# EAGLE schematic foxbms_bms-master_basic_v1.00 (EAGLE 6.5.0), part 1 of 2
AUTHOR: Fraunhofer IISB foxBMS Team; REL-DATE: 2016-05-20; TITLE: foxBMS BMS-Master Basic; VERSION: 1.00

## Sheet 1 of 22: Overview
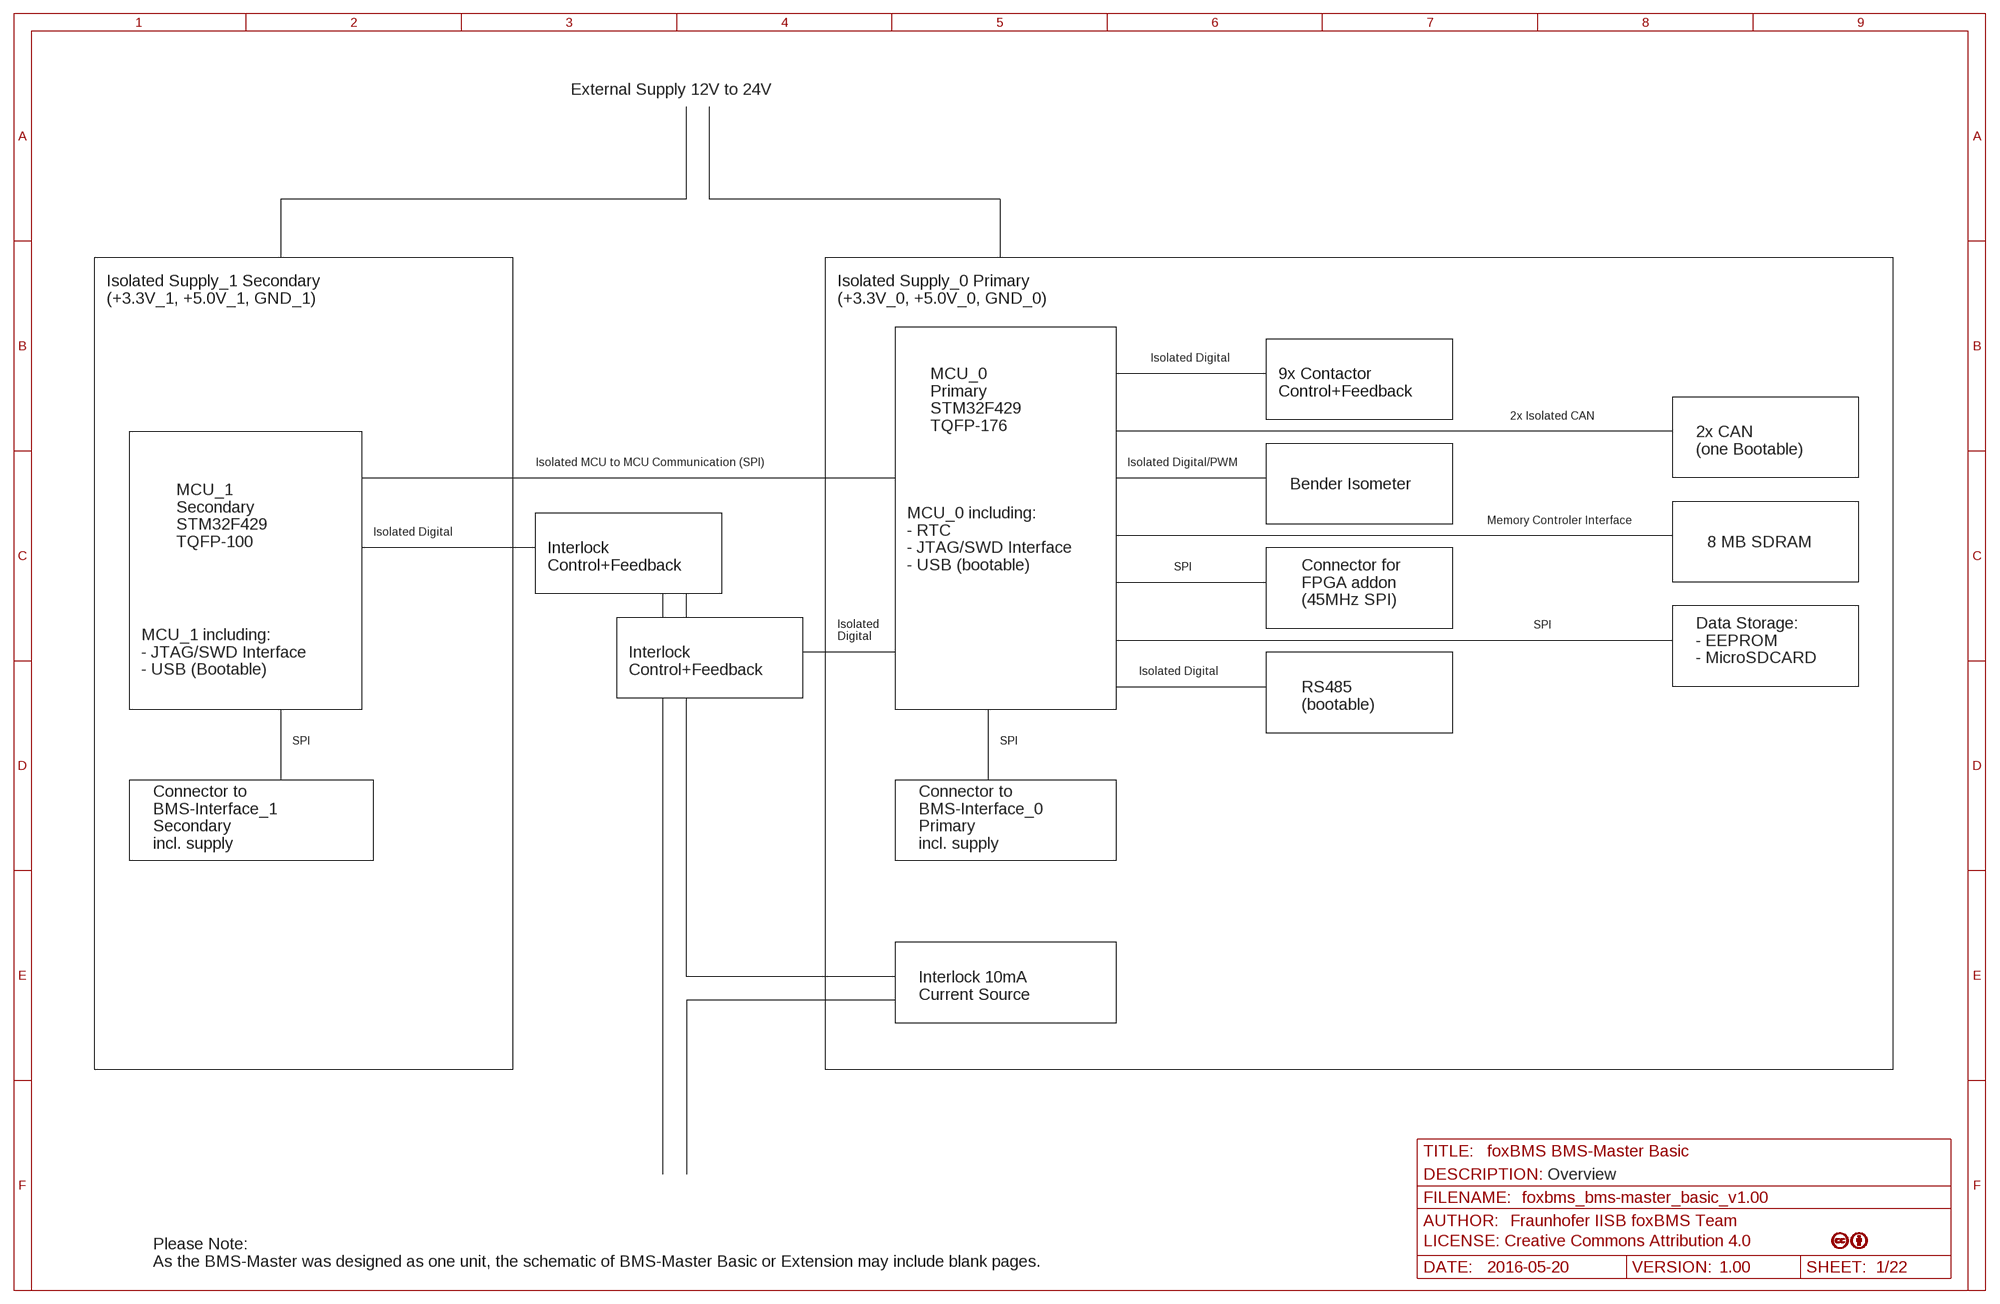
[diagram p0: schematic, sheet 1]

### Notes on the sheet
- External Supply 12V to 24V
- Isolated Supply_1 Secondary
  (+3.3V_1, +5.0V_1, GND_1)
- Isolated Supply_0 Primary
  (+3.3V_0, +5.0V_0, GND_0)
- Isolated Digital
- 9x Contactor
  Control+Feedback
- 2x Isolated CAN
- MCU_0
  Primary
  STM32F429 
  TQFP-176
- 2x CAN
  (one Bootable)
- Isolated MCU to MCU Communication (SPI) | Isolated Digital/PWM
- Bender Isometer
- Memory Controler Interface
- Isolated Digital
- MCU_1
  Secondary
  STM32F429 
  TQFP-100
- 8 MB SDRAM
- Interlock
  Control+Feedback
- MCU_0 including:
  - RTC
  - JTAG/SWD Interface
  - USB (bootable)
- SPI
- Connector for 
  FPGA addon
  (45MHz SPI)
- SPI
- Isolated 
  Digital
- Data Storage:
  - EEPROM
  - MicroSDCARD
- MCU_1 including:
  - JTAG/SWD Interface
  - USB (Bootable)
- Interlock
  Control+Feedback
- Isolated Digital
- RS485
  (bootable)
- SPI | SPI
- Connector to 
  BMS-Interface_1 
  Secondary
  incl. supply
- Connector to 
  BMS-Interface_0
  Primary
  incl. supply
- Interlock 10mA
  Current Source
- Overview
- Please Note:
  As the BMS-Master was designed as one unit, the schematic of BMS-Master Basic or Extension may include blank pages.

## Sheet 2 of 22: Supply_0 (Primary)
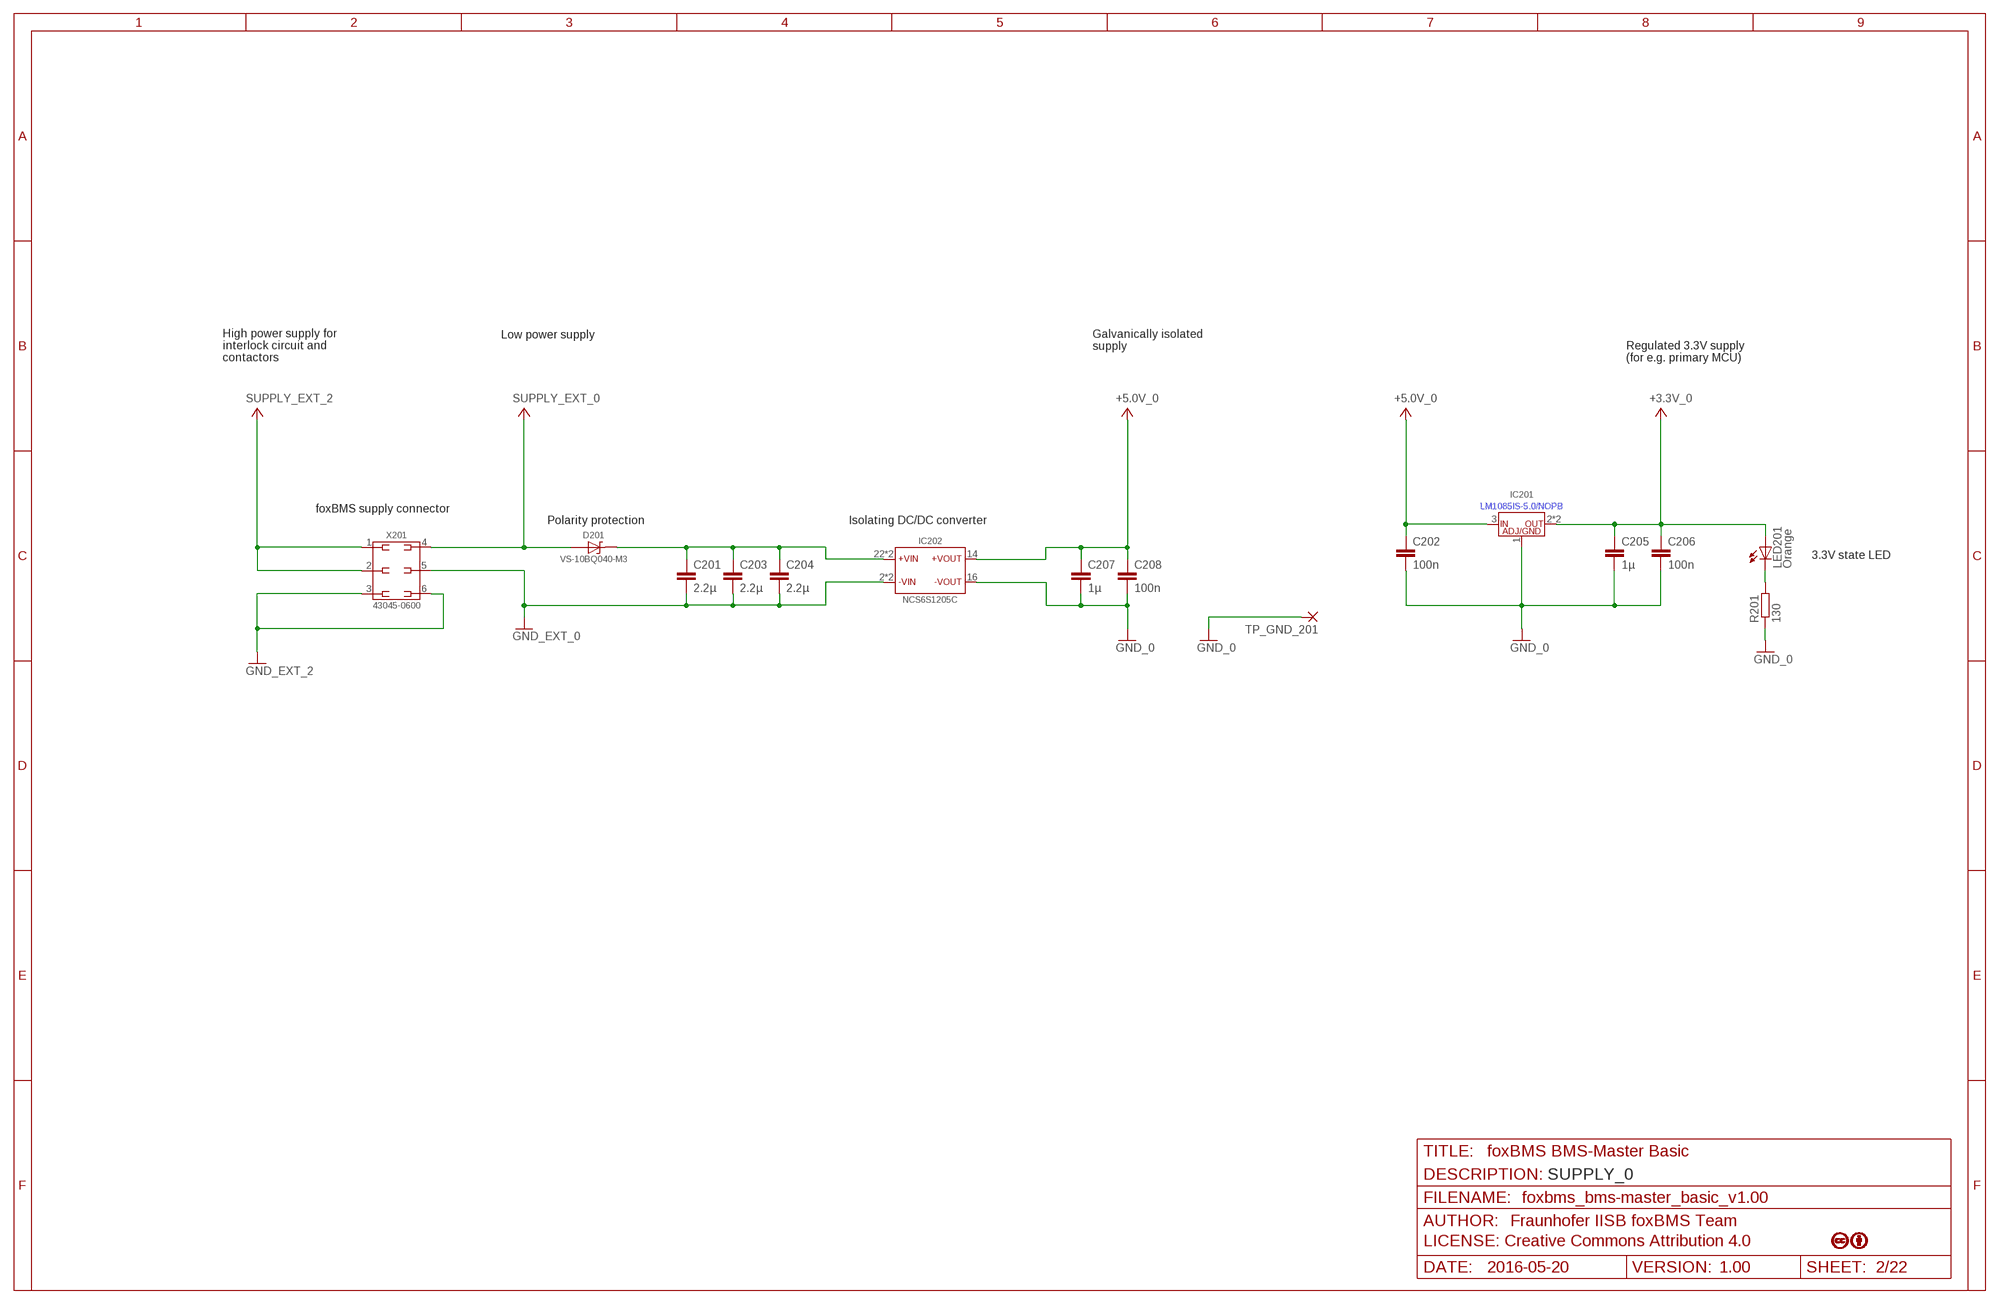
[diagram p1: schematic, sheet 2]

### Parts
C201  2.2µ  C-EUC0805  [C0805]
C202  100n  C-EUC0603  [C0603]
C203  2.2µ  C-EUC0805  [C0805]
C204  2.2µ  C-EUC0805  [C0805]
C205  1µ  C-EUC0603  [C0603]
C206  100n  C-EUC0603  [C0603]
C207  1µ  C-EUC0603  [C0603]
C208  100n  C-EUC0603  [C0603]
D201  VS-10BQ040-M3  [D_SMD_SMB_(DO-214AA)_R_VISHAY_REV01]
IC201  LM1085IS-5.0/NOPB  [IC_SMD_TO-263-3_(KTT0003B)_R_TI_REV01]
IC202  MURATA_NCS6S1205C  NCS6S1205  [IC_TH_32,00MMX20,00MMX10,00MM_(7-PIN)_R_MURATA_REV01]
LED201  Orange  LEDCHIP-LED0603  [CHIP-LED0603]
R201  130  R-EU_R0603  [R0603]
TP_GND_201  1,6/0,8  [1,6/0,8]
X201  43045-0600_MOLEX_6PIN  [X_TH_MOLEX_43045-0600_R_REV01]

### Nets
+3.3V_0: C205.1 C206.1 IC201.2(OUT) IC201.4(OUT) LED201.A ; also sheet 4,6,7,8,9,10,11,14,15,16,18,21,22
+5.0V_0: C202.1 C207.1 C208.1 IC201.3(IN) IC202.14(+VOUT) ; also sheet 16,21
GND_0: C202.2 C205.2 C206.2 C207.2 C208.2 IC201.1(ADJ/GND) IC202.16(-VOUT) R201.1 TP_GND_201.1(P) ; also sheet 4,6,7,8,9,10,11,14,15,16,18,21,22
GND_EXT_0 [Power]: C201.2 C203.2 C204.2 IC202.2(-VIN) IC202.3(-VIN) X201.5 ; also sheet 3,7,8,9,11,12
GND_EXT_2: X201.3 X201.6 ; also sheet 9
N$10: LED201.C R201.2
N$270: C201.1 C203.1 C204.1 D201.C IC202.22(+VIN) IC202.23(+VIN)
SUPPLY_EXT_0: D201.A X201.4 ; also sheet 3,7,8,9,11
SUPPLY_EXT_2: X201.1 X201.2 ; also sheet 9,10
Unconnected: IC202.11(NC)

### Notes on the sheet
- Low power supply
- Galvanically isolated
  supply
- High power supply for
  interlock circuit and
  contactors
- Regulated 3.3V supply
  (for e.g. primary MCU)
- foxBMS supply connector
- Polarity protection | Isolating DC/DC converter
- 3.3V state LED
- SUPPLY_0

## Sheet 3 of 22: Supply_1 (Secondary)
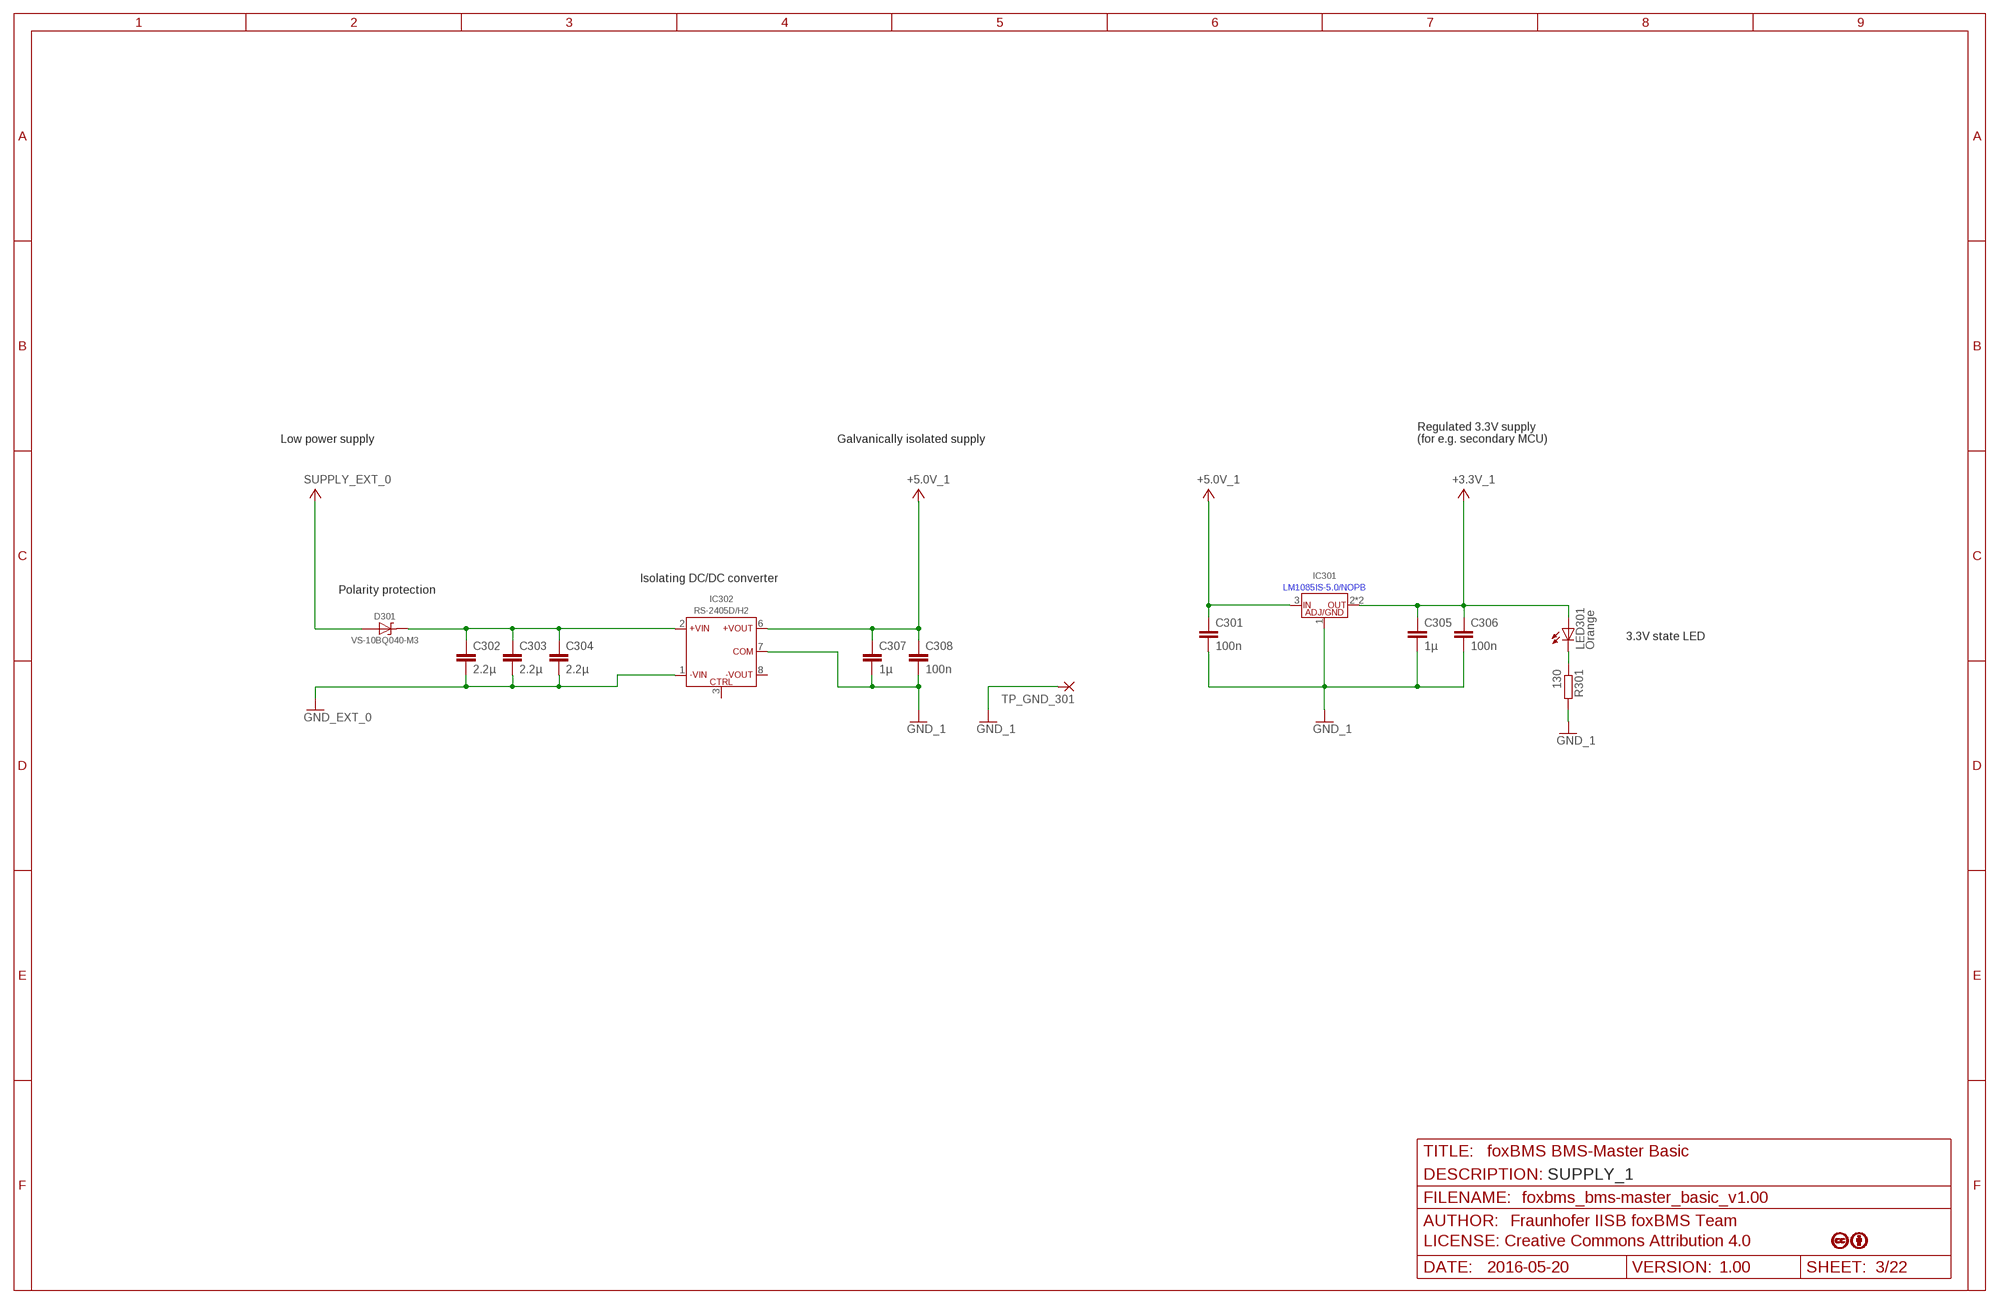
[diagram p2: schematic, sheet 3]

### Parts
C301  100n  C-EUC0603  [C0603]
C302  2.2µ  C-EUC0805  [C0805]
C303  2.2µ  C-EUC0805  [C0805]
C304  2.2µ  C-EUC0805  [C0805]
C305  1µ  C-EUC0603  [C0603]
C306  100n  C-EUC0603  [C0603]
C307  1µ  C-EUC0603  [C0603]
C308  100n  C-EUC0603  [C0603]
D301  VS-10BQ040-M3  [D_SMD_SMB_(DO-214AA)_R_VISHAY_REV01]
IC301  LM1085IS-5.0/NOPB  [IC_SMD_TO-263-3_(KTT0003B)_R_TI_REV01]
IC302  RS-2405D/H2  [IC_TH_SIP8_R_RECOM_REV01]
LED301  Orange  LEDCHIP-LED0603  [CHIP-LED0603]
R301  130  R-EU_R0603  [R0603]
TP_GND_301  1,6/0,8  [1,6/0,8]

### Nets
+3.3V_1: C305.1 C306.1 IC301.2(OUT) IC301.4(OUT) LED301.A ; also sheet 5,6,9,14,16
+5.0V_1: C301.1 C307.1 C308.1 IC301.3(IN) IC302.6(+VOUT) ; also sheet 16
GND_1: C301.2 C305.2 C306.2 C307.2 C308.2 IC301.1(ADJ/GND) IC302.7(COM) R301.2 TP_GND_301.1(P) ; also sheet 5,6,9,14,16
GND_EXT_0 [Power]: C302.2 C303.2 C304.2 IC302.1(-VIN) ; also sheet 2,7,8,9,11,12
N$9: LED301.C R301.1
N$34: C302.1 C303.1 C304.1 D301.C IC302.2(+VIN)
SUPPLY_EXT_0: D301.A ; also sheet 2,7,8,9,11
Unconnected: IC302.3(CTRL) IC302.5(NC) IC302.8(-VOUT)

### Notes on the sheet
- Low power supply | Galvanically isolated supply
- Regulated 3.3V supply
  (for e.g. secondary MCU)
- Isolating DC/DC converter
- Polarity protection
- 3.3V state LED
- SUPPLY_1

## Sheet 4 of 22: MCU_0 (Primary)
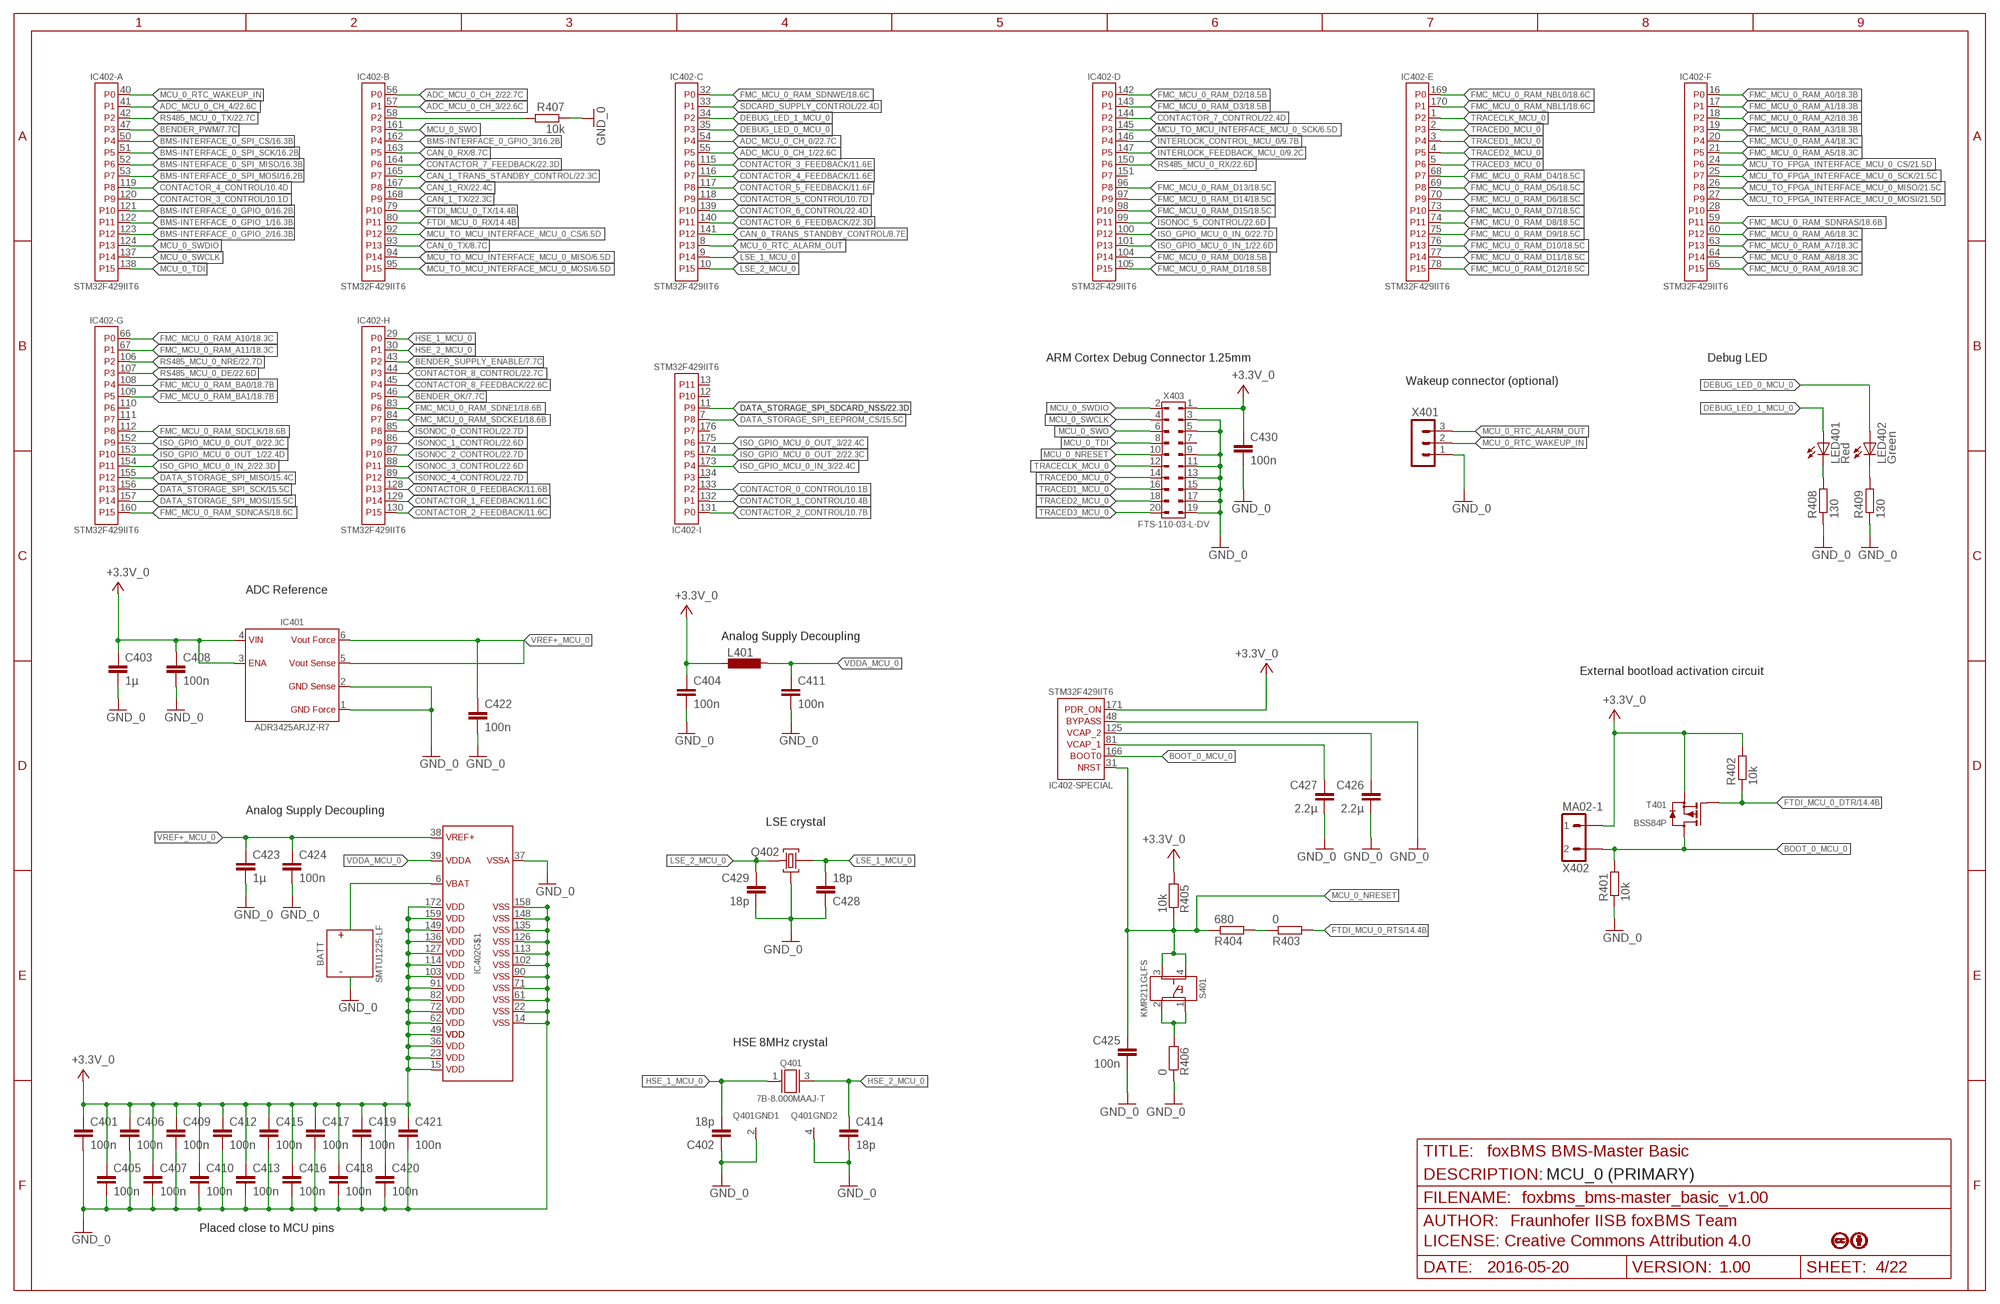
[diagram p3: schematic, sheet 4]

### Parts
BATT  SMTU1225-LF  [X_SMD_(23,70MM_X_12,70MM_X_5,00MM)_R_RENATA_REV01]
C401  100n  C-EUC0603  [C0603]
C402  18p  C-EUC0603  [C0603]
C403  1µ  C-EUC0603  [C0603]
C404  100n  C-EUC0603  [C0603]
C405  100n  C-EUC0603  [C0603]
C406  100n  C-EUC0603  [C0603]
C407  100n  C-EUC0603  [C0603]
C408  100n  C-EUC0603  [C0603]
C409  100n  C-EUC0603  [C0603]
C410  100n  C-EUC0603  [C0603]
C411  100n  C-EUC0603  [C0603]
C412  100n  C-EUC0603  [C0603]
C413  100n  C-EUC0603  [C0603]
C414  18p  C-EUC0603  [C0603]
C415  100n  C-EUC0603  [C0603]
C416  100n  C-EUC0603  [C0603]
C417  100n  C-EUC0603  [C0603]
C418  100n  C-EUC0603  [C0603]
C419  100n  C-EUC0603  [C0603]
C420  100n  C-EUC0603  [C0603]
C421  100n  C-EUC0603  [C0603]
C422  100n  C-EUC0603  [C0603]
C423  1µ  C-EUC0603  [C0603]
C424  100n  C-EUC0603  [C0603]
C425  100n  C-EUC0603  [C0603]
C426  2.2µ  C-EUC0603  [C0603]
C427  2.2µ  C-EUC0603  [C0603]
C428  18p  C-EUC0603  [C0603]
C429  18p  C-EUC0603  [C0603]
C430  100n  C-EUC0603  [C0603]
IC401  ADR3425ARJZ  [IC_SMD_SOT23-6_(MO-178-AB)_R_AD_REV01]
IC402  STM32F429IIT6  [IC_SMD_LQFP176_R_ST_REV01]
L401  L0805  [0805]
LED401  Red  LEDCHIP-LED0603  [CHIP-LED0603]
LED402  Green  LEDCHIP-LED0603  [CHIP-LED0603]
Q401  7B-8.000MAAJ-T  [G_SMD_5,00MM_X_3,20MM_0,90MM_(7B)_TXC_REV01]
Q402  MS3V  [MS3V-T1R]
R401  10k  R-EU_R0603  [R0603]
R402  10k  R-EU_R0603  [R0603]
R403  0  R-EU_R0603  [R0603]
R404  680  R-EU_R0603  [R0603]
R405  10k  R-EU_R0603  [R0603]
R406  0  R-EU_R0603  [R0603]
R407  10k  R-EU_R0603  [R0603]
R408  130  R-EU_R0603  [R0603]
R409  130  R-EU_R0603  [R0603]
S401  KMR211GLFS  [S_SMD_4,60MMX2,80MMX1,90MM_R_CK-COMPONENTS_REV01]
T401  BSS84P  [V_SMD_SOT23_(TO-236AB)_R_INFINEON_REV01]
X401  MA03-1  [MA03-1]
X402  MA02-1  [MA02-1]
X403  SAMTEC_FTS_20POL_HEADER_VERTIKAL_REV01  [X_SMD_FTS_110-03_(20POL)_R_SAMTEC_REV01]

### Nets
+3.3V_0: C401.1 C403.1 C404.1 C405.1 C406.1 C407.1 C408.1 C409.1 C410.1 C412.1 C413.1 C415.1 C416.1 C417.1 C418.1 C419.1 C420.1 C421.1 C430.1 IC401.3(ENABLE) IC401.4(VIN) IC402.15(VDD1) IC402.23(VDD2) IC402.36(VDD3) IC402.49(VDD4) IC402.62(VDD5) IC402.72(VDD6) IC402.82(VDD7) IC402.91(VDD8) IC402.103(VDD9) IC402.114(VDD10) IC402.127(VDD11) IC402.136(VDD12) IC402.149(VDD13) IC402.159(VDD14) IC402.171(-SPECIAL:PDR_ON) IC402.172(VDD15) L401.1 R402.2 R405.2 T401.2(S) X402.1 X403.1 ; also sheet 2,6,7,8,9,10,11,14,15,16,18,21,22
ADC_MCU_0_CH_0: IC402.54(-C:P4) ; also sheet 22
ADC_MCU_0_CH_1: IC402.55(-C:P5) ; also sheet 22
ADC_MCU_0_CH_2: IC402.56(-B:P0) ; also sheet 22
ADC_MCU_0_CH_3: IC402.57(-B:P1) ; also sheet 22
ADC_MCU_0_CH_4: IC402.41(-A:P1) ; also sheet 22
BENDER_OK: IC402.46(-H:P5) ; also sheet 7
BENDER_PWM: IC402.47(-A:P3) ; also sheet 7
BENDER_SUPPLY_ENABLE: IC402.43(-H:P2) ; also sheet 7
BMS-INTERFACE_0_GPIO_0: IC402.121(-A:P10) ; also sheet 16
BMS-INTERFACE_0_GPIO_1: IC402.122(-A:P11) ; also sheet 16
BMS-INTERFACE_0_GPIO_2: IC402.123(-A:P12) ; also sheet 16
BMS-INTERFACE_0_GPIO_3: IC402.162(-B:P4) ; also sheet 16
BMS-INTERFACE_0_SPI_CS: IC402.50(-A:P4) ; also sheet 16
BMS-INTERFACE_0_SPI_MISO: IC402.52(-A:P6) ; also sheet 16
BMS-INTERFACE_0_SPI_MOSI: IC402.53(-A:P7) ; also sheet 16
BMS-INTERFACE_0_SPI_SCK: IC402.51(-A:P5) ; also sheet 16
BOOT_0_MCU_0: IC402.166(-SPECIAL:BOOT0) R401.2 T401.3(D) X402.2
CAN_0_RX: IC402.163(-B:P5) ; also sheet 8
CAN_0_TRANS_STANDBY_CONTROL: IC402.141(-C:P12) ; also sheet 8
CAN_0_TX: IC402.93(-B:P13) ; also sheet 8
CAN_1_RX: IC402.167(-B:P8) ; also sheet 22
CAN_1_TRANS_STANDBY_CONTROL: IC402.165(-B:P7) ; also sheet 22
CAN_1_TX: IC402.168(-B:P9) ; also sheet 22
CONTACTOR_0_CONTROL: IC402.133(-I:P2) ; also sheet 10
CONTACTOR_0_FEEDBACK: IC402.128(-H:P13) ; also sheet 11
CONTACTOR_1_CONTROL: IC402.132(-I:P1) ; also sheet 10
CONTACTOR_1_FEEDBACK: IC402.129(-H:P14) ; also sheet 11
CONTACTOR_2_CONTROL: IC402.131(-I:P0) ; also sheet 10
CONTACTOR_2_FEEDBACK: IC402.130(-H:P15) ; also sheet 11
CONTACTOR_3_CONTROL: IC402.120(-A:P9) ; also sheet 10
CONTACTOR_3_FEEDBACK: IC402.115(-C:P6) ; also sheet 11
CONTACTOR_4_CONTROL: IC402.119(-A:P8) ; also sheet 10
CONTACTOR_4_FEEDBACK: IC402.116(-C:P7) ; also sheet 11
CONTACTOR_5_CONTROL: IC402.118(-C:P9) ; also sheet 10
CONTACTOR_5_FEEDBACK: IC402.117(-C:P8) ; also sheet 11
CONTACTOR_6_CONTROL: IC402.139(-C:P10) ; also sheet 22
CONTACTOR_6_FEEDBACK: IC402.140(-C:P11) ; also sheet 22
CONTACTOR_7_CONTROL: IC402.144(-D:P2) ; also sheet 22
CONTACTOR_7_FEEDBACK: IC402.164(-B:P6) ; also sheet 22
CONTACTOR_8_CONTROL: IC402.44(-H:P3) ; also sheet 22
CONTACTOR_8_FEEDBACK: IC402.45(-H:P4) ; also sheet 22
DATA_STORAGE_SPI_EEPROM_CS: IC402.7(-I:P8) ; also sheet 15
DATA_STORAGE_SPI_MISO [controller]: IC402.155(-G:P12) ; also sheet 15,22
DATA_STORAGE_SPI_MOSI [controller]: IC402.157(-G:P14) ; also sheet 15,22
DATA_STORAGE_SPI_SCK [controller]: IC402.156(-G:P13) ; also sheet 15,22
DATA_STORAGE_SPI_SDCARD_NSS: IC402.11(-I:P9) ; also sheet 22
DEBUG_LED_0_MCU_0: IC402.35(-C:P3) LED402.A
DEBUG_LED_1_MCU_0: IC402.34(-C:P2) LED401.A
FMC_MCU_0_RAM_A0: IC402.16(-F:P0) ; also sheet 18
FMC_MCU_0_RAM_A1: IC402.17(-F:P1) ; also sheet 18
FMC_MCU_0_RAM_A2: IC402.18(-F:P2) ; also sheet 18
FMC_MCU_0_RAM_A3: IC402.19(-F:P3) ; also sheet 18
FMC_MCU_0_RAM_A4: IC402.20(-F:P4) ; also sheet 18
FMC_MCU_0_RAM_A5: IC402.21(-F:P5) ; also sheet 18
FMC_MCU_0_RAM_A6: IC402.60(-F:P12) ; also sheet 18
FMC_MCU_0_RAM_A7: IC402.63(-F:P13) ; also sheet 18
FMC_MCU_0_RAM_A8: IC402.64(-F:P14) ; also sheet 18
FMC_MCU_0_RAM_A9: IC402.65(-F:P15) ; also sheet 18
FMC_MCU_0_RAM_A10: IC402.66(-G:P0) ; also sheet 18
FMC_MCU_0_RAM_A11: IC402.67(-G:P1) ; also sheet 18
FMC_MCU_0_RAM_BA0: IC402.108(-G:P4) ; also sheet 18
FMC_MCU_0_RAM_BA1: IC402.109(-G:P5) ; also sheet 18
FMC_MCU_0_RAM_D0: IC402.104(-D:P14) ; also sheet 18
FMC_MCU_0_RAM_D1: IC402.105(-D:P15) ; also sheet 18
FMC_MCU_0_RAM_D2: IC402.142(-D:P0) ; also sheet 18
FMC_MCU_0_RAM_D3: IC402.143(-D:P1) ; also sheet 18
FMC_MCU_0_RAM_D4: IC402.68(-E:P7) ; also sheet 18
FMC_MCU_0_RAM_D5: IC402.69(-E:P8) ; also sheet 18
FMC_MCU_0_RAM_D6: IC402.70(-E:P9) ; also sheet 18
FMC_MCU_0_RAM_D7: IC402.73(-E:P10) ; also sheet 18
FMC_MCU_0_RAM_D8: IC402.74(-E:P11) ; also sheet 18
FMC_MCU_0_RAM_D9: IC402.75(-E:P12) ; also sheet 18
FMC_MCU_0_RAM_D10: IC402.76(-E:P13) ; also sheet 18
FMC_MCU_0_RAM_D11: IC402.77(-E:P14) ; also sheet 18
FMC_MCU_0_RAM_D12: IC402.78(-E:P15) ; also sheet 18
FMC_MCU_0_RAM_D13: IC402.96(-D:P8) ; also sheet 18
FMC_MCU_0_RAM_D14: IC402.97(-D:P9) ; also sheet 18
FMC_MCU_0_RAM_D15: IC402.98(-D:P10) ; also sheet 18
FMC_MCU_0_RAM_NBL0: IC402.169(-E:P0) ; also sheet 18
FMC_MCU_0_RAM_NBL1: IC402.170(-E:P1) ; also sheet 18
FMC_MCU_0_RAM_SDCKE1: IC402.84(-H:P7) ; also sheet 18
FMC_MCU_0_RAM_SDCLK: IC402.112(-G:P8) ; also sheet 18
FMC_MCU_0_RAM_SDNCAS: IC402.160(-G:P15) ; also sheet 18
FMC_MCU_0_RAM_SDNE1: IC402.83(-H:P6) ; also sheet 18
FMC_MCU_0_RAM_SDNRAS: IC402.59(-F:P11) ; also sheet 18
FMC_MCU_0_RAM_SDNWE: IC402.32(-C:P0) ; also sheet 18
FTDI_MCU_0_DTR: R402.1 T401.1(G) ; also sheet 14
FTDI_MCU_0_RTS: R403.2 ; also sheet 14
FTDI_MCU_0_RX: IC402.80(-B:P11) ; also sheet 14
FTDI_MCU_0_TX: IC402.79(-B:P10) ; also sheet 14
GND_0: BATT.- C401.2 C402.1 C403.2 C404.2 C405.2 C406.2 C407.2 C408.2 C409.2 C410.2 C411.2 C412.2 C413.2 C414.2 C415.2 C416.2 C417.2 C418.2 C419.2 C420.2 C421.2 C422.2 C423.2 C424.2 C425.2 C426.2 C427.2 C428.1 C429.2 C430.2 IC401.1(GND_FORCE) IC401.2(GND_SENSE) IC402.14(VSS1) IC402.22(VSS2) IC402.37(VSSA) IC402.48(-SPECIAL:BYPASS_REG) IC402.61(VSS3) IC402.71(VSS4) IC402.90(VSS5) IC402.102(VSS6) IC402.113(VSS7) IC402.126(VSS8) IC402.135(VSS9) IC402.148(VSS10) IC402.158(VSS11) Q401.2(GND) Q401.4(GND) Q402.P$3 R401.1 R406.1 R407.1 R408.1 R409.1 X401.1 X403.3 X403.5 X403.9 X403.11 X403.13 X403.15 X403.17 X403.19 ; also sheet 2,6,7,8,9,10,11,14,15,16,18,21,22
HSE_1_MCU_0: C402.2 IC402.29(-H:P0) Q401.1(A)
HSE_2_MCU_0: C414.1 IC402.30(-H:P1) Q401.3(B)
INTERLOCK_CONTROL_MCU_0: IC402.146(-D:P4) ; also sheet 9
INTERLOCK_FEEDBACK_MCU_0: IC402.147(-D:P5) ; also sheet 9
ISO_GPIO_MCU_0_IN_0: IC402.100(-D:P12) ; also sheet 22
ISO_GPIO_MCU_0_IN_1: IC402.101(-D:P13) ; also sheet 22
ISO_GPIO_MCU_0_IN_2: IC402.154(-G:P11) ; also sheet 22
ISO_GPIO_MCU_0_IN_3: IC402.173(-I:P4) ; also sheet 22
ISO_GPIO_MCU_0_OUT_0: IC402.152(-G:P9) ; also sheet 22
ISO_GPIO_MCU_0_OUT_1: IC402.153(-G:P10) ; also sheet 22
ISO_GPIO_MCU_0_OUT_2: IC402.174(-I:P5) ; also sheet 22
ISO_GPIO_MCU_0_OUT_3: IC402.175(-I:P6) ; also sheet 22
ISONOC_0_CONTROL: IC402.85(-H:P8) ; also sheet 22
ISONOC_1_CONTROL: IC402.86(-H:P9) ; also sheet 22
ISONOC_2_CONTROL: IC402.87(-H:P10) ; also sheet 22
ISONOC_3_CONTROL: IC402.88(-H:P11) ; also sheet 22
ISONOC_4_CONTROL: IC402.89(-H:P12) ; also sheet 22
ISONOC_5_CONTROL: IC402.99(-D:P11) ; also sheet 22
LSE_1_MCU_0: C428.2 IC402.9(-C:P14) Q402.1
LSE_2_MCU_0: C429.1 IC402.10(-C:P15) Q402.2
MCU_0_NRESET: C425.1 IC402.31(-SPECIAL:NRST) R404.1 R405.1 S401.3 S401.4 X403.10
MCU_0_RTC_ALARM_OUT: IC402.8(-C:P13) X401.3
MCU_0_RTC_WAKEUP_IN: IC402.40(-A:P0) X401.2
MCU_0_SWCLK: IC402.137(-A:P14) X403.4
MCU_0_SWDIO: IC402.124(-A:P13) X403.2
MCU_0_SWO: IC402.161(-B:P3) X403.6
MCU_0_TDI: IC402.138(-A:P15) X403.8
MCU_TO_FPGA_INTERFACE_MCU_0_CS: IC402.24(-F:P6) ; also sheet 21
MCU_TO_FPGA_INTERFACE_MCU_0_MISO: IC402.26(-F:P8) ; also sheet 21
MCU_TO_FPGA_INTERFACE_MCU_0_MOSI: IC402.27(-F:P9) ; also sheet 21
MCU_TO_FPGA_INTERFACE_MCU_0_SCK: IC402.25(-F:P7) ; also sheet 21
MCU_TO_MCU_INTERFACE_MCU_0_CS: IC402.92(-B:P12) ; also sheet 6
MCU_TO_MCU_INTERFACE_MCU_0_MISO: IC402.94(-B:P14) ; also sheet 6
MCU_TO_MCU_INTERFACE_MCU_0_MOSI: IC402.95(-B:P15) ; also sheet 6
MCU_TO_MCU_INTERFACE_MCU_0_SCK: IC402.145(-D:P3) ; also sheet 6
N$14: C426.1 IC402.125(-SPECIAL:VCAP_2)
N$21: R406.2 S401.1 S401.2
N$23: LED401.C R408.2
N$24: LED402.C R409.2
N$30: C427.1 IC402.81(-SPECIAL:VCAP_1)
N$58: IC402.58(-B:P2) R407.2
N$83: R403.1 R404.2
N$84: BATT.+ IC402.6(VBAT)
RS485_MCU_0_DE: IC402.107(-G:P3) ; also sheet 22
RS485_MCU_0_NRE: IC402.106(-G:P2) ; also sheet 22
RS485_MCU_0_RX: IC402.150(-D:P6) ; also sheet 22
RS485_MCU_0_TX: IC402.42(-A:P2) ; also sheet 22
SDCARD_SUPPLY_CONTROL: IC402.33(-C:P1) ; also sheet 22
TRACECLK_MCU_0: IC402.1(-E:P2) X403.12
TRACED0_MCU_0: IC402.2(-E:P3) X403.14
TRACED1_MCU_0: IC402.3(-E:P4) X403.16
TRACED2_MCU_0: IC402.4(-E:P5) X403.18
TRACED3_MCU_0: IC402.5(-E:P6) X403.20
VDDA_MCU_0: C411.1 IC402.39(VDDA) L401.2
VREF+_MCU_0: C422.1 C423.1 C424.1 IC401.5(VOUT_SENSE) IC401.6(VOUT_FORCE) IC402.38(VREF+)
Unconnected: IC402.12(-I:P10) IC402.13(-I:P11) IC402.28(-F:P10) IC402.110(-G:P6) IC402.111(-G:P7) IC402.134(-I:P3) IC402.151(-D:P7) IC402.176(-I:P7) S401.5 X403.7

### Notes on the sheet
- ARM Cortex Debug Connector 1.25mm | Debug LED
- Wakeup connector (optional)
- ADC Reference
- Analog Supply Decoupling
- External bootload activation circuit
- Analog Supply Decoupling
- LSE crystal
- HSE 8MHz crystal
- MCU_0 (PRIMARY)
- Placed close to MCU pins

## Sheet 5 of 22: MCU_1 (Secondary)
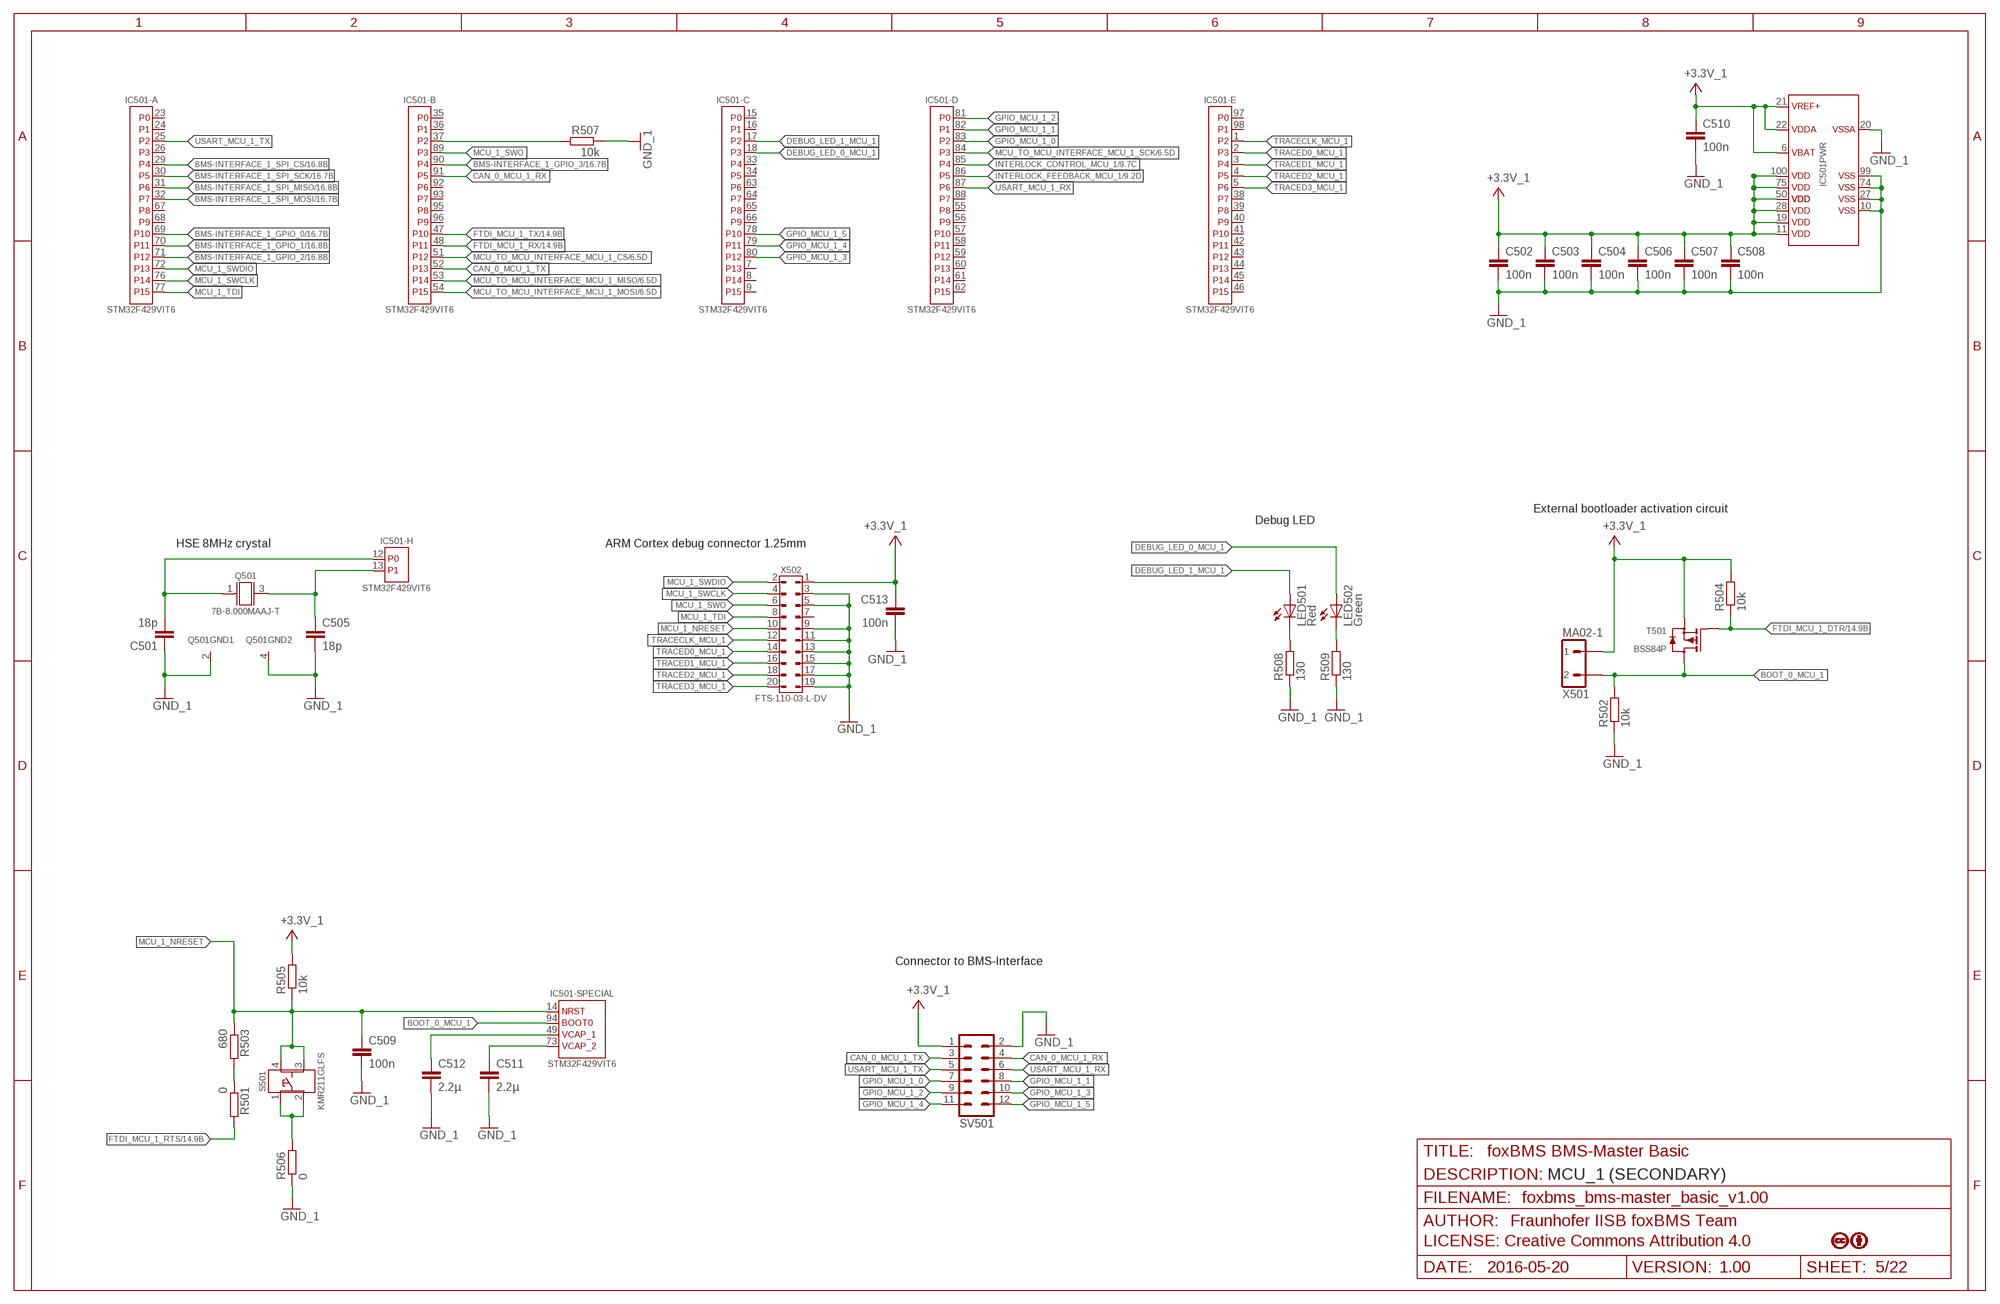
[diagram p4: schematic, sheet 5]

### Parts
C501  18p  C-EUC0603  [C0603]
C502  100n  C-EUC0603  [C0603]
C503  100n  C-EUC0603  [C0603]
C504  100n  C-EUC0603  [C0603]
C505  18p  C-EUC0603  [C0603]
C506  100n  C-EUC0603  [C0603]
C507  100n  C-EUC0603  [C0603]
C508  100n  C-EUC0603  [C0603]
C509  100n  C-EUC0603  [C0603]
C510  100n  C-EUC0603  [C0603]
C511  2.2µ  C-EUC0603  [C0603]
C512  2.2µ  C-EUC0603  [C0603]
C513  100n  C-EUC0603  [C0603]
IC501  STM32F429VIT6  [IC_SMD_LQFP100_R_ST_REV01]
LED501  Red  LEDCHIP-LED0603  [CHIP-LED0603]
LED502  Green  LEDCHIP-LED0603  [CHIP-LED0603]
Q501  7B-8.000MAAJ-T  [G_SMD_5,00MM_X_3,20MM_0,90MM_(7B)_TXC_REV01]
R501  0  R-EU_R0603  [R0603]
R502  10k  R-EU_R0603  [R0603]
R503  680  R-EU_R0603  [R0603]
R504  10k  R-EU_R0603  [R0603]
R505  10k  R-EU_R0603  [R0603]
R506  0  R-EU_R0603  [R0603]
R507  10k  R-EU_R0603  [R0603]
R508  130  R-EU_R0603  [R0603]
R509  130  R-EU_R0603  [R0603]
S501  KMR211GLFS  [S_SMD_4,60MMX2,80MMX1,90MM_R_CK-COMPONENTS_REV01]
SV501  MA06-2  [MA06-2]
T501  BSS84P  [V_SMD_SOT23_(TO-236AB)_R_INFINEON_REV01]
X501  MA02-1  [MA02-1]
X502  SAMTEC_FTS_20POL_HEADER_VERTIKAL_REV01  [X_SMD_FTS_110-03_(20POL)_R_SAMTEC_REV01]

### Nets
+3.3V_1: C502.1 C503.1 C504.1 C506.1 C507.1 C508.1 C510.1 C513.1 IC501.6(PWR:VBAT) IC501.11(PWR:VDD1) IC501.19(PWR:VDD2) IC501.21(PWR:VREF+) IC501.22(PWR:VDDA) IC501.28(PWR:VDD3) IC501.50(PWR:VDD4) IC501.75(PWR:VDD5) IC501.100(PWR:VDD6) R504.2 R505.2 SV501.1 T501.2(S) X501.1 X502.1 ; also sheet 3,6,9,14,16
BMS-INTERFACE_1_GPIO_0: IC501.69(-A:P10) ; also sheet 16
BMS-INTERFACE_1_GPIO_1: IC501.70(-A:P11) ; also sheet 16
BMS-INTERFACE_1_GPIO_2: IC501.71(-A:P12) ; also sheet 16
BMS-INTERFACE_1_GPIO_3: IC501.90(-B:P4) ; also sheet 16
BMS-INTERFACE_1_SPI_CS: IC501.29(-A:P4) ; also sheet 16
BMS-INTERFACE_1_SPI_MISO: IC501.31(-A:P6) ; also sheet 16
BMS-INTERFACE_1_SPI_MOSI: IC501.32(-A:P7) ; also sheet 16
BMS-INTERFACE_1_SPI_SCK: IC501.30(-A:P5) ; also sheet 16
BOOT_0_MCU_1: IC501.94(-SPECIAL:BOOT0) R502.2 T501.3(D) X501.2
CAN_0_MCU_1_RX: IC501.91(-B:P5) SV501.4
CAN_0_MCU_1_TX: IC501.52(-B:P13) SV501.3
DEBUG_LED_0_MCU_1: IC501.18(-C:P3) LED502.A
DEBUG_LED_1_MCU_1: IC501.17(-C:P2) LED501.A
FTDI_MCU_1_DTR: R504.1 T501.1(G) ; also sheet 14
FTDI_MCU_1_RTS: R501.2 ; also sheet 14
FTDI_MCU_1_RX: IC501.48(-B:P11) ; also sheet 14
FTDI_MCU_1_TX: IC501.47(-B:P10) ; also sheet 14
GND_1: C501.1 C502.2 C503.2 C504.2 C505.2 C506.2 C507.2 C508.2 C509.2 C510.2 C511.2 C512.2 C513.2 IC501.10(PWR:VSS1) IC501.20(PWR:VSSA) IC501.27(PWR:VSS2) IC501.74(PWR:VSS3) IC501.99(PWR:VSS4) Q501.2(GND) Q501.4(GND) R502.1 R506.1 R507.1 R508.1 R509.1 SV501.2 X502.3 X502.5 X502.9 X502.11 X502.13 X502.15 X502.17 X502.19 ; also sheet 3,6,9,14,16
GPIO_MCU_1_0: IC501.83(-D:P2) SV501.7
GPIO_MCU_1_1: IC501.82(-D:P1) SV501.8
GPIO_MCU_1_2: IC501.81(-D:P0) SV501.9
GPIO_MCU_1_3: IC501.80(-C:P12) SV501.10
GPIO_MCU_1_4: IC501.79(-C:P11) SV501.11
GPIO_MCU_1_5: IC501.78(-C:P10) SV501.12
INTERLOCK_CONTROL_MCU_1: IC501.85(-D:P4) ; also sheet 9
INTERLOCK_FEEDBACK_MCU_1: IC501.86(-D:P5) ; also sheet 9
MCU_1_NRESET: C509.1 IC501.14(-SPECIAL:NRST) R503.1 R505.1 S501.3 S501.4 X502.10
MCU_1_SWCLK: IC501.76(-A:P14) X502.4
MCU_1_SWDIO: IC501.72(-A:P13) X502.2
MCU_1_SWO: IC501.89(-B:P3) X502.6
MCU_1_TDI: IC501.77(-A:P15) X502.8
MCU_TO_MCU_INTERFACE_MCU_1_CS: IC501.51(-B:P12) ; also sheet 6
MCU_TO_MCU_INTERFACE_MCU_1_MISO: IC501.53(-B:P14) ; also sheet 6
MCU_TO_MCU_INTERFACE_MCU_1_MOSI: IC501.54(-B:P15) ; also sheet 6
MCU_TO_MCU_INTERFACE_MCU_1_SCK: IC501.84(-D:P3) ; also sheet 6
N$18: C501.2 IC501.12(-H:P0) Q501.1(A)
N$19: C505.1 IC501.13(-H:P1) Q501.3(B)
N$20: R506.2 S501.1 S501.2
N$25: LED502.C R509.2
N$26: LED501.C R508.2
N$31: C511.1 IC501.73(-SPECIAL:VCAP_2)
N$38: C512.1 IC501.49(-SPECIAL:VCAP_1)
N$59: IC501.37(-B:P2) R507.2
N$74: R501.1 R503.2
TRACECLK_MCU_1: IC501.1(-E:P2) X502.12
TRACED0_MCU_1: IC501.2(-E:P3) X502.14
TRACED1_MCU_1: IC501.3(-E:P4) X502.16
TRACED2_MCU_1: IC501.4(-E:P5) X502.18
TRACED3_MCU_1: IC501.5(-E:P6) X502.20
USART_MCU_1_RX: IC501.87(-D:P6) SV501.6
USART_MCU_1_TX: IC501.25(-A:P2) SV501.5
Unconnected: IC501.7(-C:P13) IC501.8(-C:P14) IC501.9(-C:P15) IC501.15(-C:P0) IC501.16(-C:P1) IC501.23(-A:P0) IC501.24(-A:P1) IC501.26(-A:P3) IC501.33(-C:P4) IC501.34(-C:P5) IC501.35(-B:P0) IC501.36(-B:P1) IC501.38(-E:P7) IC501.39(-E:P8) IC501.40(-E:P9) IC501.41(-E:P10) IC501.42(-E:P11) IC501.43(-E:P12) IC501.44(-E:P13) IC501.45(-E:P14) IC501.46(-E:P15) IC501.55(-D:P8) IC501.56(-D:P9) IC501.57(-D:P10) IC501.58(-D:P11) IC501.59(-D:P12) IC501.60(-D:P13) IC501.61(-D:P14) IC501.62(-D:P15) IC501.63(-C:P6) IC501.64(-C:P7) IC501.65(-C:P8) IC501.66(-C:P9) IC501.67(-A:P8) IC501.68(-A:P9) IC501.88(-D:P7) IC501.92(-B:P6) IC501.93(-B:P7) IC501.95(-B:P8) IC501.96(-B:P9) IC501.97(-E:P0) IC501.98(-E:P1) S501.5 X502.7

### Notes on the sheet
- External bootloader activation circuit
- Debug LED
- HSE 8MHz crystal | ARM Cortex debug connector 1.25mm
- Connector to BMS-Interface
- MCU_1 (SECONDARY)

## Sheet 6 of 22: MCU to MCU Interface
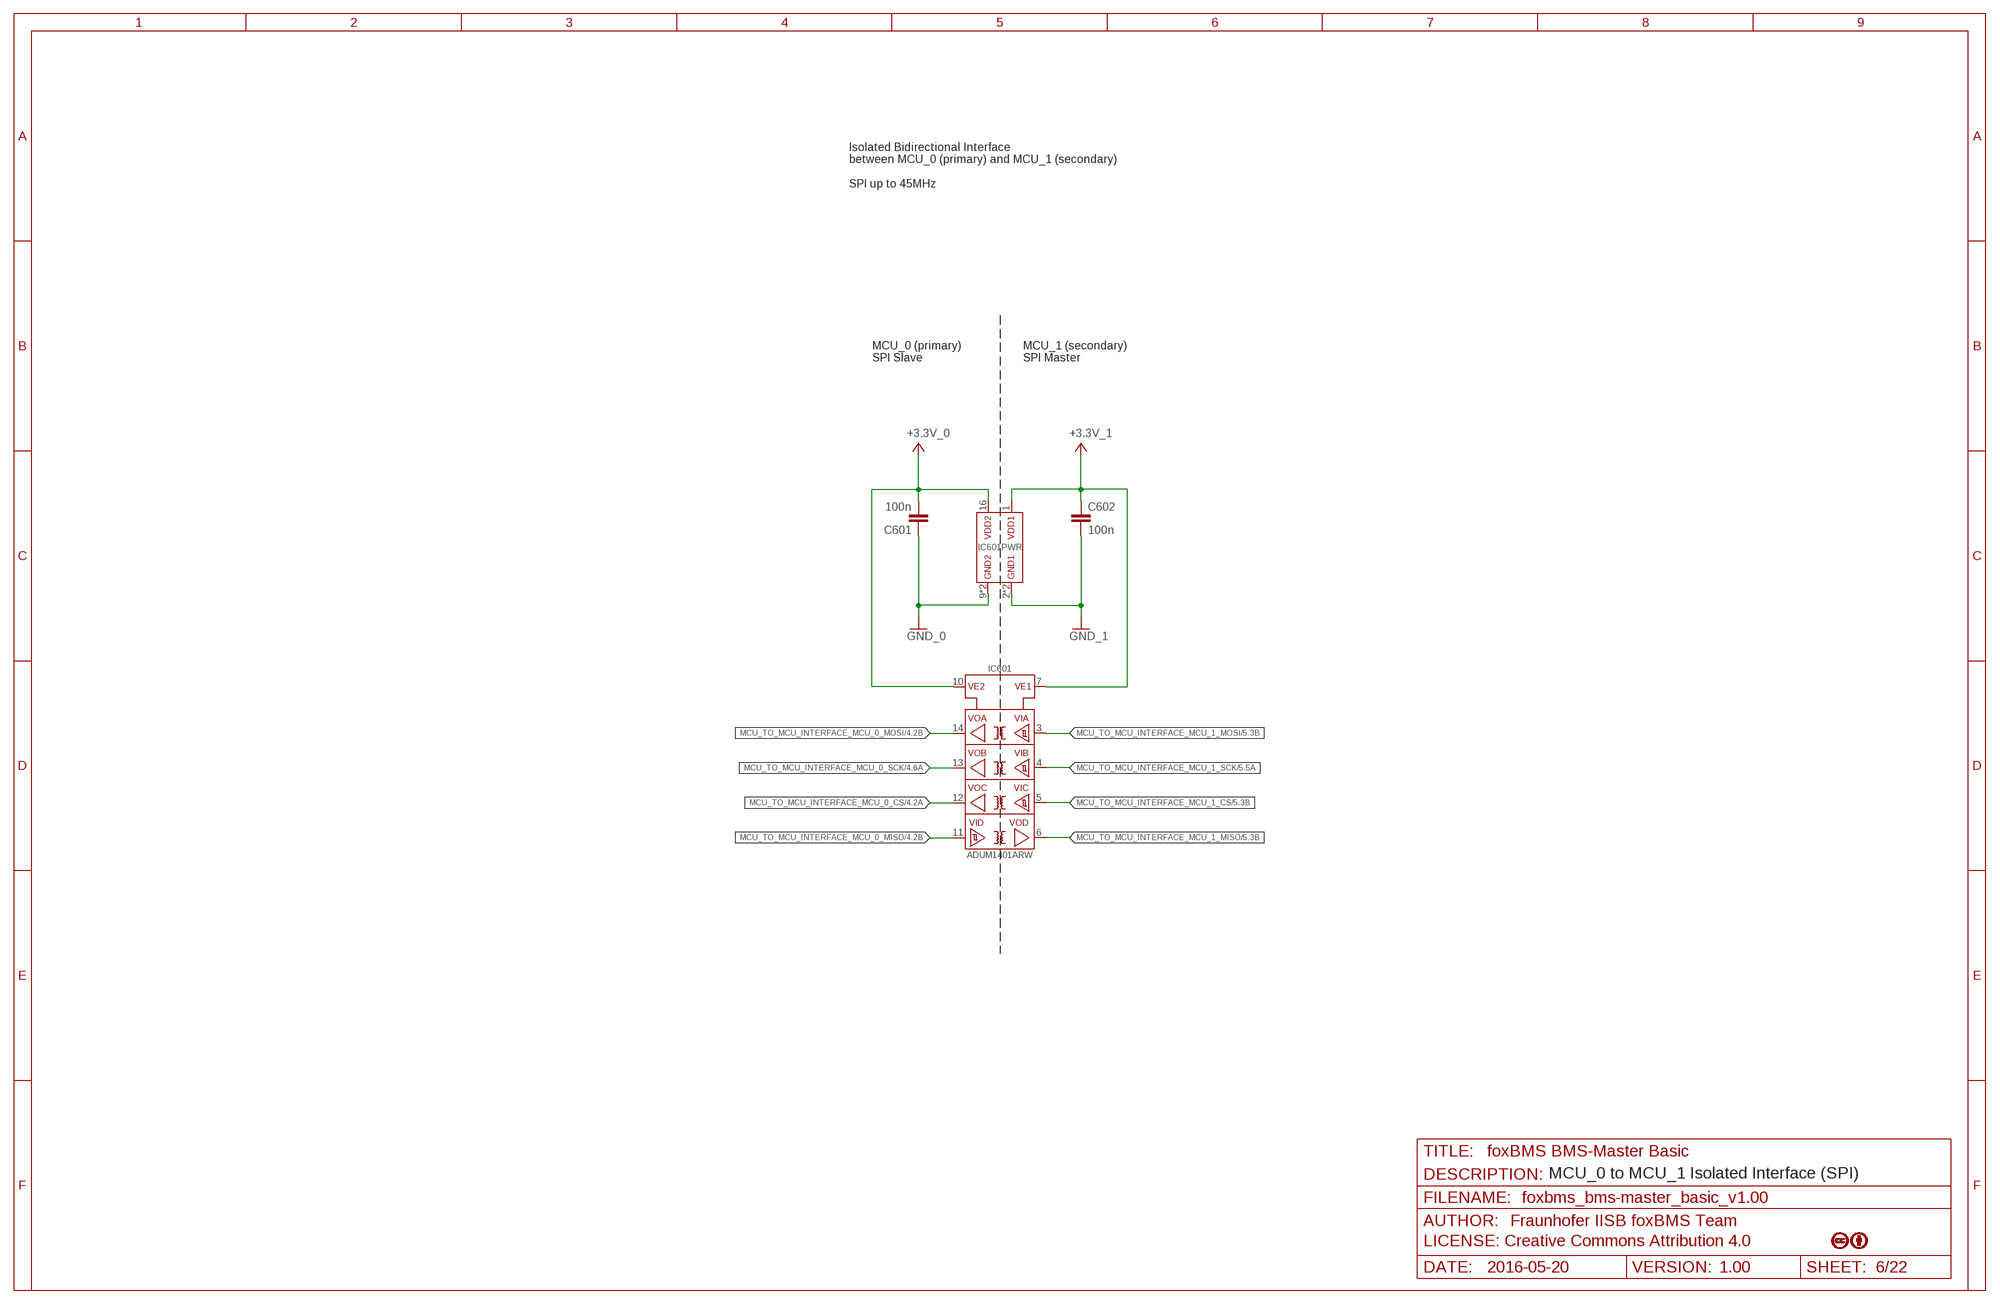
[diagram p5: schematic, sheet 6]

### Parts
C601  100n  C-EUC0603  [C0603]
C602  100n  C-EUC0603  [C0603]
IC601  ADUM1401ARW  [IC_SMD_SOIC-16_(JEDEC_MS-013-AA)_R_ANALOG_REV01]

### Nets
+3.3V_0: C601.2 IC601.10(VE2) IC601.16(VDD2) ; also sheet 2,4,7,8,9,10,11,14,15,16,18,21,22
+3.3V_1: C602.1 IC601.1(VDD1) IC601.7(VE1) ; also sheet 3,5,9,14,16
GND_0: C601.1 IC601.9(GND2) IC601.15(GND2) ; also sheet 2,4,7,8,9,10,11,14,15,16,18,21,22
GND_1: C602.2 IC601.2(GND1) IC601.8(GND1) ; also sheet 3,5,9,14,16
MCU_TO_MCU_INTERFACE_MCU_0_CS: IC601.12(VOC) ; also sheet 4
MCU_TO_MCU_INTERFACE_MCU_0_MISO: IC601.11(VID) ; also sheet 4
MCU_TO_MCU_INTERFACE_MCU_0_MOSI: IC601.14(VOA) ; also sheet 4
MCU_TO_MCU_INTERFACE_MCU_0_SCK: IC601.13(VOB) ; also sheet 4
MCU_TO_MCU_INTERFACE_MCU_1_CS: IC601.5(VIC) ; also sheet 5
MCU_TO_MCU_INTERFACE_MCU_1_MISO: IC601.6(VOD) ; also sheet 5
MCU_TO_MCU_INTERFACE_MCU_1_MOSI: IC601.3(VIA) ; also sheet 5
MCU_TO_MCU_INTERFACE_MCU_1_SCK: IC601.4(VIB) ; also sheet 5

### Notes on the sheet
- Isolated Bidirectional Interface 
  between MCU_0 (primary) and MCU_1 (secondary)
  
  SPI up to 45MHz
- MCU_0 (primary)
  SPI Slave
- MCU_1 (secondary)
  SPI Master
- MCU_0 to MCU_1 Isolated Interface (SPI)

## Sheet 7 of 22: Bender Interface
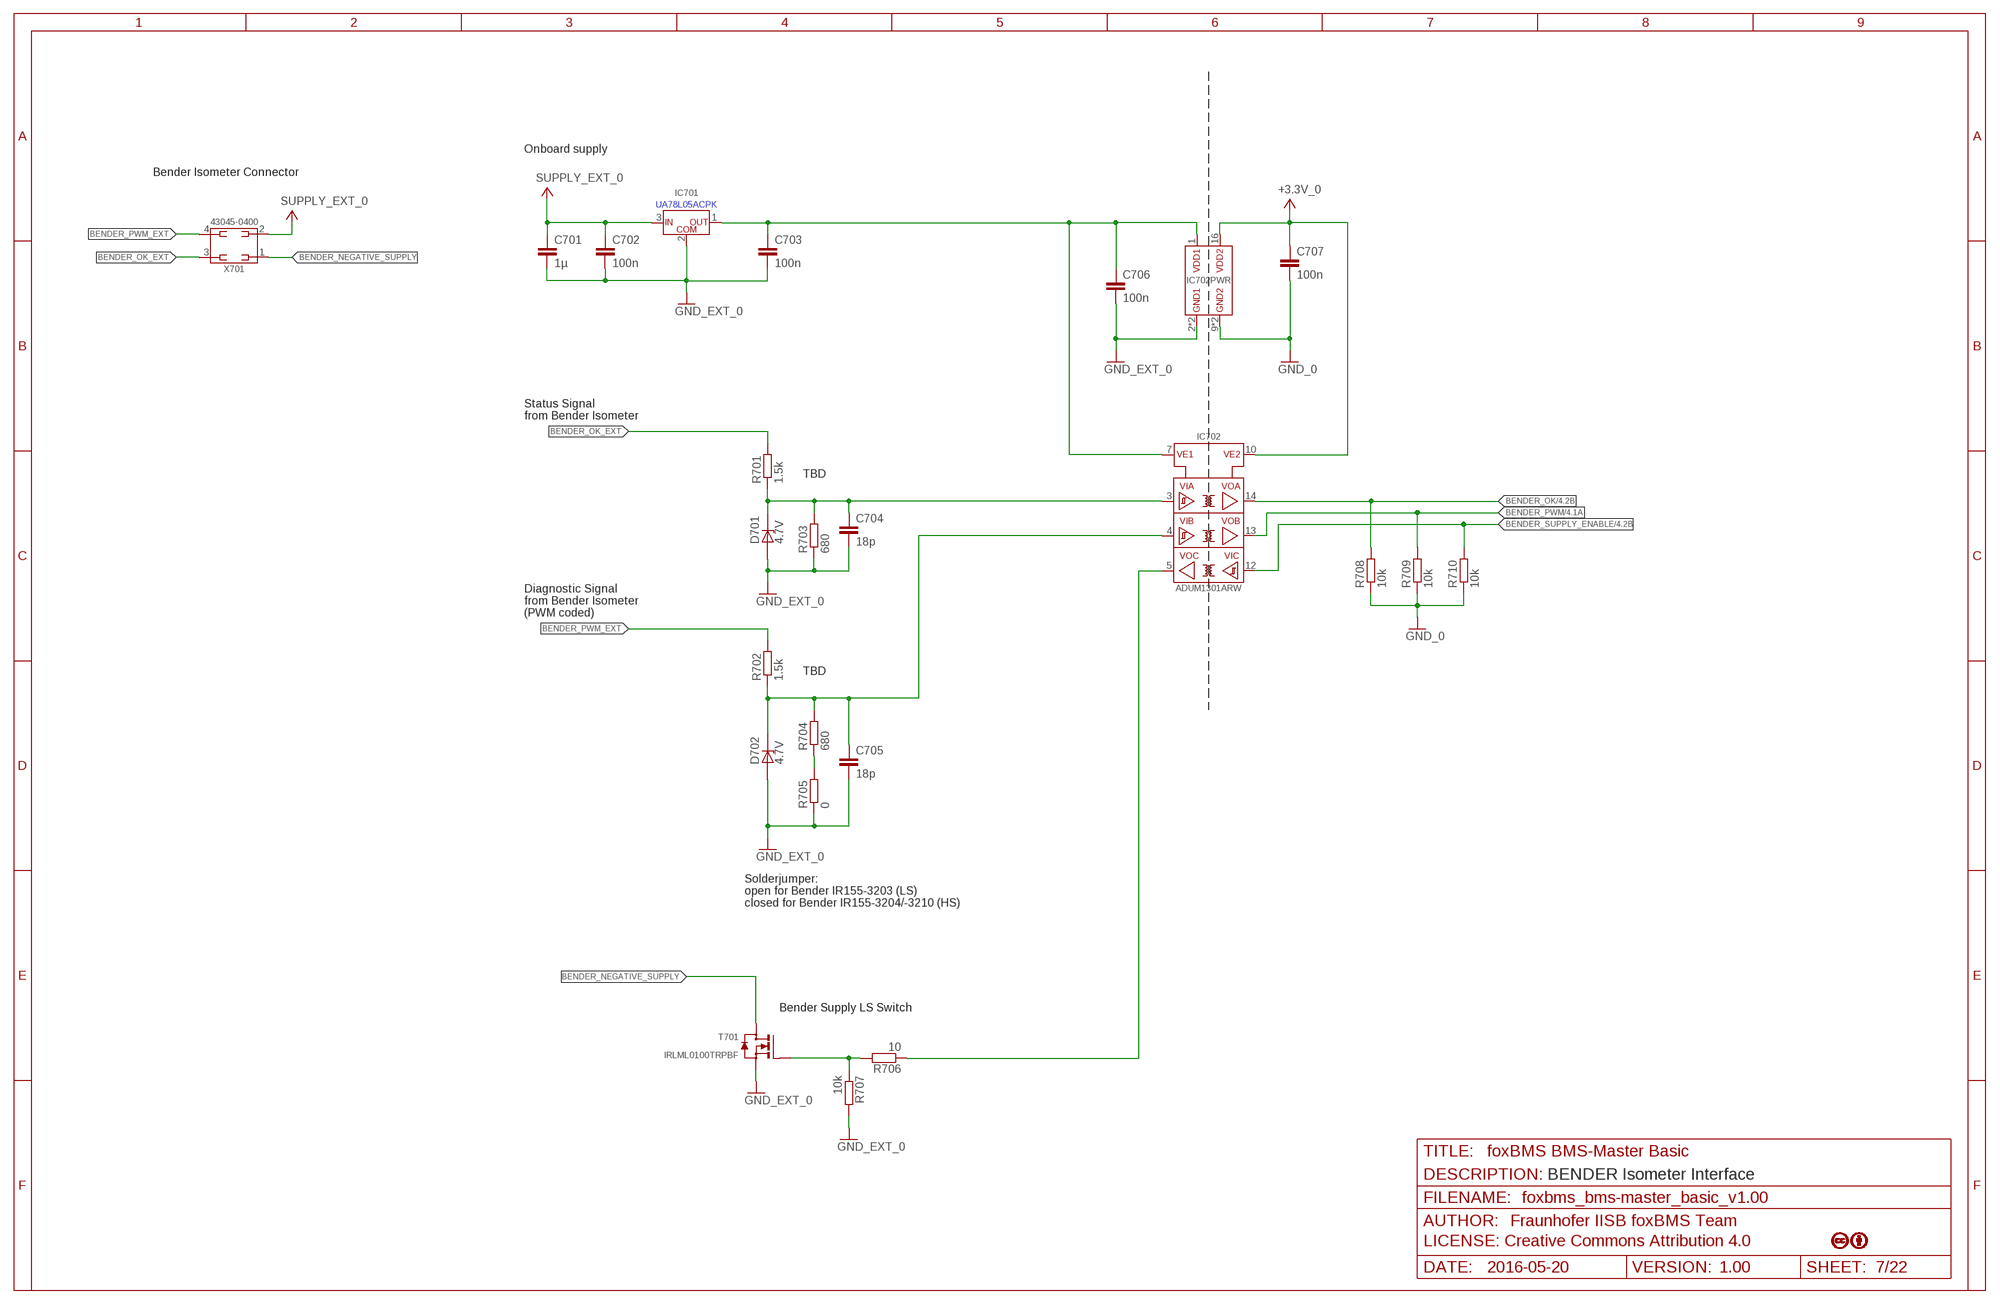
[diagram p6: schematic, sheet 7]

### Parts
C701  1µ  C-EUC0603  [C0603]
C702  100n  C-EUC0603  [C0603]
C703  100n  C-EUC0603  [C0603]
C704  18p  C-EUC0603  [C0603]
C705  18p  C-EUC0603  [C0603]
C706  100n  C-EUC0603  [C0603]
C707  100n  C-EUC0603  [C0603]
D701  4.7V  MM3Z_XVX_T1  [SOD323]
D702  4.7V  MM3Z_XVX_T1  [SOD323]
IC701  UA78L05ACPK  [IC_SMD_SOT-89_(SC-62/TO-243)_(R-PSSO-F3)_R_TI_REV01]
IC702  ADUM1301ARW  [IC_SMD_SOIC-16_(JEDEC_MS-013-AA)_R_ANALOG_REV01]
R701  1.5k  R-EU_R0603  [R0603]
R702  1.5k  R-EU_R0603  [R0603]
R703  680  R-EU_R0603  [R0603]
R704  680  R-EU_R0603  [R0603]
R705  0  R-EU_R0603  [R0603]
R706  10  R-EU_R0603  [R0603]
R707  10k  R-EU_R0603  [R0603]
R708  10k  R-EU_R0603  [R0603]
R709  10k  R-EU_R0603  [R0603]
R710  10k  R-EU_R0603  [R0603]
T701  IRLML0100TRPBF  [V_SMD_SOT-23_(TO-236AB)_R_IR_REV01]
X701  43045-0400_MOLEX_4PIN  [X_TH_MOLEX_43045-0400_R_REV01]

### Nets
+3.3V_0: C707.1 IC702.10(VE2) IC702.16(VDD2) ; also sheet 2,4,6,8,9,10,11,14,15,16,18,21,22
BENDER_ADUM_SUPPLY: C703.1 C706.1 IC701.1(OUT) IC702.1(VDD1) IC702.7(VE1)
BENDER_NEGATIVE_SUPPLY: T701.3(D) X701.1
BENDER_OK: IC702.14(VOA) R708.2 ; also sheet 4
BENDER_OK_EXT: R701.2 X701.3
BENDER_PWM: IC702.13(VOB) R709.2 ; also sheet 4
BENDER_PWM_EXT: R702.2 X701.4
BENDER_SUPPLY_ENABLE: IC702.12(VIC) R710.2 ; also sheet 4
GND_0: C707.2 IC702.9(GND2) IC702.15(GND2) R708.1 R709.1 R710.1 ; also sheet 2,4,6,8,9,10,11,14,15,16,18,21,22
GND_EXT_0 [Power]: C701.2 C702.2 C703.2 C704.2 C705.2 C706.2 D701.A D702.A IC701.2(COM) IC702.2(GND1) IC702.8(GND1) R703.1 R705.1 R707.2 T701.2(S) ; also sheet 2,3,8,9,11,12
N$267: IC702.5(VOC) R706.1
N$269: R706.2 R707.1 T701.1(G)
N$271: C705.1 D702.C(K) IC702.4(VIB) R702.1 R704.2
N$272: C704.1 D701.C(K) IC702.3(VIA) R701.1 R703.2
N$273: R704.1 R705.2
SUPPLY_EXT_0: C701.1 C702.1 IC701.3(IN) X701.2 ; also sheet 2,3,8,9,11
Unconnected: IC702.6(NC$1) IC702.11(NC$1)

### Notes on the sheet
- Onboard supply
- Bender Isometer Connector
- Status Signal 
  from Bender Isometer
- TBD
- Diagnostic Signal
  from Bender Isometer
  (PWM coded)
- TBD
- Solderjumper:
  open for Bender IR155-3203 (LS)
  closed for Bender IR155-3204/-3210 (HS)
- Bender Supply LS Switch
- BENDER Isometer Interface

## Sheet 8 of 22: CAN Interfaces
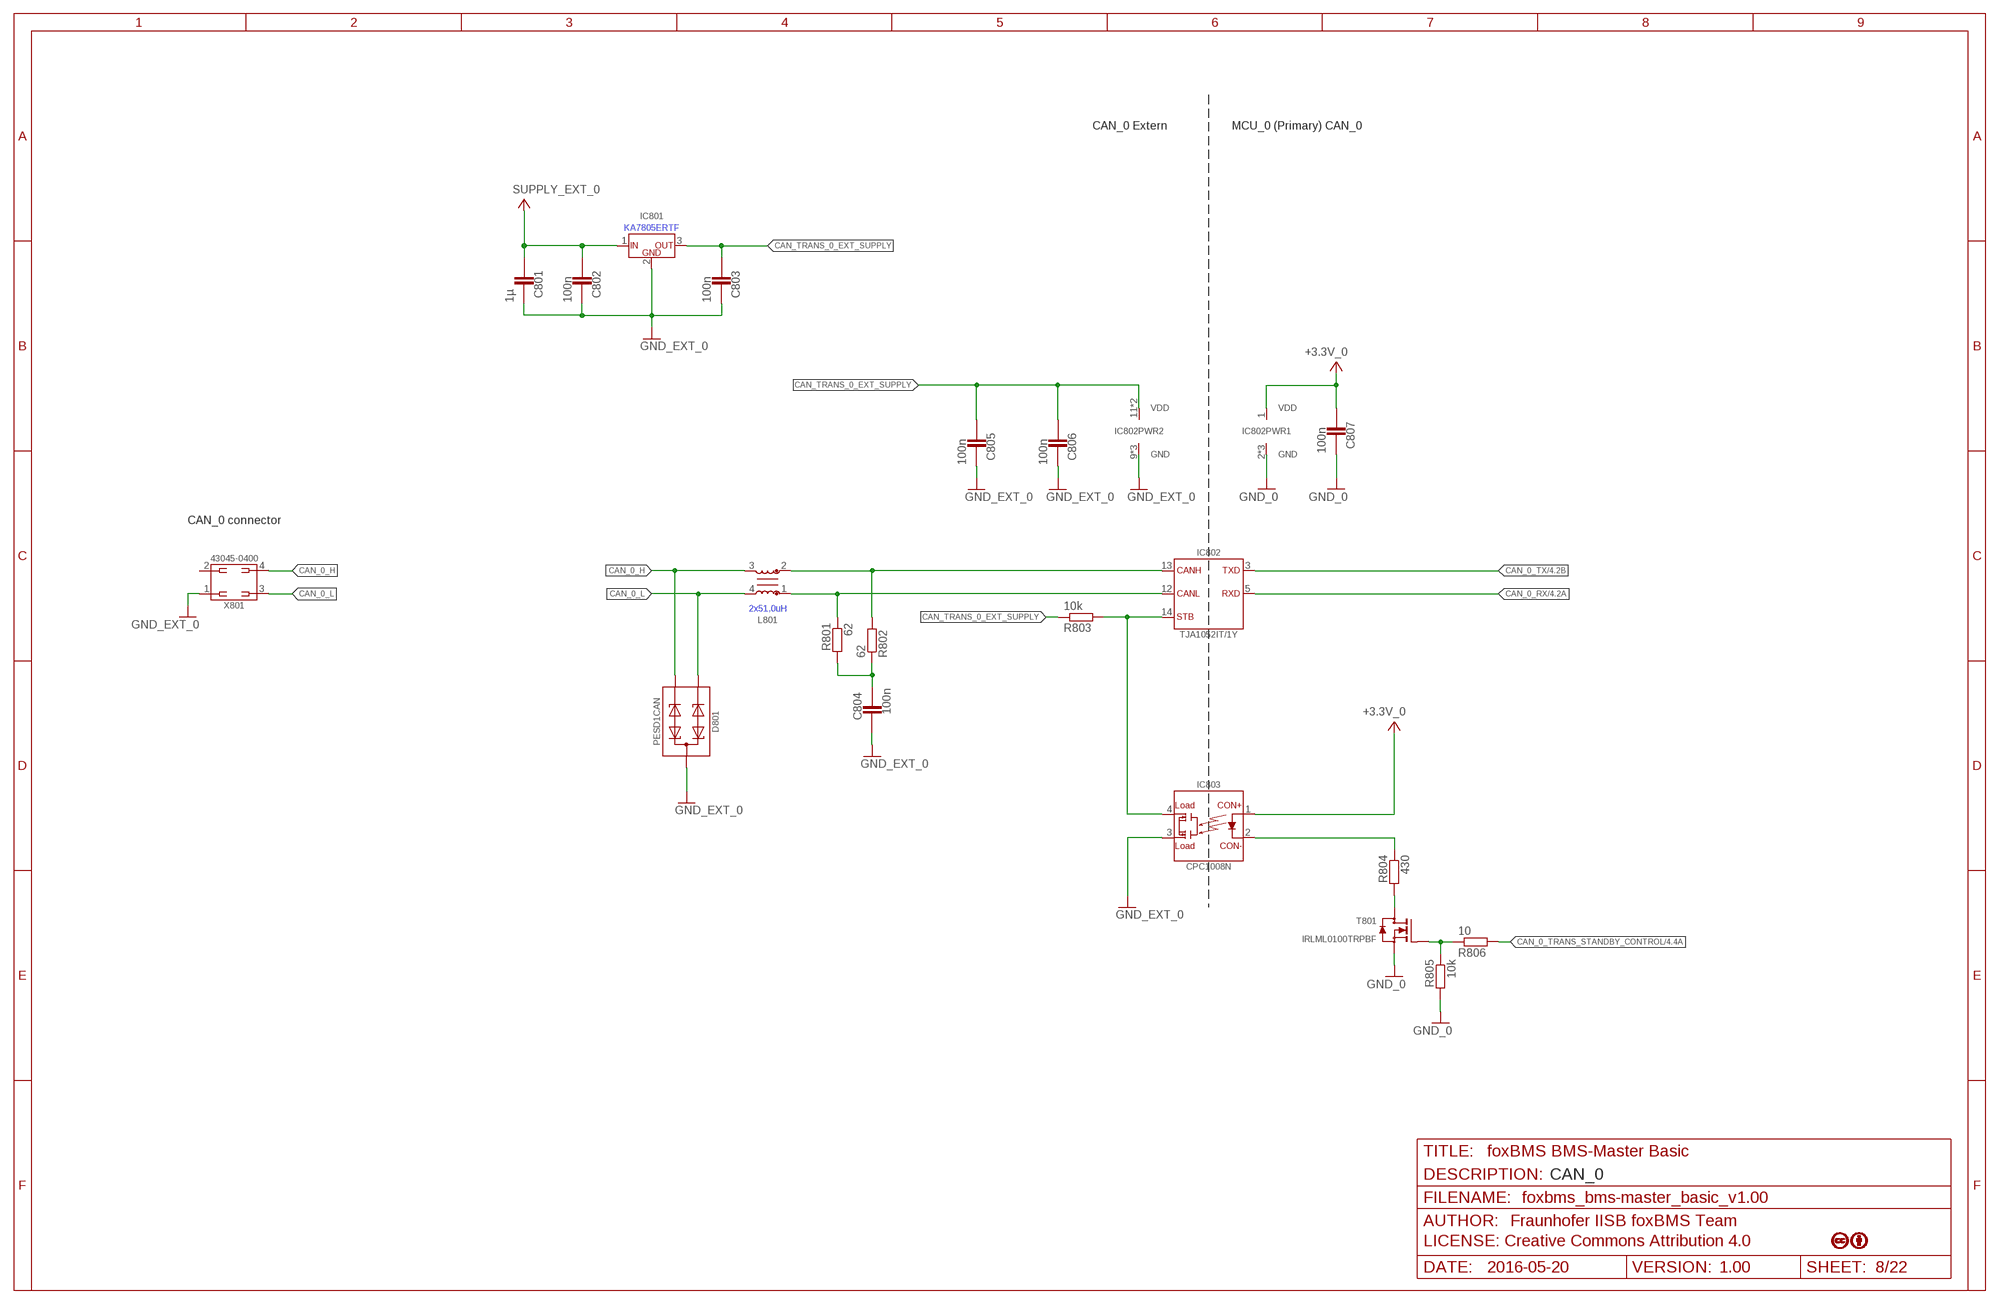
[diagram p7: schematic, sheet 8]

### Parts
C801  1µ  C_X7R_0603  [0603]
C802  100n  C_X7R_0603  [0603]
C803  100n  C_X7R_0603  [0603]
C804  100n  C_X7R_0603  [0603]
C805  100n  C_X7R_0603  [0603]
C806  100n  C_X7R_0603  [0603]
C807  100n  C_X7R_0603  [0603]
D801  PESD1CAN  [D_SMD_SOT23_(TO-236AB)_R_NXP_REV01]
IC801  KA7805ERTF  [IC_SMD_TO-252_(D-PAK)_R_FAIRCHILD_REV01]
IC802  TJA1052IT/1Y  [IC_SMD_SO16_(SOT162-1)_R_NXP_REV01]
IC803  CPC1008N  [K_SMD_SOP-4_R_IXYS_REV01]
L801  B82789C0513H001  [L_SMD_FILTER_HF_R_EPCOS_SIMDAD_1812_REV01]
R801  62  R_CARB_0603  [0603]
R802  62  R_CARB_0603  [0603]
R803  10k  R_CARB_0603  [0603]
R804  430  R_CARB_0603  [0603]
R805  10k  R_CARB_0603  [0603]
R806  10  R_CARB_0603  [0603]
T801  IRLML0100TRPBF  [V_SMD_SOT-23_(TO-236AB)_R_IR_REV01]
X801  43045-0400_MOLEX_4PIN  [X_TH_MOLEX_43045-0400_R_REV01]

### Nets
+3.3V_0: C807.2 IC802.1(VDD) IC803.1(CON+) ; also sheet 2,4,6,7,9,10,11,14,15,16,18,21,22
CAN_0_H: D801.2 L801.3 X801.4
CAN_0_L: D801.1 L801.4 X801.3
CAN_0_RX: IC802.5(RXD) ; also sheet 4
CAN_0_TRANS_STANDBY_CONTROL: R806.2 ; also sheet 4
CAN_0_TX: IC802.3(TXD) ; also sheet 4
CAN_L_INT: IC802.12(CANL) L801.1 R801.1
CAN_SPLIT: C804.1 R801.2 R802.1
CAN_TRANS_0_EXT_SUPPLY [Power]: C803.2 C805.2 C806.2 IC801.3(OUT) IC802.11(VDD) IC802.16(VDD) R803.1
CAN_TRANS_0_STANDBY: IC802.14(STB) IC803.4 R803.2
GND_0: C807.1 IC802.2(GND) IC802.7(GND) IC802.8(GND) R805.2 T801.2(S) ; also sheet 2,4,6,7,9,10,11,14,15,16,18,21,22
GND_EXT_0 [Power]: C801.1 C802.1 C803.1 C804.2 C805.1 C806.1 D801.3 IC801.2(GND) IC802.9(GND) IC802.10(GND) IC802.15(GND) IC803.3 X801.1 ; also sheet 2,3,7,9,11,12
N$45: R804.2 T801.3(D)
N$251: IC802.13(CANH) L801.2 R802.2
N$252: IC803.2(CON-) R804.1
N$285: R805.1 R806.1 T801.1(G)
SUPPLY_EXT_0: C801.2 C802.2 IC801.1(IN) ; also sheet 2,3,7,9,11
Unconnected: IC802.4(NC) IC802.6(NC) X801.2

### Notes on the sheet
- CAN_0 Extern | MCU_0 (Primary) CAN_0
- CAN_0 connector
- CAN_0

## Sheet 9 of 22: Interlock Line
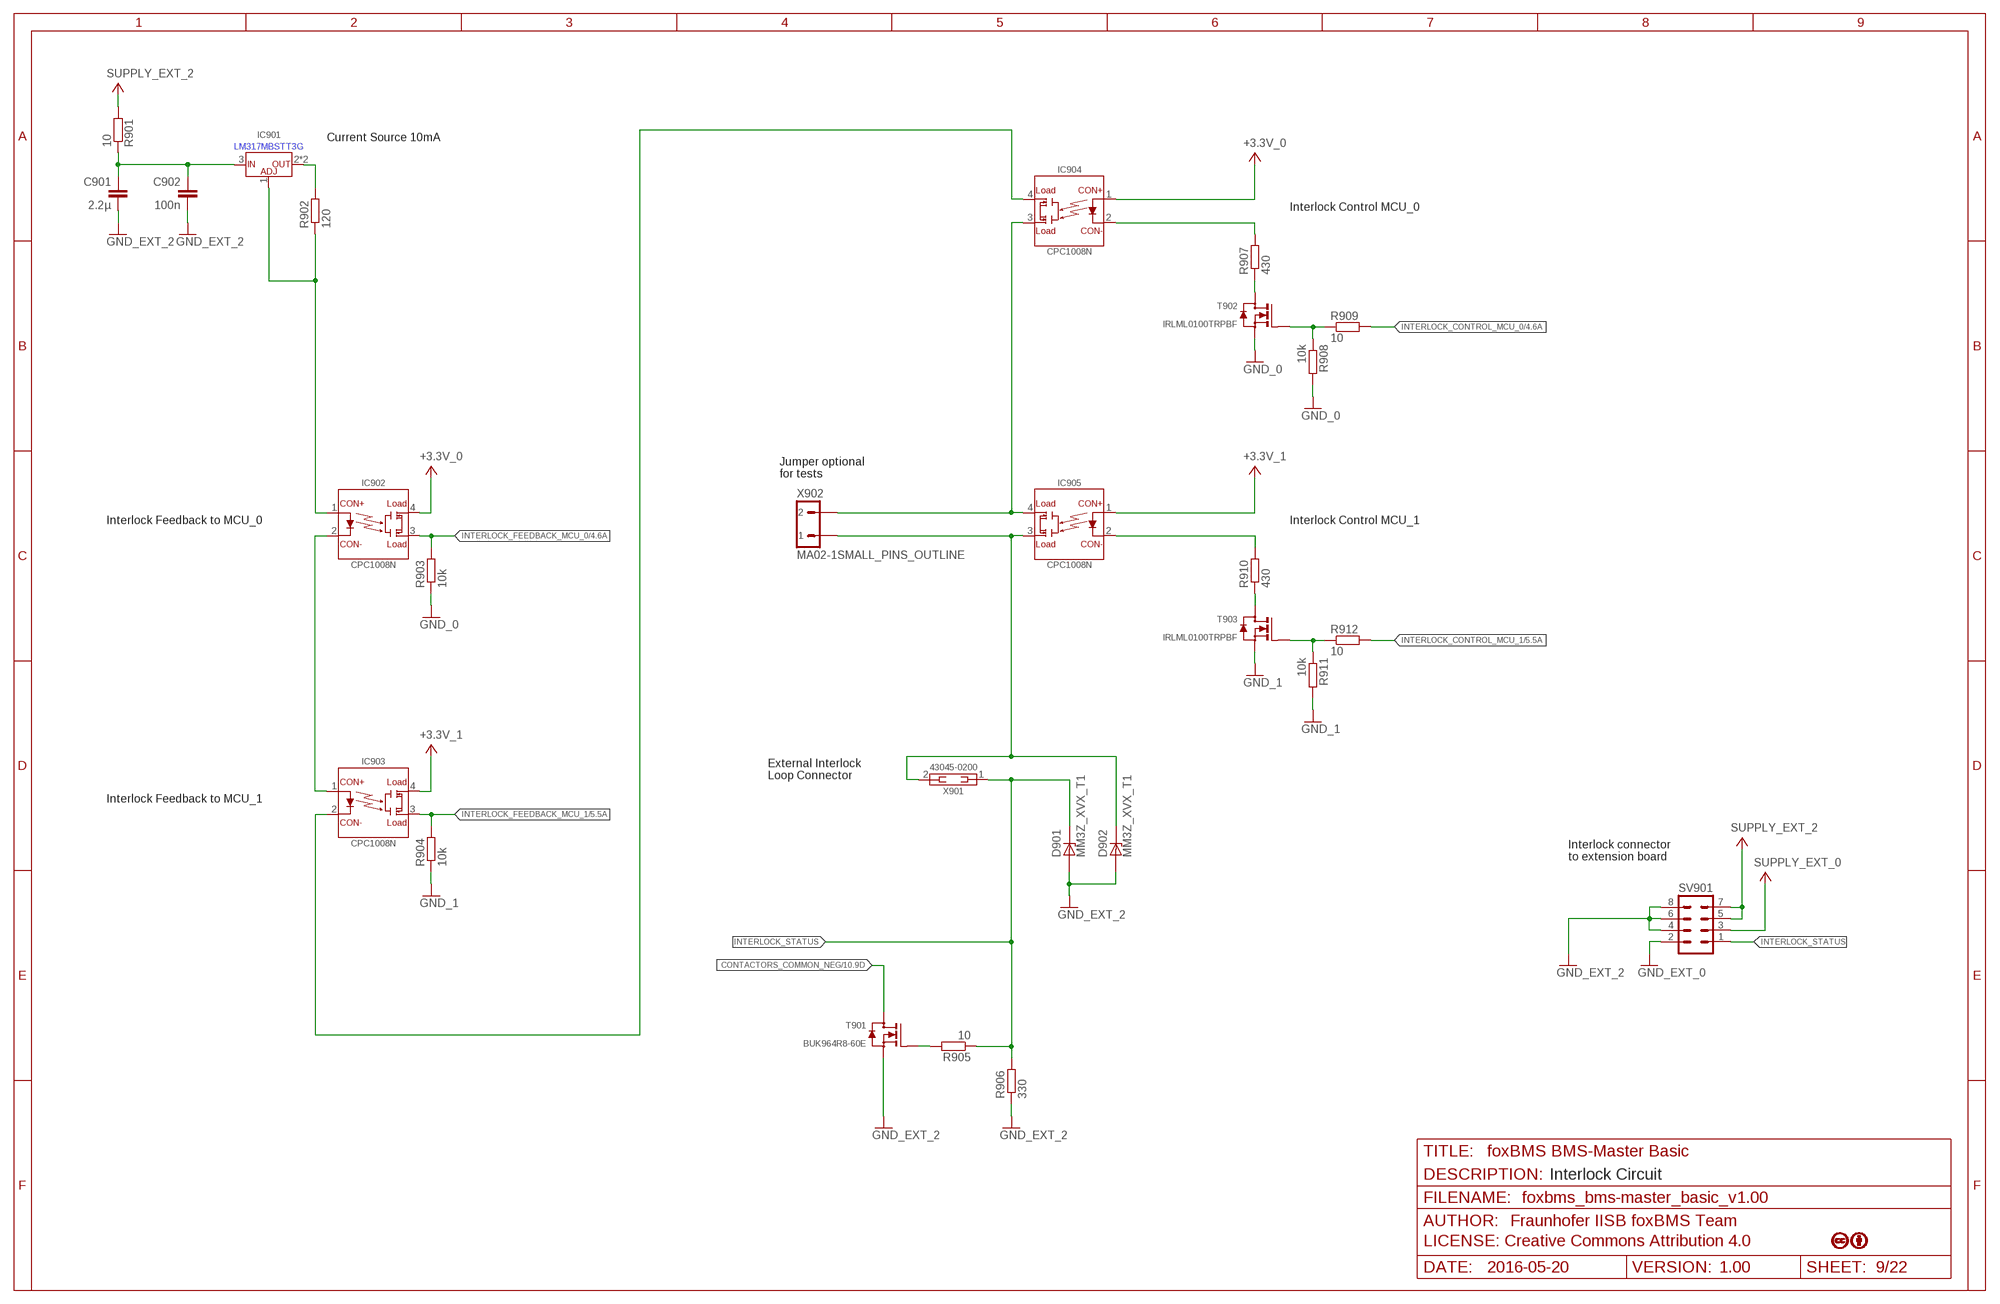
[diagram p8: schematic, sheet 9]

### Parts
C901  2.2µ  C-EUC0805  [C0805]
C902  100n  C-EUC0603  [C0603]
D901  MM3Z_XVX_T1  [SOD323]
D902  MM3Z_XVX_T1  [SOD323]
IC901  LM317MBSTT3G  [IC_SMD_SOT-223_(TO-261)_(CASE318E-04)_R_REV01]
IC902  CPC1008N  [K_SMD_SOP-4_R_IXYS_REV01]
IC903  CPC1008N  [K_SMD_SOP-4_R_IXYS_REV01]
IC904  CPC1008N  [K_SMD_SOP-4_R_IXYS_REV01]
IC905  CPC1008N  [K_SMD_SOP-4_R_IXYS_REV01]
R901  10  R-EU_R0603  [R0603]
R902  120  R-EU_R0603  [R0603]
R903  10k  R-EU_R0603  [R0603]
R904  10k  R-EU_R0603  [R0603]
R905  10  R-EU_R0603  [R0603]
R906  330  R-EU_R0603  [R0603]
R907  430  R-EU_R0603  [R0603]
R908  10k  R-EU_R0603  [R0603]
R909  10  R-EU_R0603  [R0603]
R910  430  R-EU_R0603  [R0603]
R911  10k  R-EU_R0603  [R0603]
R912  10  R-EU_R0603  [R0603]
SV901  MA04-2  [MA04-2]
T901  BUK964R8-60E  [V_SMD_TO-263_(D²PAK)_R_NXP_REV01]
T902  IRLML0100TRPBF  [V_SMD_SOT-23_(TO-236AB)_R_IR_REV01]
T903  IRLML0100TRPBF  [V_SMD_SOT-23_(TO-236AB)_R_IR_REV01]
X901  43045-0200_MOLEX_2PIN  [X_TH_MOLEX_43045-0200_R_REV01]
X902  MA02-1SMALL_PINS_OUTLINE  [MA02-1A]

### Nets
+3.3V_0: IC902.4 IC904.1(CON+) ; also sheet 2,4,6,7,8,10,11,14,15,16,18,21,22
+3.3V_1: IC903.4 IC905.1(CON+) ; also sheet 3,5,6,14,16
CONTACTORS_COMMON_NEG: T901.2(D) ; also sheet 10,12
GND_0: R903.1 R908.2 T902.2(S) ; also sheet 2,4,6,7,8,10,11,14,15,16,18,21,22
GND_1: R904.1 R911.2 T903.2(S) ; also sheet 3,5,6,14,16
GND_EXT_0 [Power]: SV901.2 ; also sheet 2,3,7,8,11,12
GND_EXT_2: C901.2 C902.2 D901.A D902.A R906.1 SV901.4 SV901.6 SV901.8 T901.3(S) ; also sheet 2
INTERLOCK_CONTROL_MCU_0: R909.2 ; also sheet 4
INTERLOCK_CONTROL_MCU_1: R912.2 ; also sheet 5
INTERLOCK_FEEDBACK_MCU_0: IC902.3 R903.2 ; also sheet 4
INTERLOCK_FEEDBACK_MCU_1: IC903.3 R904.2 ; also sheet 5
INTERLOCK_STATUS: D901.C(K) R905.1 R906.2 SV901.1 X901.1
N$27: R905.2 T901.1(G)
N$28: D902.C(K) IC905.3 X901.2 X902.1
N$54: R907.1 T902.3(D)
N$55: R910.1 T903.3(D)
N$82: C901.1 C902.1 IC901.3(IN) R901.1
N$242: IC901.2(OUT) IC901.4(OUT) R902.2
N$243: IC901.1(ADJ) IC902.1(CON+) R902.1
N$244: IC902.2(CON-) IC903.1(CON+)
N$247: IC905.2(CON-) R910.2
N$248: R911.1 R912.1 T903.1(G)
N$260: IC903.2(CON-) IC904.4
N$264: IC904.2(CON-) R907.2
N$265: R908.1 R909.1 T902.1(G)
N$268: IC904.3 IC905.4 X902.2
SUPPLY_EXT_0: SV901.3 ; also sheet 2,3,7,8,11
SUPPLY_EXT_2: R901.2 SV901.5 SV901.7 ; also sheet 2,10

### Notes on the sheet
- Current Source 10mA
- Interlock Control MCU_0
- Jumper optional
  for tests
- Interlock Feedback to MCU_0 | Interlock Control MCU_1
- External Interlock 
  Loop Connector
- Interlock Feedback to MCU_1
- Interlock connector
  to extension board
- Interlock Circuit

## Sheet 10 of 22: Contactor Control
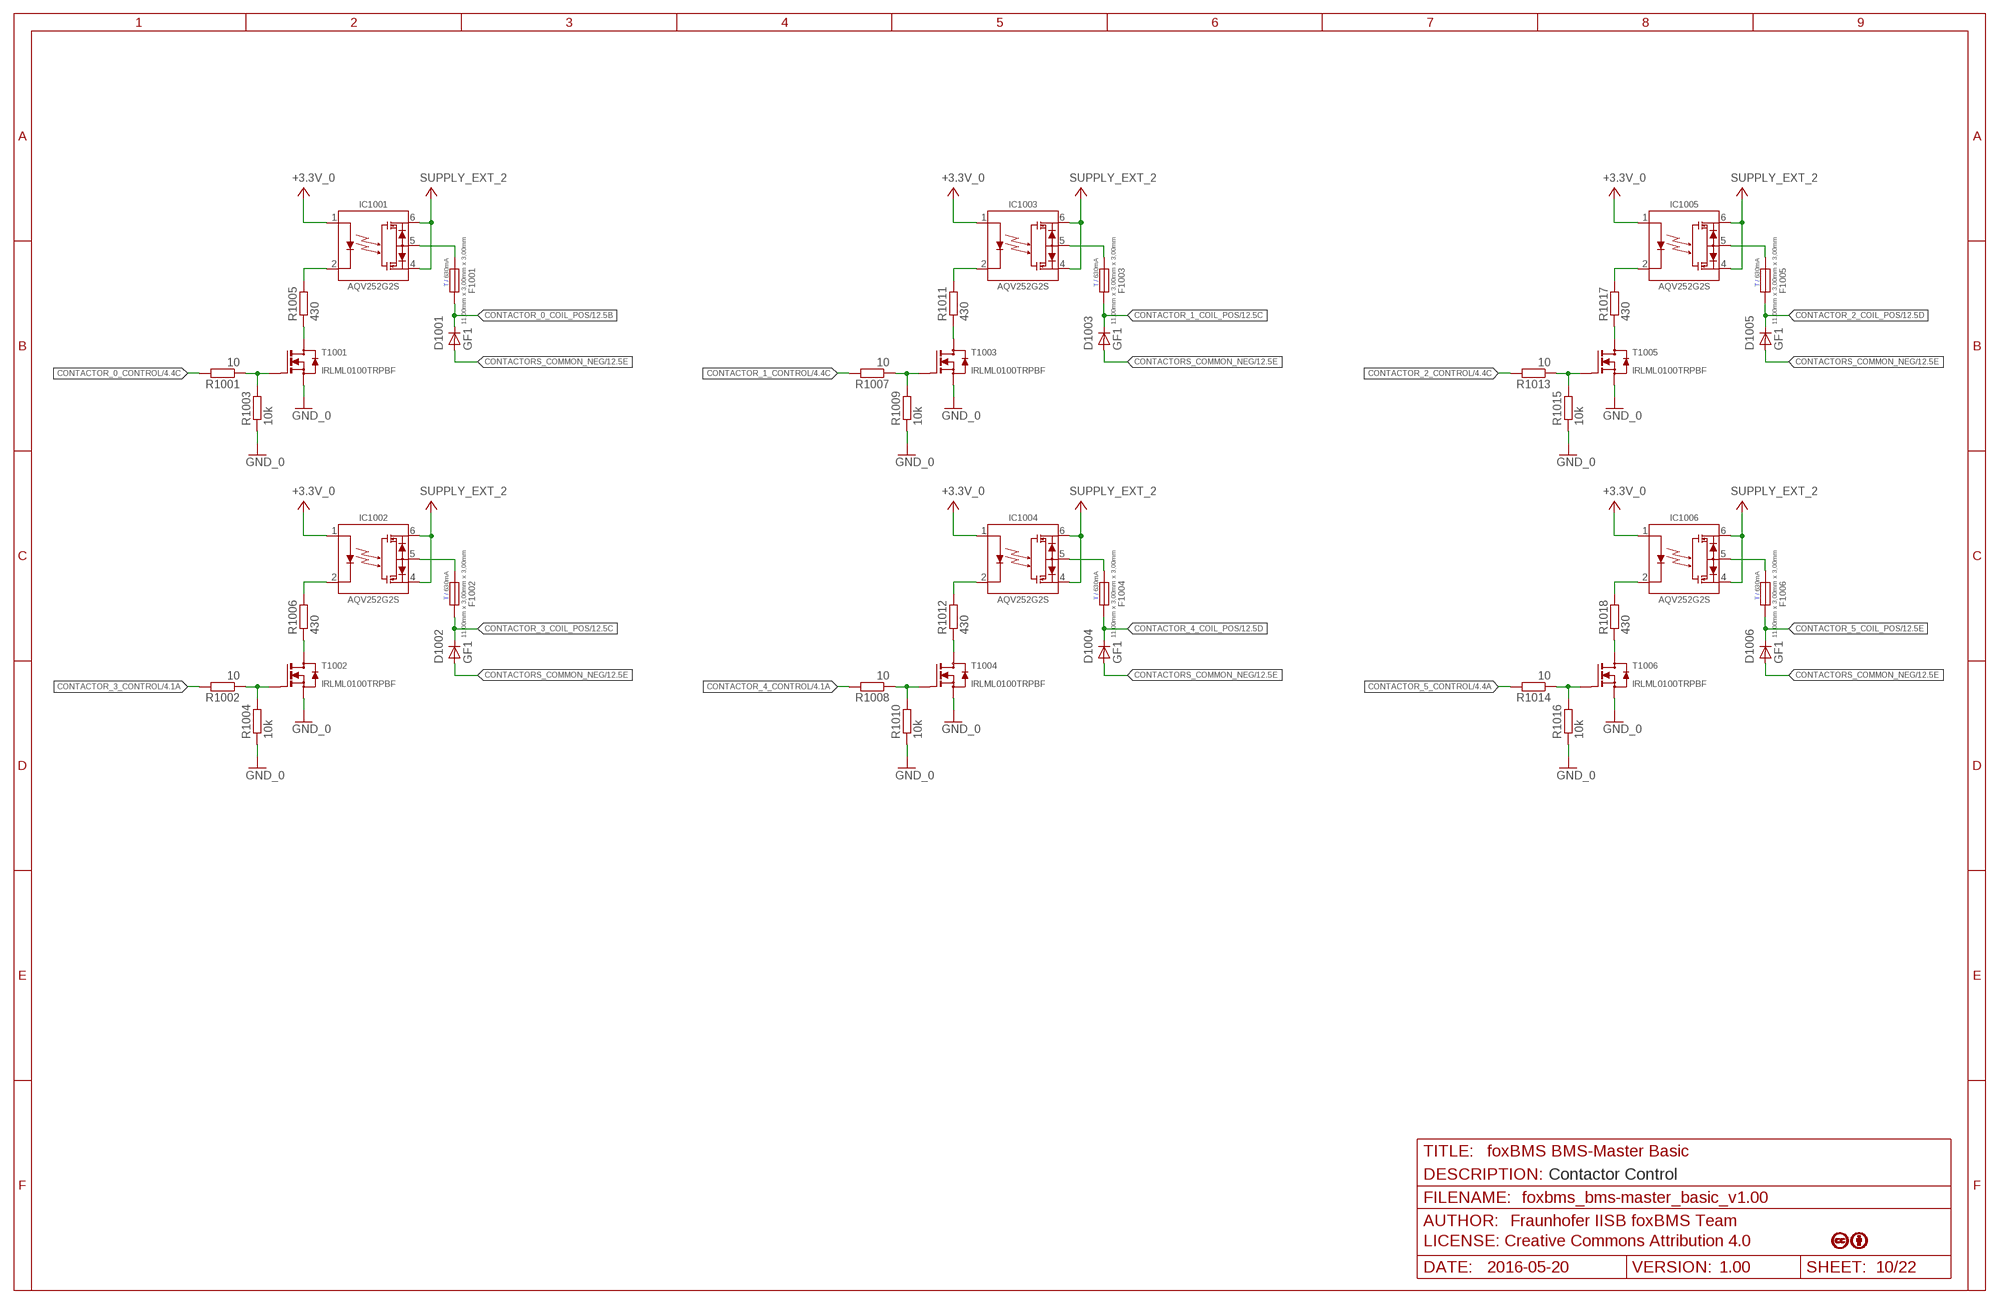
[diagram p9: schematic, sheet 10]

### Parts
D1001  GF1  [SMA-DO214AC]
D1002  GF1  [SMA-DO214AC]
D1003  GF1  [SMA-DO214AC]
D1004  GF1  [SMA-DO214AC]
D1005  GF1  [SMA-DO214AC]
D1006  GF1  [SMA-DO214AC]
F1001  630MA_UMT  [F_SMD_11,00MMX3,00MMX3,00MM_(UMT)_R_SCHURTER_REV01]
F1002  630MA_UMT  [F_SMD_11,00MMX3,00MMX3,00MM_(UMT)_R_SCHURTER_REV01]
F1003  630MA_UMT  [F_SMD_11,00MMX3,00MMX3,00MM_(UMT)_R_SCHURTER_REV01]
F1004  630MA_UMT  [F_SMD_11,00MMX3,00MMX3,00MM_(UMT)_R_SCHURTER_REV01]
F1005  630MA_UMT  [F_SMD_11,00MMX3,00MMX3,00MM_(UMT)_R_SCHURTER_REV01]
F1006  630MA_UMT  [F_SMD_11,00MMX3,00MMX3,00MM_(UMT)_R_SCHURTER_REV01]
IC1001  AQV252G2S  [K_SMD_SOP-6_R_PANASONIC_REV01]
IC1002  AQV252G2S  [K_SMD_SOP-6_R_PANASONIC_REV01]
IC1003  AQV252G2S  [K_SMD_SOP-6_R_PANASONIC_REV01]
IC1004  AQV252G2S  [K_SMD_SOP-6_R_PANASONIC_REV01]
IC1005  AQV252G2S  [K_SMD_SOP-6_R_PANASONIC_REV01]
IC1006  AQV252G2S  [K_SMD_SOP-6_R_PANASONIC_REV01]
R1001  10  R-EU_R0603  [R0603]
R1002  10  R-EU_R0603  [R0603]
R1003  10k  R-EU_R0603  [R0603]
R1004  10k  R-EU_R0603  [R0603]
R1005  430  R-EU_R0603  [R0603]
R1006  430  R-EU_R0603  [R0603]
R1007  10  R-EU_R0603  [R0603]
R1008  10  R-EU_R0603  [R0603]
R1009  10k  R-EU_R0603  [R0603]
R1010  10k  R-EU_R0603  [R0603]
R1011  430  R-EU_R0603  [R0603]
R1012  430  R-EU_R0603  [R0603]
R1013  10  R-EU_R0603  [R0603]
R1014  10  R-EU_R0603  [R0603]
R1015  10k  R-EU_R0603  [R0603]
R1016  10k  R-EU_R0603  [R0603]
R1017  430  R-EU_R0603  [R0603]
R1018  430  R-EU_R0603  [R0603]
T1001  IRLML0100TRPBF  [V_SMD_SOT-23_(TO-236AB)_R_IR_REV01]
T1002  IRLML0100TRPBF  [V_SMD_SOT-23_(TO-236AB)_R_IR_REV01]
T1003  IRLML0100TRPBF  [V_SMD_SOT-23_(TO-236AB)_R_IR_REV01]
T1004  IRLML0100TRPBF  [V_SMD_SOT-23_(TO-236AB)_R_IR_REV01]
T1005  IRLML0100TRPBF  [V_SMD_SOT-23_(TO-236AB)_R_IR_REV01]
T1006  IRLML0100TRPBF  [V_SMD_SOT-23_(TO-236AB)_R_IR_REV01]

### Nets
+3.3V_0: IC1001.1 IC1002.1 IC1003.1 IC1004.1 IC1005.1 IC1006.1 ; also sheet 2,4,6,7,8,9,11,14,15,16,18,21,22
CONTACTOR_0_COIL_POS: D1001.K(C) F1001.2 ; also sheet 12
CONTACTOR_0_CONTROL: R1001.2 ; also sheet 4
CONTACTOR_1_COIL_POS: D1003.K(C) F1003.2 ; also sheet 12
CONTACTOR_1_CONTROL: R1007.2 ; also sheet 4
CONTACTOR_2_COIL_POS: D1005.K(C) F1005.2 ; also sheet 12
CONTACTOR_2_CONTROL: R1013.2 ; also sheet 4
CONTACTOR_3_COIL_POS: D1002.K(C) F1002.2 ; also sheet 12
CONTACTOR_3_CONTROL: R1002.2 ; also sheet 4
CONTACTOR_4_COIL_POS: D1004.K(C) F1004.2 ; also sheet 12
CONTACTOR_4_CONTROL: R1008.2 ; also sheet 4
CONTACTOR_5_COIL_POS: D1006.K(C) F1006.2 ; also sheet 12
CONTACTOR_5_CONTROL: R1014.2 ; also sheet 4
CONTACTORS_COMMON_NEG: D1001.A D1002.A D1003.A D1004.A D1005.A D1006.A ; also sheet 9,12
GND_0: R1003.1 R1004.1 R1009.1 R1010.1 R1015.1 R1016.1 T1001.2(S) T1002.2(S) T1003.2(S) T1004.2(S) T1005.2(S) T1006.2(S) ; also sheet 2,4,6,7,8,9,11,14,15,16,18,21,22
N$5: IC1002.2 R1006.2
N$6: R1006.1 T1002.3(D)
N$8: IC1001.2 R1005.2
N$29: R1005.1 T1001.3(D)
N$46: R1011.1 T1003.3(D)
N$47: IC1003.2 R1011.2
N$48: IC1004.2 R1012.2
N$49: R1012.1 T1004.3(D)
N$50: IC1005.2 R1017.2
N$51: R1017.1 T1005.3(D)
N$52: IC1006.2 R1018.2
N$53: R1018.1 T1006.3(D)
N$68: F1001.1 IC1001.5
N$77: F1003.1 IC1003.5
N$78: F1004.1 IC1004.5
N$79: F1005.1 IC1005.5
N$80: F1002.1 IC1002.5
N$81: F1006.1 IC1006.5
N$259: R1007.1 R1009.2 T1003.1(G)
N$282: R1001.1 R1003.2 T1001.1(G)
N$291: R1013.1 R1015.2 T1005.1(G)
N$300: R1002.1 R1004.2 T1002.1(G)
N$303: R1008.1 R1010.2 T1004.1(G)
N$306: R1014.1 R1016.2 T1006.1(G)
SUPPLY_EXT_2: IC1001.4 IC1001.6 IC1002.4 IC1002.6 IC1003.4 IC1003.6 IC1004.4 IC1004.6 IC1005.4 IC1005.6 IC1006.4 IC1006.6 ; also sheet 2,9
Unconnected: IC1001.3(NC) IC1002.3(NC) IC1003.3(NC) IC1004.3(NC) IC1005.3(NC) IC1006.3(NC)

### Notes on the sheet
- Contactor Control

## Sheet 11 of 22: Contactor Feedback
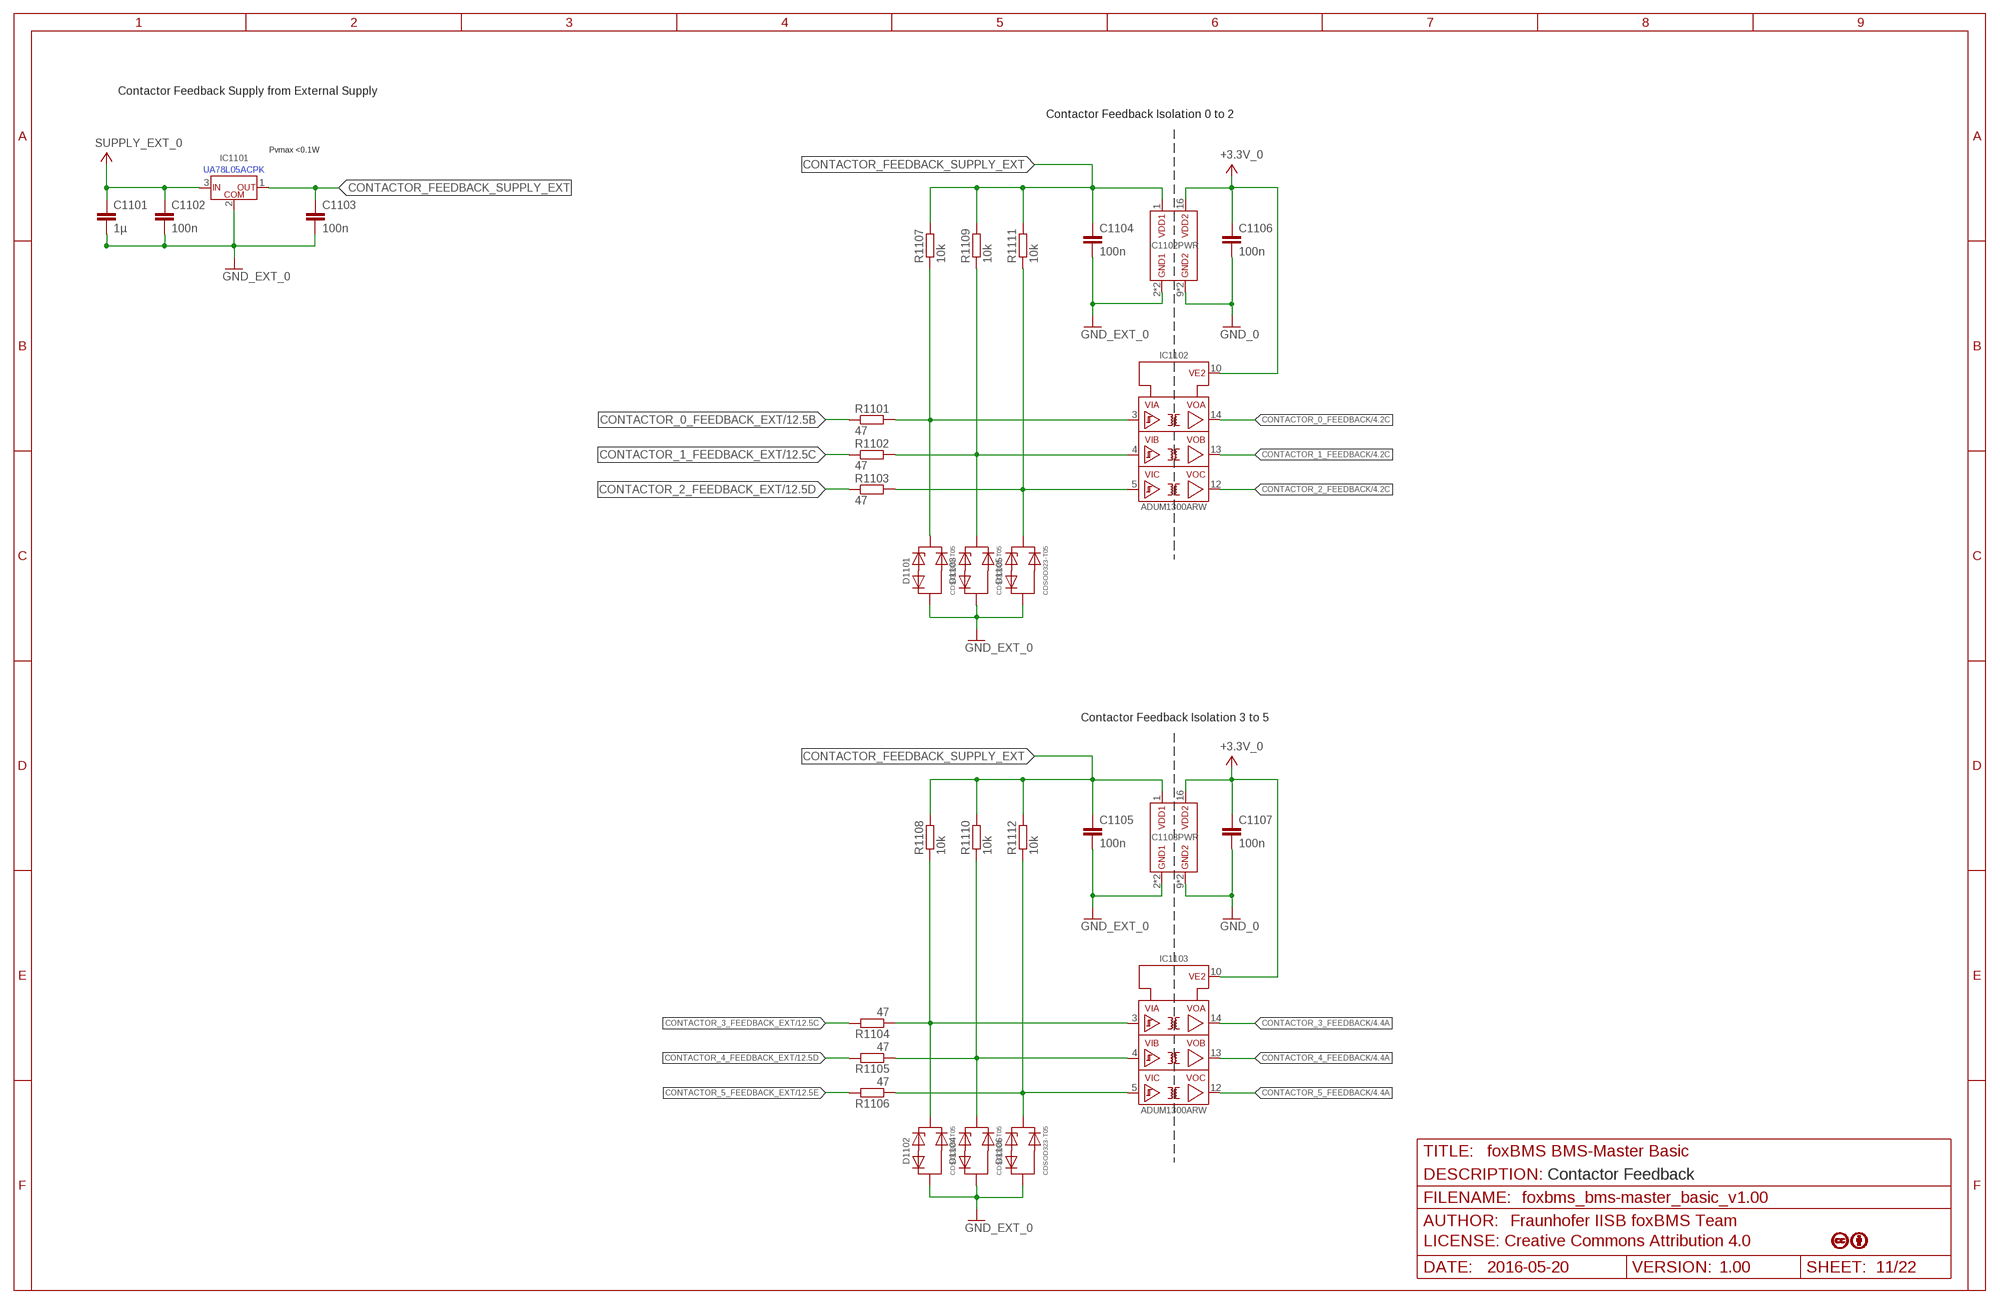
[diagram p10: schematic, sheet 11]

### Parts
C1101  1µ  C-EUC0603  [C0603]
C1102  100n  C-EUC0603  [C0603]
C1103  100n  C-EUC0603  [C0603]
C1104  100n  C-EUC0603  [C0603]
C1105  100n  C-EUC0603  [C0603]
C1106  100n  C-EUC0603  [C0603]
C1107  100n  C-EUC0603  [C0603]
D1101  CDSOD323-T05  [D_SMD_SOD323_(SC-76)_R_BOURNS_REV01]
D1102  CDSOD323-T05  [D_SMD_SOD323_(SC-76)_R_BOURNS_REV01]
D1103  CDSOD323-T05  [D_SMD_SOD323_(SC-76)_R_BOURNS_REV01]
D1104  CDSOD323-T05  [D_SMD_SOD323_(SC-76)_R_BOURNS_REV01]
D1105  CDSOD323-T05  [D_SMD_SOD323_(SC-76)_R_BOURNS_REV01]
D1106  CDSOD323-T05  [D_SMD_SOD323_(SC-76)_R_BOURNS_REV01]
IC1101  UA78L05ACPK  [IC_SMD_SOT-89_(SC-62/TO-243)_(R-PSSO-F3)_R_TI_REV01]
IC1102  ADUM1300ARW  [IC_SMD_SOIC-16_(JEDEC_MS-013-AA)_R_ANALOG_REV01]
IC1103  ADUM1300ARW  [IC_SMD_SOIC-16_(JEDEC_MS-013-AA)_R_ANALOG_REV01]
R1101  47  R-EU_R0603  [R0603]
R1102  47  R-EU_R0603  [R0603]
R1103  47  R-EU_R0603  [R0603]
R1104  47  R-EU_R0603  [R0603]
R1105  47  R-EU_R0603  [R0603]
R1106  47  R-EU_R0603  [R0603]
R1107  10k  R-EU_R0603  [R0603]
R1108  10k  R-EU_R0603  [R0603]
R1109  10k  R-EU_R0603  [R0603]
R1110  10k  R-EU_R0603  [R0603]
R1111  10k  R-EU_R0603  [R0603]
R1112  10k  R-EU_R0603  [R0603]

### Nets
+3.3V_0: C1106.1 C1107.1 IC1102.10(VE2) IC1102.16(VDD2) IC1103.10(VE2) IC1103.16(VDD2) ; also sheet 2,4,6,7,8,9,10,14,15,16,18,21,22
CONTACTOR_0_FEEDBACK: IC1102.14(VOA) ; also sheet 4
CONTACTOR_0_FEEDBACK_EXT: R1101.1 ; also sheet 12
CONTACTOR_1_FEEDBACK: IC1102.13(VOB) ; also sheet 4
CONTACTOR_1_FEEDBACK_EXT: R1102.1 ; also sheet 12
CONTACTOR_2_FEEDBACK: IC1102.12(VOC) ; also sheet 4
CONTACTOR_2_FEEDBACK_EXT: R1103.1 ; also sheet 12
CONTACTOR_3_FEEDBACK: IC1103.14(VOA) ; also sheet 4
CONTACTOR_3_FEEDBACK_EXT: R1104.2 ; also sheet 12
CONTACTOR_4_FEEDBACK: IC1103.13(VOB) ; also sheet 4
CONTACTOR_4_FEEDBACK_EXT: R1105.2 ; also sheet 12
CONTACTOR_5_FEEDBACK: IC1103.12(VOC) ; also sheet 4
CONTACTOR_5_FEEDBACK_EXT: R1106.2 ; also sheet 12
CONTACTOR_FEEDBACK_SUPPLY_EXT: C1103.1 C1104.1 C1105.1 IC1101.1(OUT) IC1102.1(VDD1) IC1103.1(VDD1) R1107.2 R1108.2 R1109.2 R1110.2 R1111.2 R1112.2
GND_0: C1106.2 C1107.2 IC1102.9(GND2) IC1102.15(GND2) IC1103.9(GND2) IC1103.15(GND2) ; also sheet 2,4,6,7,8,9,10,14,15,16,18,21,22
GND_EXT_0 [Power]: C1101.2 C1102.2 C1103.2 C1104.2 C1105.2 D1101.A D1102.A D1103.A D1104.A D1105.A D1106.A IC1101.2(COM) IC1102.2(GND1) IC1102.8(GND1) IC1103.2(GND1) IC1103.8(GND1) ; also sheet 2,3,7,8,9,12
N$96: D1101.C IC1102.3(VIA) R1101.2 R1107.1
N$97: D1103.C IC1102.4(VIB) R1102.2 R1109.1
N$98: D1105.C IC1102.5(VIC) R1103.2 R1111.1
N$99: D1102.C IC1103.3(VIA) R1104.1 R1108.1
N$100: D1104.C IC1103.4(VIB) R1105.1 R1110.1
N$101: D1106.C IC1103.5(VIC) R1106.1 R1112.1
SUPPLY_EXT_0: C1101.1 C1102.1 IC1101.3(IN) ; also sheet 2,3,7,8,9
Unconnected: IC1102.6(NC$1) IC1102.7(NC$1) IC1102.11(NC$1) IC1103.6(NC$1) IC1103.7(NC$1) IC1103.11(NC$1)

### Notes on the sheet
- Contactor Feedback Supply from External Supply
- Contactor Feedback Isolation 0 to 2
- Pvmax <0.1W
- Contactor Feedback Isolation 3 to 5
- Contactor Feedback

## Sheet 12 of 22: Contactor Connectors
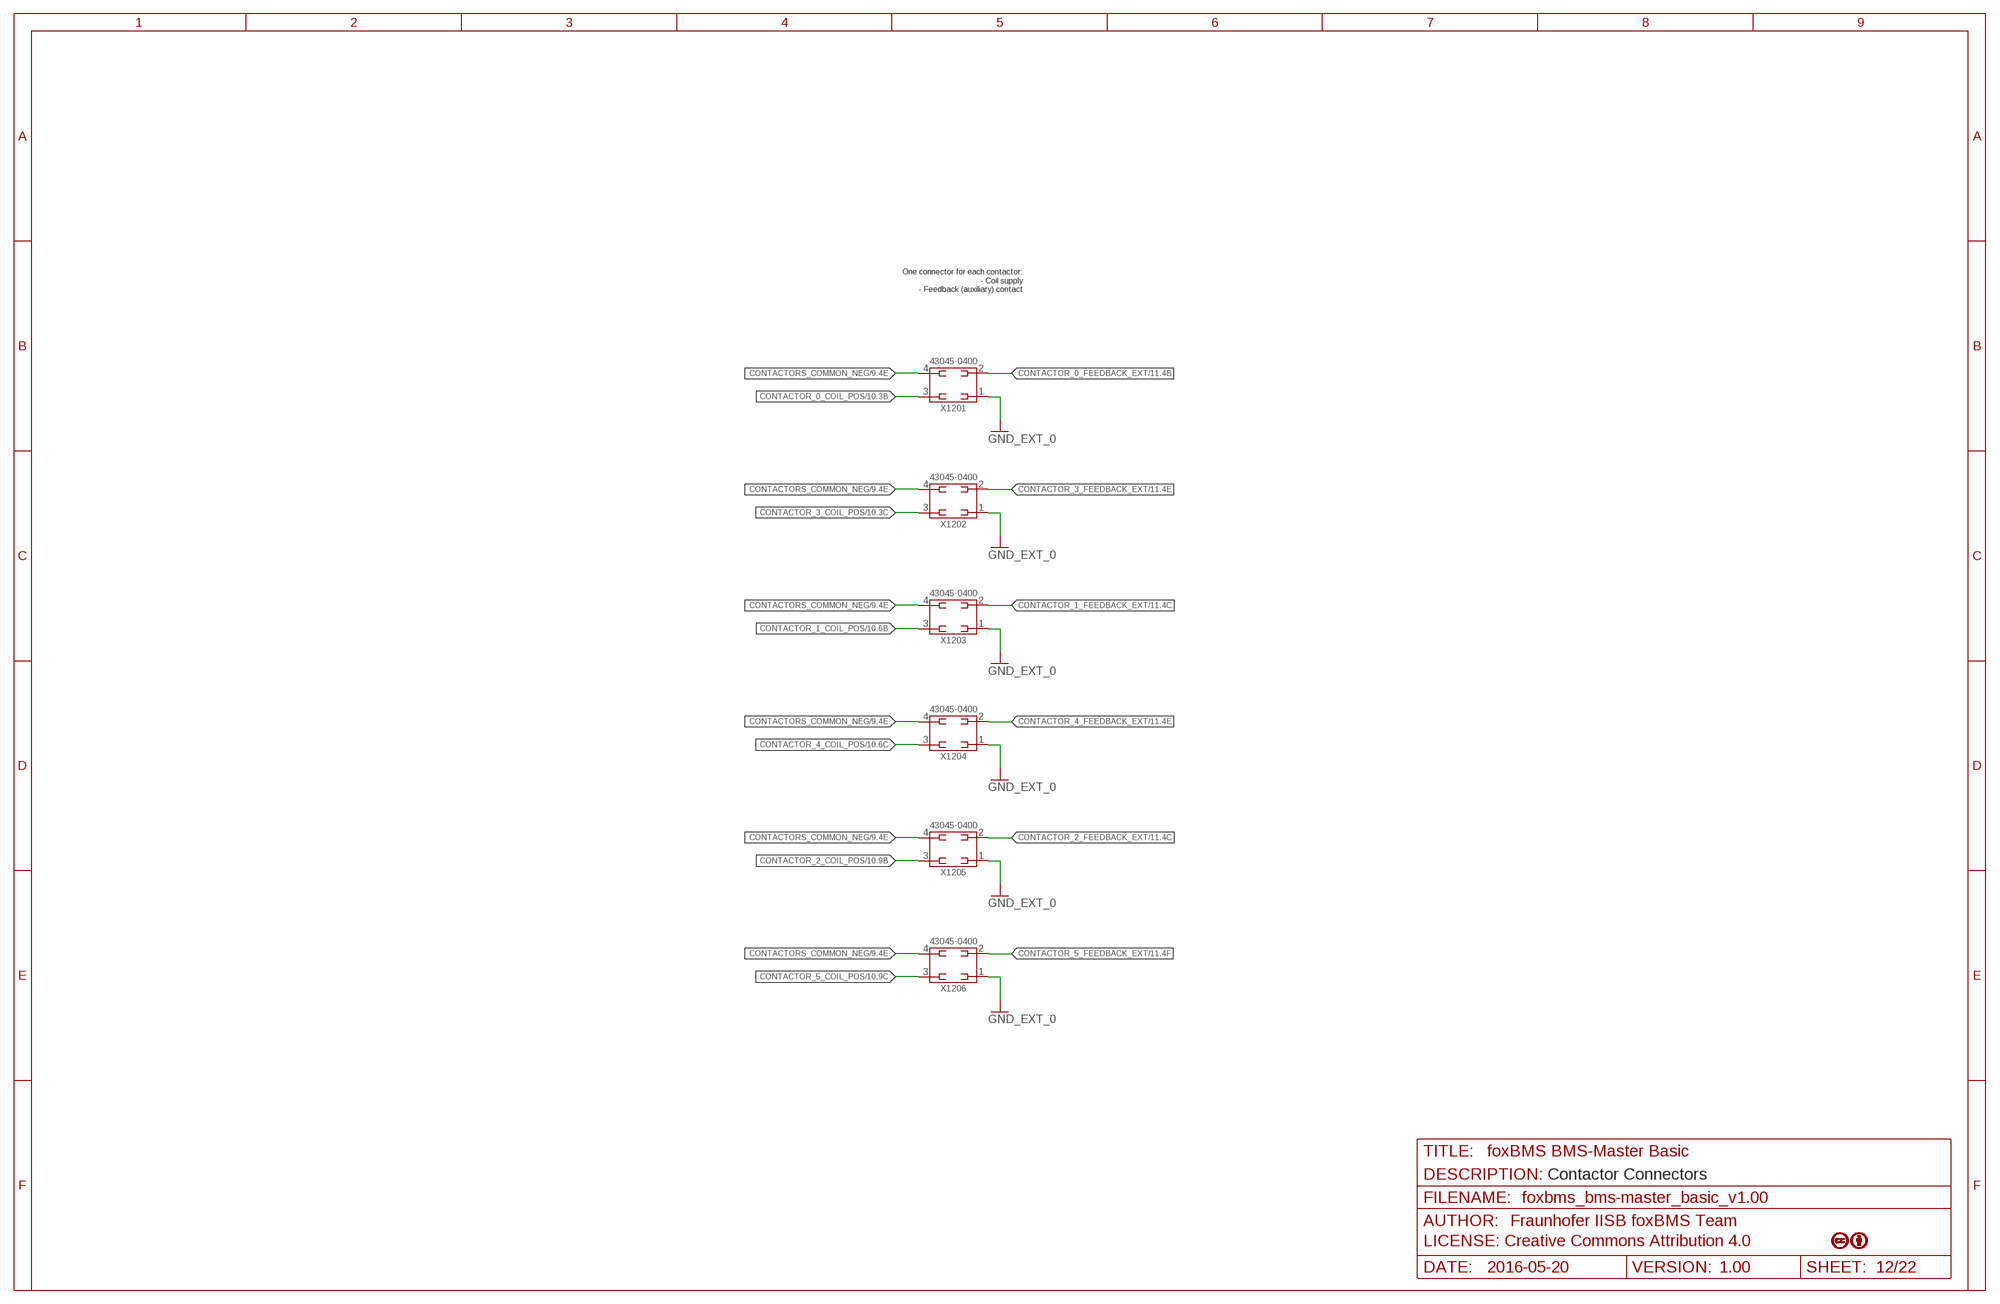
[diagram p11: schematic, sheet 12]

### Parts
X1201  43045-0400_MOLEX_4PIN  [X_TH_MOLEX_43045-0400_R_REV01]
X1202  43045-0400_MOLEX_4PIN  [X_TH_MOLEX_43045-0400_R_REV01]
X1203  43045-0400_MOLEX_4PIN  [X_TH_MOLEX_43045-0400_R_REV01]
X1204  43045-0400_MOLEX_4PIN  [X_TH_MOLEX_43045-0400_R_REV01]
X1205  43045-0400_MOLEX_4PIN  [X_TH_MOLEX_43045-0400_R_REV01]
X1206  43045-0400_MOLEX_4PIN  [X_TH_MOLEX_43045-0400_R_REV01]

### Nets
CONTACTOR_0_COIL_POS: X1201.3 ; also sheet 10
CONTACTOR_0_FEEDBACK_EXT: X1201.2 ; also sheet 11
CONTACTOR_1_COIL_POS: X1203.3 ; also sheet 10
CONTACTOR_1_FEEDBACK_EXT: X1203.2 ; also sheet 11
CONTACTOR_2_COIL_POS: X1205.3 ; also sheet 10
CONTACTOR_2_FEEDBACK_EXT: X1205.2 ; also sheet 11
CONTACTOR_3_COIL_POS: X1202.3 ; also sheet 10
CONTACTOR_3_FEEDBACK_EXT: X1202.2 ; also sheet 11
CONTACTOR_4_COIL_POS: X1204.3 ; also sheet 10
CONTACTOR_4_FEEDBACK_EXT: X1204.2 ; also sheet 11
CONTACTOR_5_COIL_POS: X1206.3 ; also sheet 10
CONTACTOR_5_FEEDBACK_EXT: X1206.2 ; also sheet 11
CONTACTORS_COMMON_NEG: X1201.4 X1202.4 X1203.4 X1204.4 X1205.4 X1206.4 ; also sheet 9,10
GND_EXT_0 [Power]: X1201.1 X1202.1 X1203.1 X1204.1 X1205.1 X1206.1 ; also sheet 2,3,7,8,9,11

### Notes on the sheet
- One connector for each contactor:
  - Coil supply
  - Feedback (auxiliary) contact
- Contactor Connectors

## Sheet 13 of 22: RS485
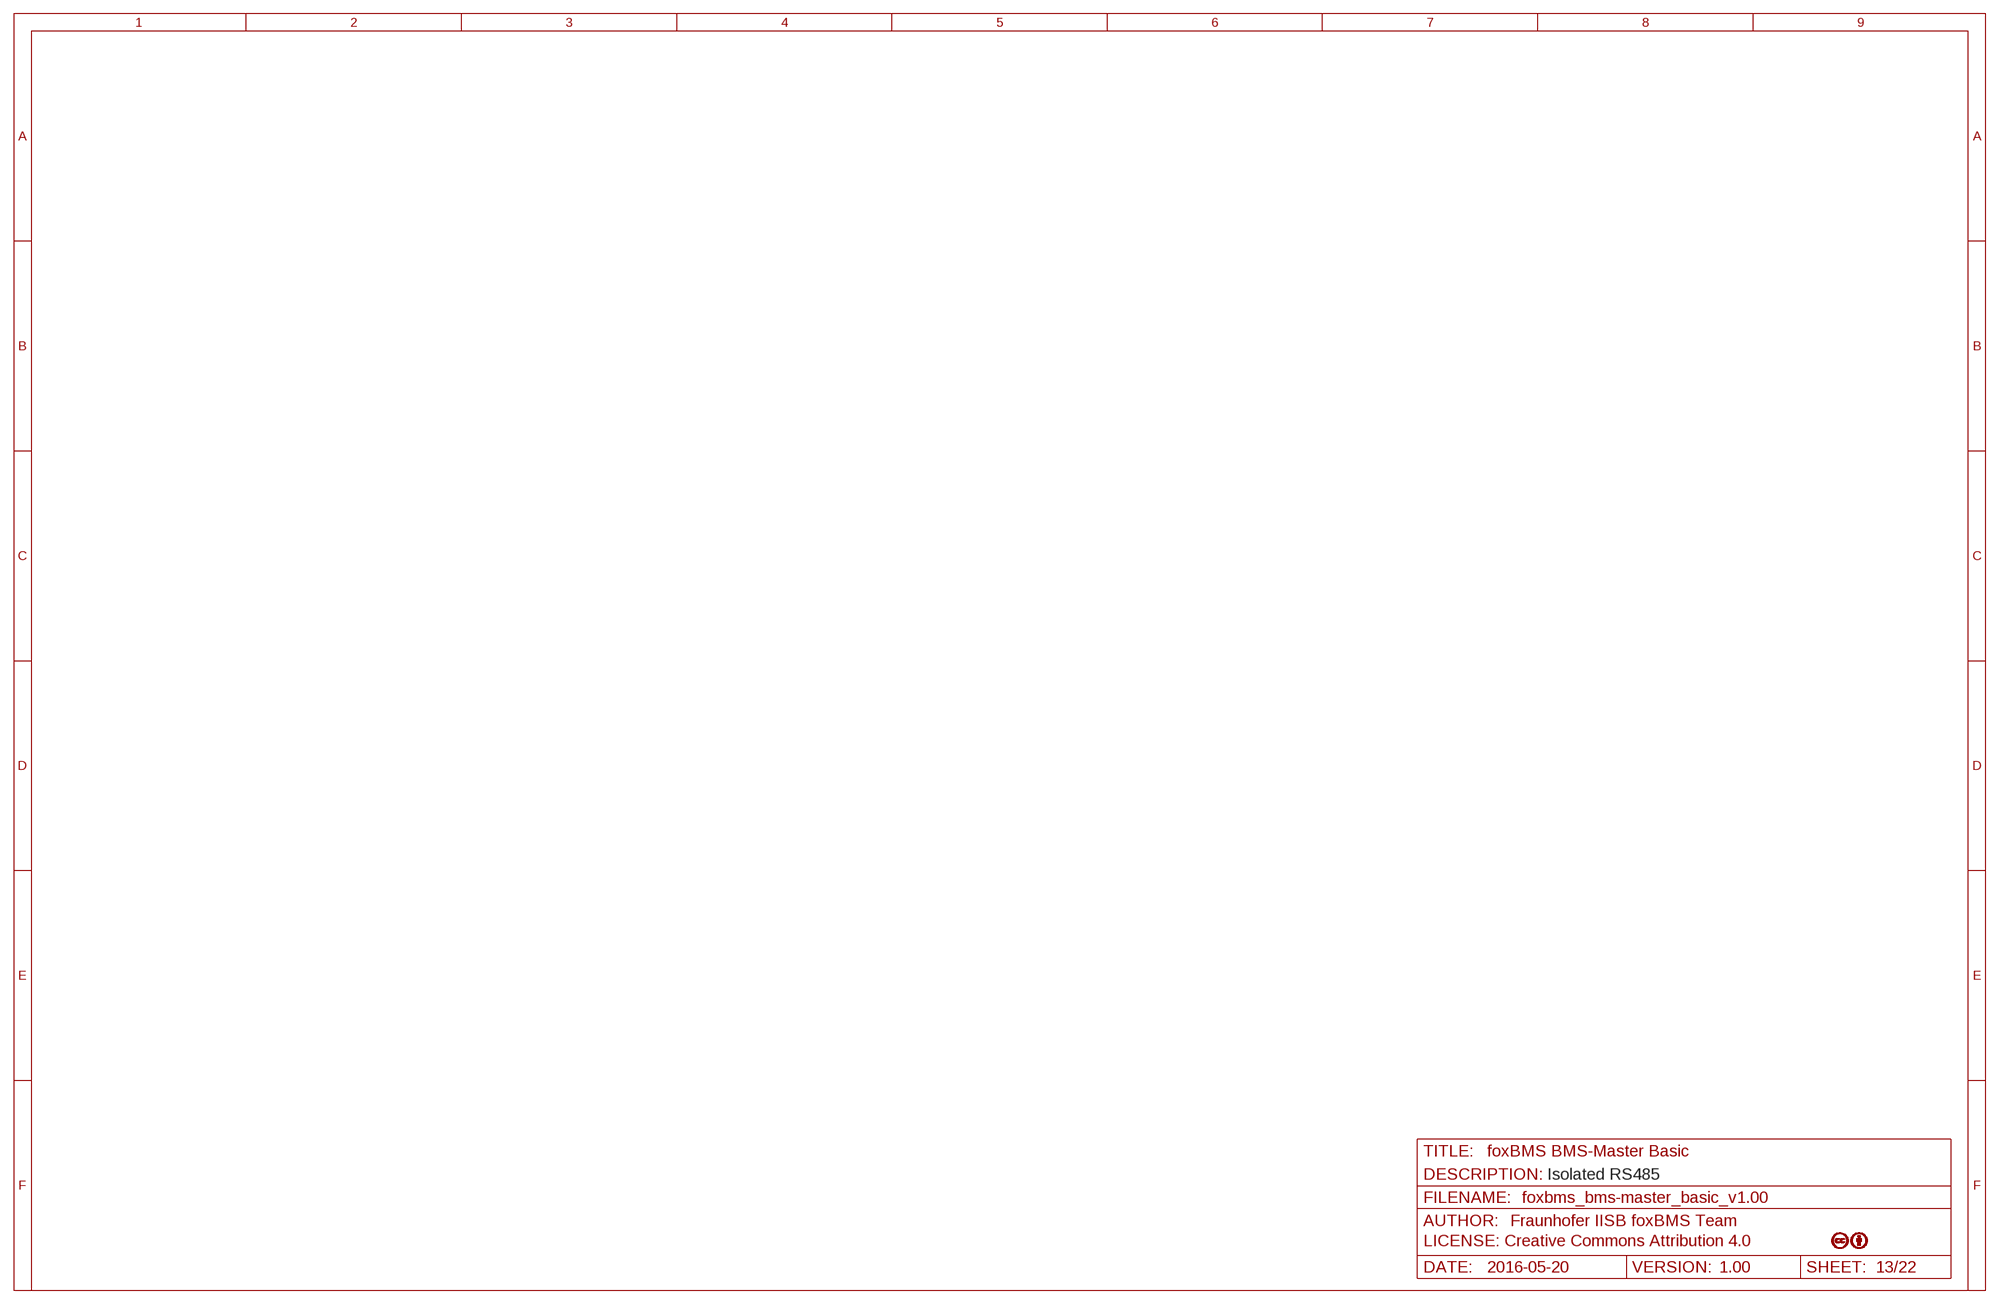
[diagram p12: schematic, sheet 13]

### Notes on the sheet
- Isolated RS485

## Sheet 14 of 22: Isolated USB
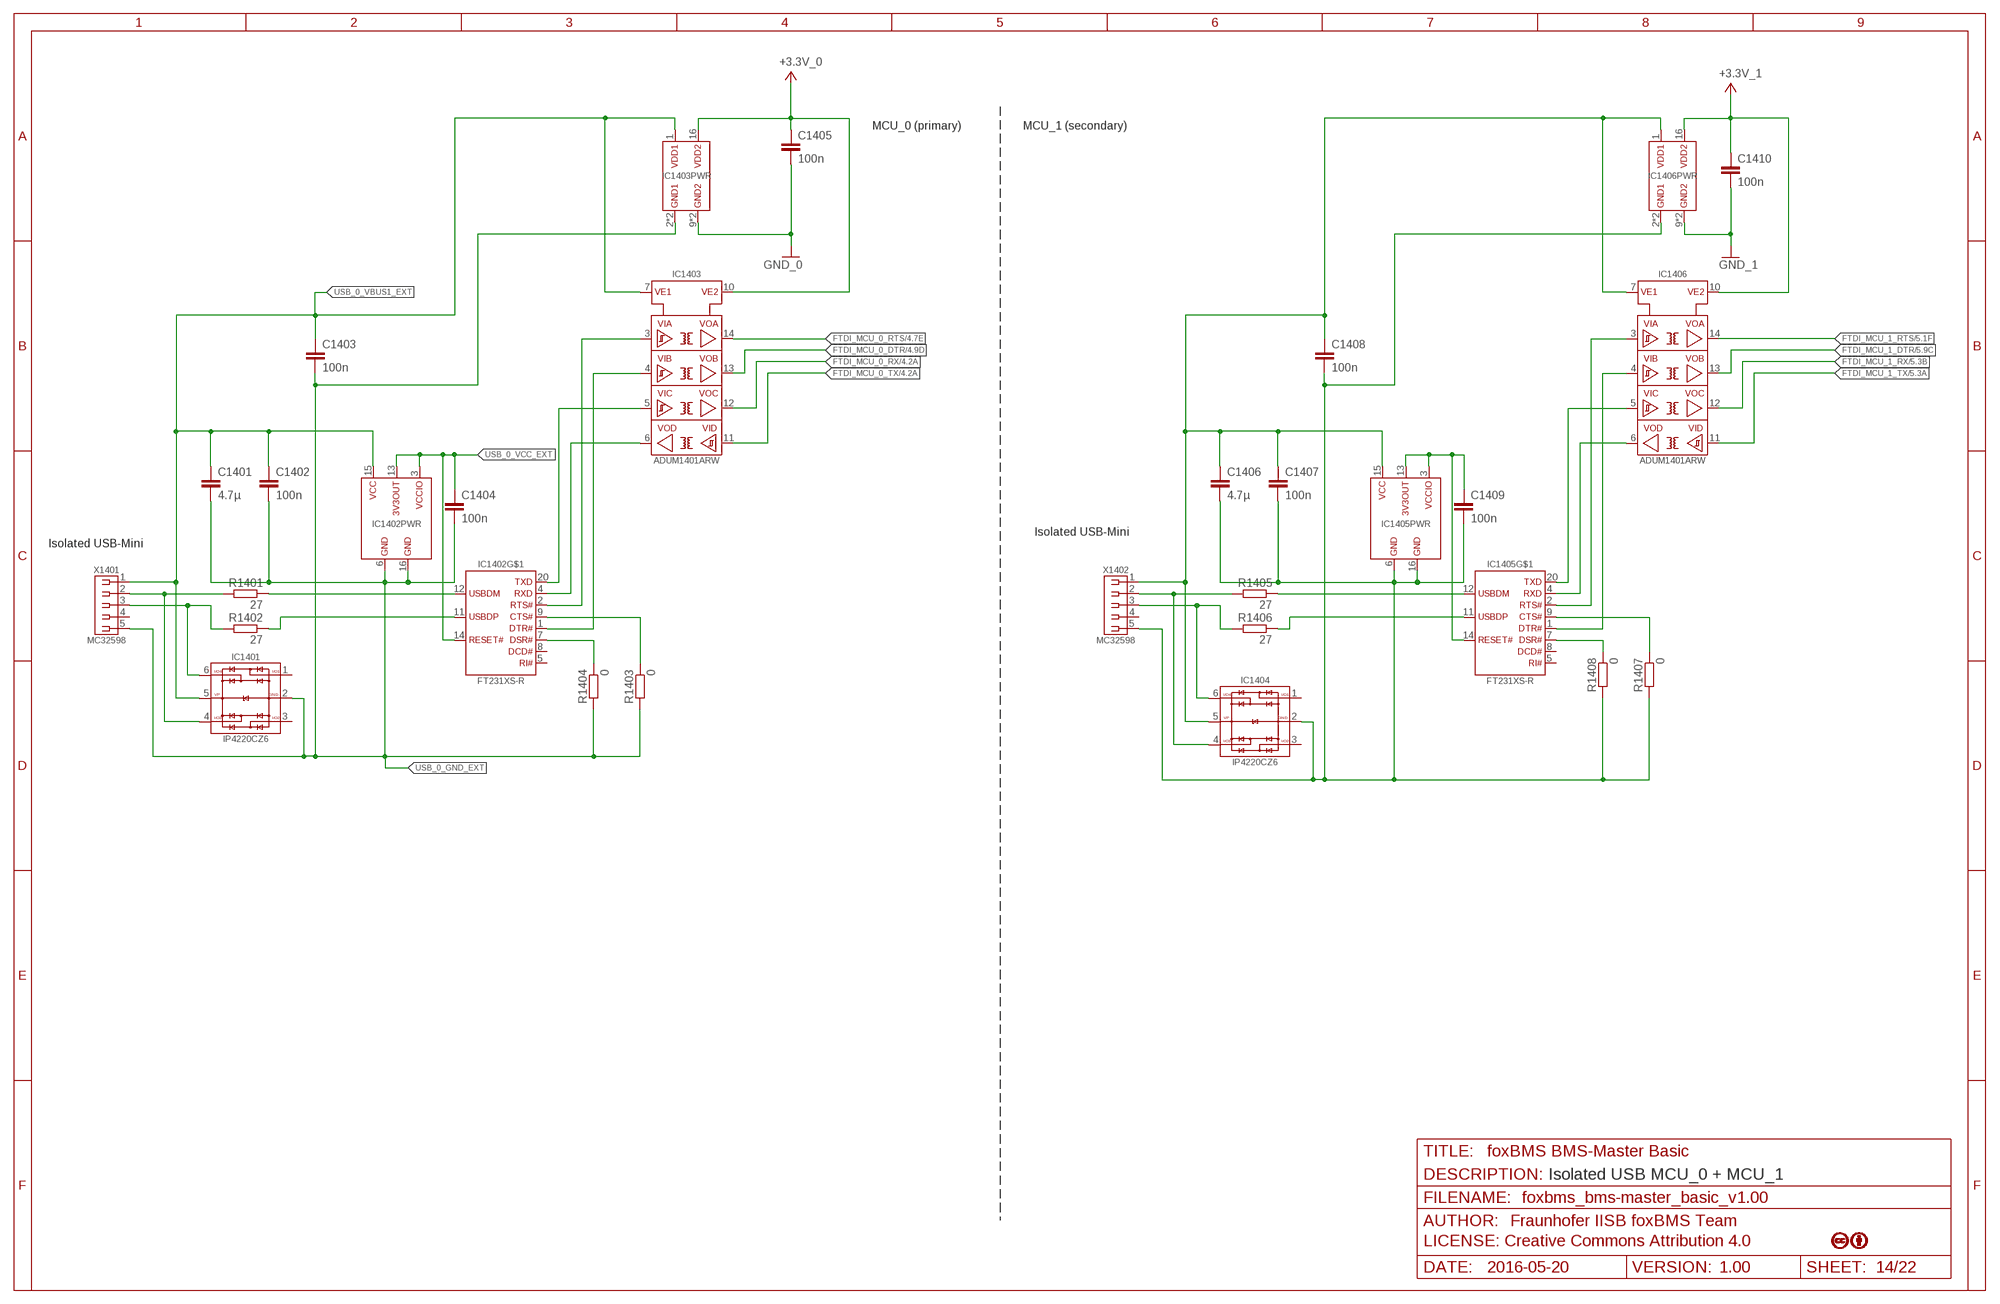
[diagram p13: schematic, sheet 14]

### Parts
C1401  4.7µ  C-EUC0603  [C0603]
C1402  100n  C-EUC0603  [C0603]
C1403  100n  C-EUC0603  [C0603]
C1404  100n  C-EUC0603  [C0603]
C1405  100n  C-EUC0603  [C0603]
C1406  4.7µ  C-EUC0603  [C0603]
C1407  100n  C-EUC0603  [C0603]
C1408  100n  C-EUC0603  [C0603]
C1409  100n  C-EUC0603  [C0603]
C1410  100n  C-EUC0603  [C0603]
IC1401  IP4220CZ6  [D_SMD_TSOP6_(SOT457/SC-74)_R_NXP_REV01]
IC1402  FT231XS-R  [IC_SMD_SSOP-20_R_FTDI_REV01]
IC1403  ADUM1401ARW  [IC_SMD_SOIC-16_(JEDEC_MS-013-AA)_R_ANALOG_REV01]
IC1404  IP4220CZ6  [D_SMD_TSOP6_(SOT457/SC-74)_R_NXP_REV01]
IC1405  FT231XS-R  [IC_SMD_SSOP-20_R_FTDI_REV01]
IC1406  ADUM1401ARW  [IC_SMD_SOIC-16_(JEDEC_MS-013-AA)_R_ANALOG_REV01]
R1401  27  R_MET_E96_0603  [0603]
R1402  27  R_MET_E96_0603  [0603]
R1403  0  R_MET_E96_0603  [0603]
R1404  0  R_MET_E96_0603  [0603]
R1405  27  R_MET_E96_0603  [0603]
R1406  27  R_MET_E96_0603  [0603]
R1407  0  R_MET_E96_0603  [0603]
R1408  0  R_MET_E96_0603  [0603]
X1401  MINI-USB-2.0  [X_SMD_MINI-USB-2.0-TYPAB_R_MULTICOMP_REV01]
X1402  MINI-USB-2.0  [X_SMD_MINI-USB-2.0-TYPAB_R_MULTICOMP_REV01]

### Nets
+3.3V_0: C1405.1 IC1403.10(VE2) IC1403.16(VDD2) ; also sheet 2,4,6,7,8,9,10,11,15,16,18,21,22
+3.3V_1: C1410.1 IC1406.10(VE2) IC1406.16(VDD2) ; also sheet 3,5,6,9,16
DM [USB]: IC1401.4(I/O3) R1401.2 X1401.2
DM1 [USB]: IC1404.4(I/O3) R1405.2 X1402.2
DP [USB]: IC1401.6(I/O4) R1402.2 X1401.3
DP1 [USB]: IC1404.6(I/O4) R1406.2 X1402.3
FTDI_MCU_0_DTR: IC1403.13(VOB) ; also sheet 4
FTDI_MCU_0_RTS: IC1403.14(VOA) ; also sheet 4
FTDI_MCU_0_RX: IC1403.12(VOC) ; also sheet 4
FTDI_MCU_0_TX: IC1403.11(VID) ; also sheet 4
FTDI_MCU_1_DTR: IC1406.13(VOB) ; also sheet 5
FTDI_MCU_1_RTS: IC1406.14(VOA) ; also sheet 5
FTDI_MCU_1_RX: IC1406.12(VOC) ; also sheet 5
FTDI_MCU_1_TX: IC1406.11(VID) ; also sheet 5
GND_0: C1405.2 IC1403.9(GND2) IC1403.15(GND2) ; also sheet 2,4,6,7,8,9,10,11,15,16,18,21,22
GND_1: C1410.2 IC1406.9(GND2) IC1406.15(GND2) ; also sheet 3,5,6,9,16
N$1: IC1402.11(USBDP) R1402.1
N$2: IC1402.12(USBDM) R1401.1
N$3: IC1405.11(USBDP) R1406.1
N$4: IC1405.12(USBDM) R1405.1
N$7: IC1402.20(TXD) IC1403.5(VIC)
N$11: IC1405.20(TXD) IC1406.5(VIC)
N$12: IC1405.4(RXD) IC1406.6(VOD)
N$15: IC1405.2(RTS#) IC1406.3(VIA)
N$35: IC1405.1(DTR#) IC1406.4(VIB)
N$37: IC1402.4(RXD) IC1403.6(VOD)
N$60: IC1402.1(DTR#) IC1403.4(VIB)
N$61: C1409.1 IC1405.3(PWR:VCCIO) IC1405.13(PWR:3V3OUT) IC1405.14(RESET#)
N$62: IC1405.9(CTS#) R1407.1
N$63: IC1402.2(RTS#) IC1403.3(VIA)
N$70: IC1405.7(DSR#) R1408.1
N$92: IC1402.9(CTS#) R1403.1
N$93: IC1402.7(DSR#) R1404.1
USB_0_GND_EXT: C1401.2 C1402.2 C1403.2 C1404.2 IC1401.2(GND) IC1402.6(PWR:GND1) IC1402.16(PWR:GND2) IC1403.2(GND1) IC1403.8(GND1) R1403.2 R1404.2 X1401.5
USB_0_VBUS1_EXT: C1401.1 C1402.1 C1403.1 IC1401.5(VP) IC1402.15(PWR:VCC) IC1403.1(VDD1) IC1403.7(VE1) X1401.1
USB_0_VCC_EXT: C1404.1 IC1402.3(PWR:VCCIO) IC1402.13(PWR:3V3OUT) IC1402.14(RESET#)
USB_GND_0_EXT1: C1406.2 C1407.2 C1408.2 C1409.2 IC1404.2(GND) IC1405.6(PWR:GND1) IC1405.16(PWR:GND2) IC1406.2(GND1) IC1406.8(GND1) R1407.2 R1408.2 X1402.5
USB_VBUS1_0_EXT1: C1406.1 C1407.1 C1408.1 IC1404.5(VP) IC1405.15(PWR:VCC) IC1406.1(VDD1) IC1406.7(VE1) X1402.1
Unconnected: IC1401.1(I/O1) IC1401.3(I/O2) IC1402.5(RI#) IC1402.8(DCD#) IC1402.10(CBUS2) IC1402.17(CBUS1) IC1402.18(CBUS0) IC1402.19(CBUS3) IC1404.1(I/O1) IC1404.3(I/O2) IC1405.5(RI#) IC1405.8(DCD#) IC1405.10(CBUS2) IC1405.17(CBUS1) IC1405.18(CBUS0) IC1405.19(CBUS3) X1401.4 X1401.SH1(SH) X1401.SH2(SH) X1401.SH3(SH) X1401.SH4(SH) X1402.4 X1402.SH1(SH) X1402.SH2(SH) X1402.SH3(SH) X1402.SH4(SH)

### Notes on the sheet
- MCU_0 (primary) | MCU_1 (secondary)
- Isolated USB-Mini
- Isolated USB-Mini
- Isolated USB MCU_0 + MCU_1

## Sheet 15 of 22: EEPROM + SDCard
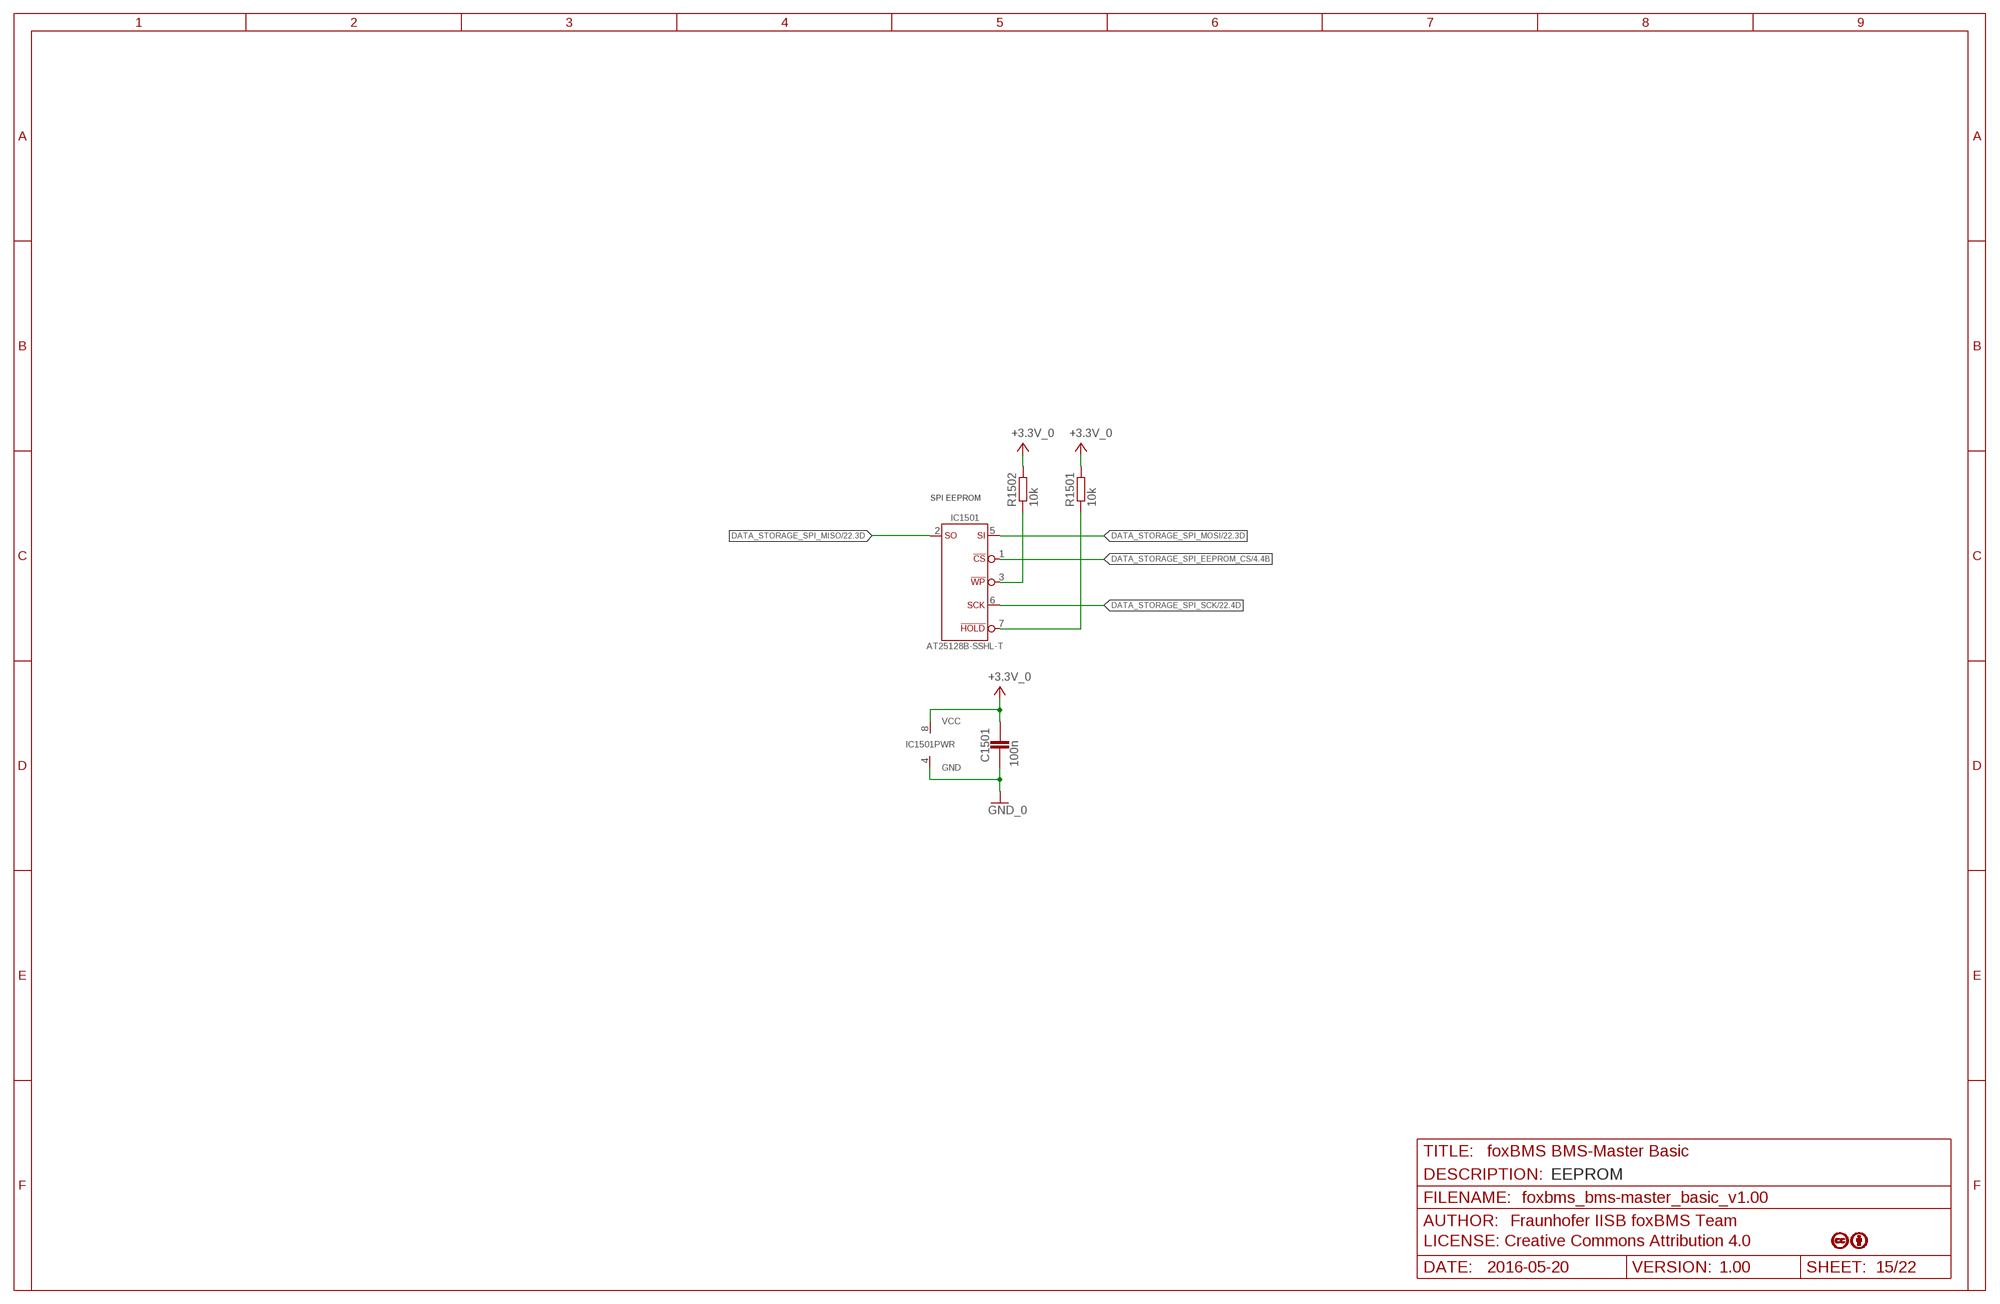
[diagram p14: schematic, sheet 15]

### Parts
C1501  100n  C_X7R_0603  [0603]
IC1501  AT25128B-SSHL-T  [IC_SMD_SOIC-8_R_ATMEL_REV01]
R1501  10k  R_MET_E96_0603  [0603]
R1502  10k  R_MET_E96_0603  [0603]

### Nets
+3.3V_0: C1501.2 IC1501.8(VCC) R1501.2 R1502.2 ; also sheet 2,4,6,7,8,9,10,11,14,16,18,21,22
DATA_STORAGE_SPI_EEPROM_CS: IC1501.1(!CS) ; also sheet 4
DATA_STORAGE_SPI_MISO [controller]: IC1501.2(SO) ; also sheet 4,22
DATA_STORAGE_SPI_MOSI [controller]: IC1501.5(SI) ; also sheet 4,22
DATA_STORAGE_SPI_SCK [controller]: IC1501.6(SCK) ; also sheet 4,22
GND_0: C1501.1 IC1501.4(GND) ; also sheet 2,4,6,7,8,9,10,11,14,16,18,21,22
N$256: IC1501.7(HOLD) R1501.1
N$257: IC1501.3(!WP) R1502.1

### Notes on the sheet
- SPI EEPROM
- EEPROM

## Sheet 16 of 22: BMS-Interface Interface
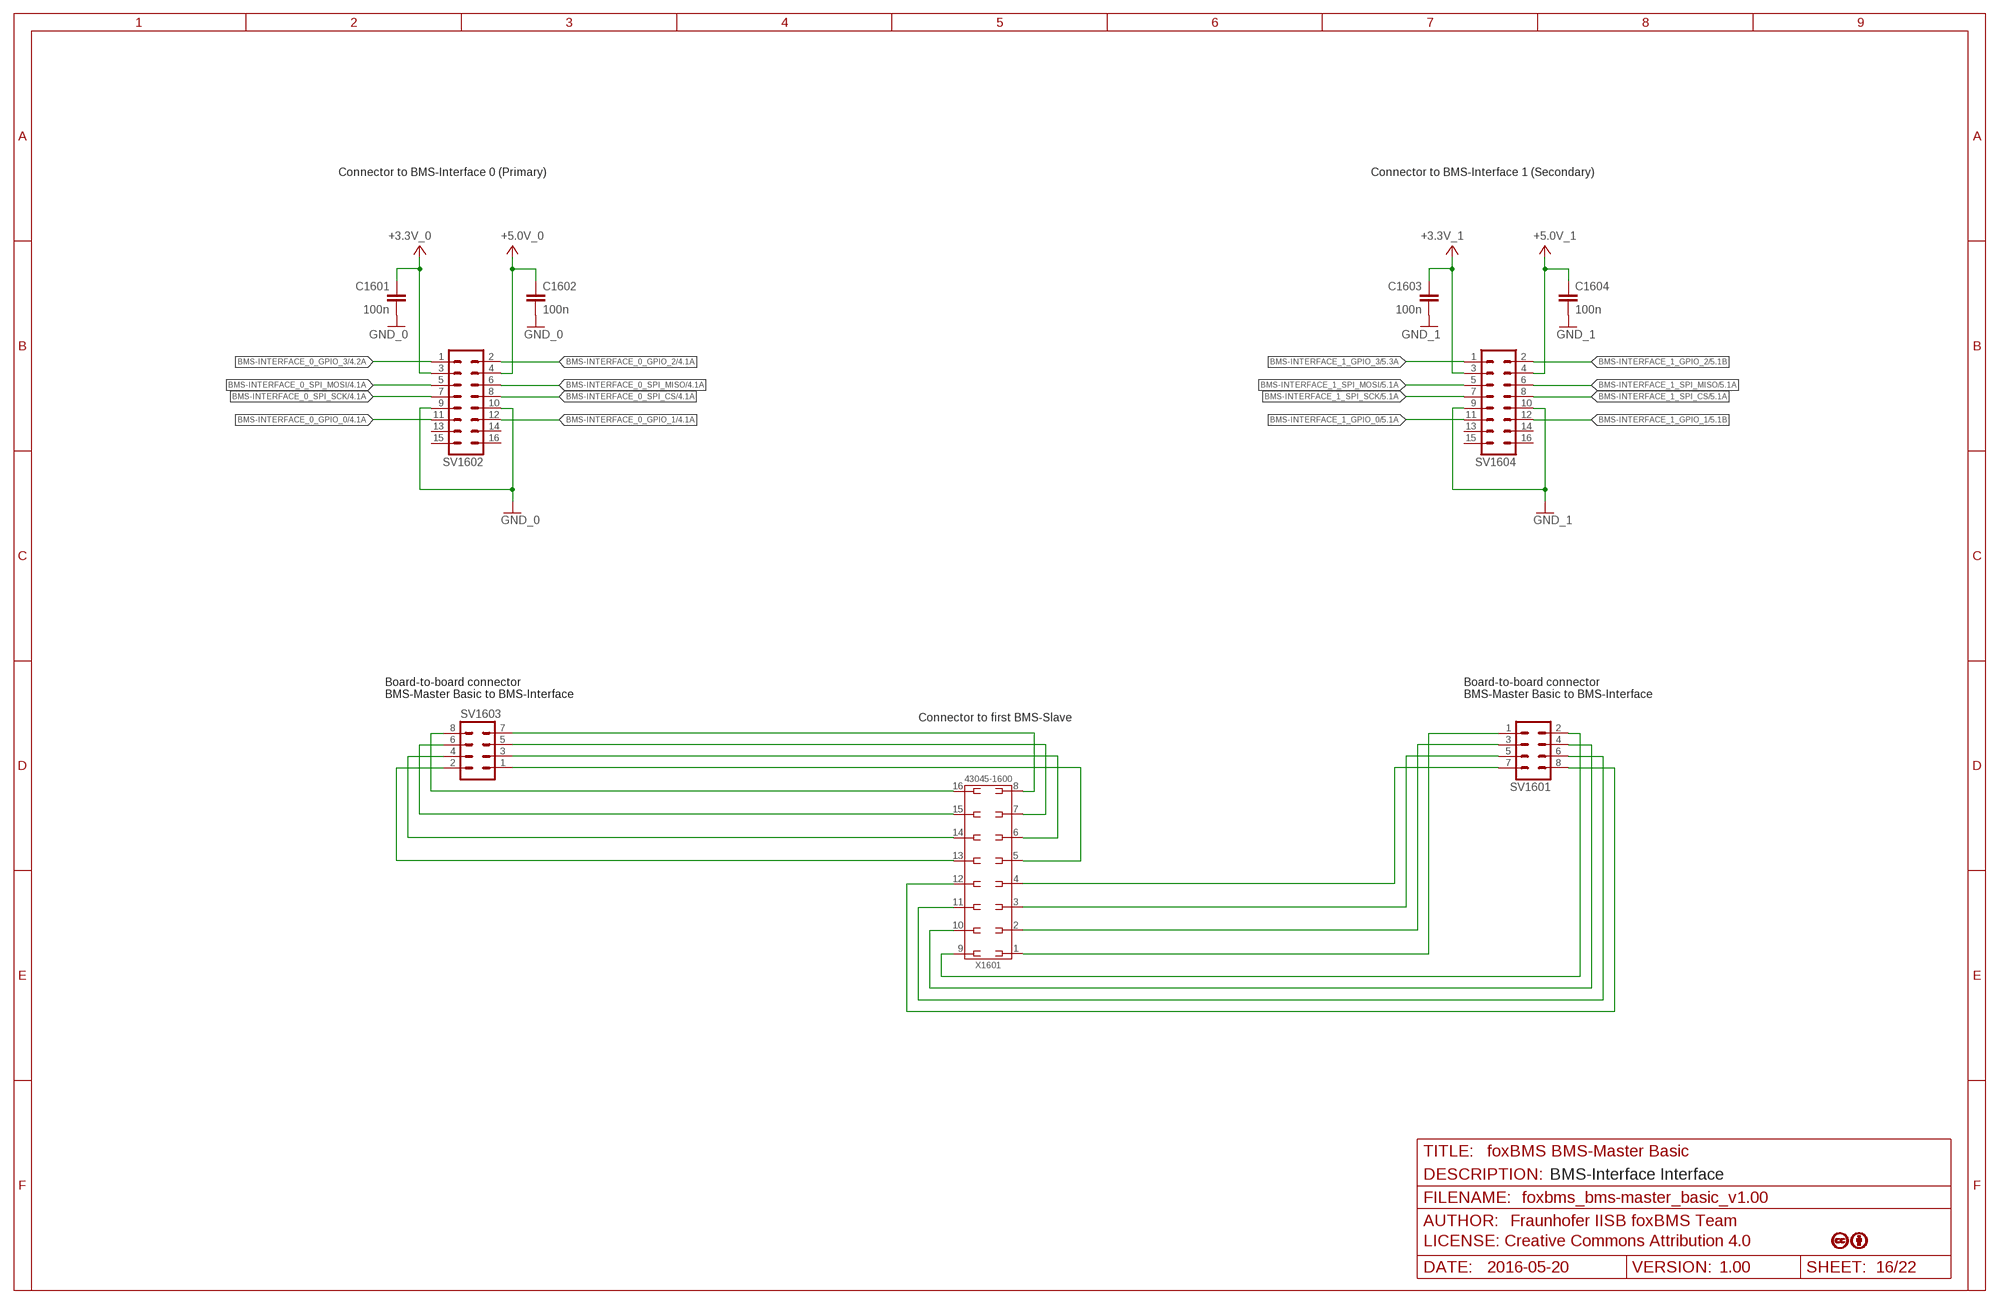
[diagram p15: schematic, sheet 16]

### Parts
C1601  100n  C-EUC0603  [C0603]
C1602  100n  C-EUC0603  [C0603]
C1603  100n  C-EUC0603  [C0603]
C1604  100n  C-EUC0603  [C0603]
SV1601  MA04-2  [MA04-2]
SV1602  MA08-2  [MA08-2]
SV1603  MA04-2  [MA04-2]
SV1604  MA08-2  [MA08-2]
X1601  43045-1600_MOLEX_16PIN  [X_TH_MOLEX_43045-1600_R_REV01]

### Nets
+3.3V_0: C1601.1 SV1602.3 ; also sheet 2,4,6,7,8,9,10,11,14,15,18,21,22
+3.3V_1: C1603.1 SV1604.3 ; also sheet 3,5,6,9,14
+5.0V_0: C1602.1 SV1602.4 ; also sheet 2,21
+5.0V_1: C1604.1 SV1604.4 ; also sheet 3
BMS-INTERFACE_0_GPIO_0: SV1602.11 ; also sheet 4
BMS-INTERFACE_0_GPIO_1: SV1602.12 ; also sheet 4
BMS-INTERFACE_0_GPIO_2: SV1602.2 ; also sheet 4
BMS-INTERFACE_0_GPIO_3: SV1602.1 ; also sheet 4
BMS-INTERFACE_0_SPI_CS: SV1602.8 ; also sheet 4
BMS-INTERFACE_0_SPI_MISO: SV1602.6 ; also sheet 4
BMS-INTERFACE_0_SPI_MOSI: SV1602.5 ; also sheet 4
BMS-INTERFACE_0_SPI_SCK: SV1602.7 ; also sheet 4
BMS-INTERFACE_1_GPIO_0: SV1604.11 ; also sheet 5
BMS-INTERFACE_1_GPIO_1: SV1604.12 ; also sheet 5
BMS-INTERFACE_1_GPIO_2: SV1604.2 ; also sheet 5
BMS-INTERFACE_1_GPIO_3: SV1604.1 ; also sheet 5
BMS-INTERFACE_1_SPI_CS: SV1604.8 ; also sheet 5
BMS-INTERFACE_1_SPI_MISO: SV1604.6 ; also sheet 5
BMS-INTERFACE_1_SPI_MOSI: SV1604.5 ; also sheet 5
BMS-INTERFACE_1_SPI_SCK: SV1604.7 ; also sheet 5
GND_0: C1601.2 C1602.2 SV1602.9 SV1602.10 ; also sheet 2,4,6,7,8,9,10,11,14,15,18,21,22
GND_1: C1603.2 C1604.2 SV1604.9 SV1604.10 ; also sheet 3,5,6,9,14
N$13: SV1601.1 X1601.1
N$39: SV1601.2 X1601.9
N$40: SV1601.3 X1601.2
N$41: SV1601.4 X1601.10
N$42: SV1601.5 X1601.3
N$43: SV1601.6 X1601.11
N$44: SV1601.7 X1601.4
N$56: SV1601.8 X1601.12
N$64: SV1603.1 X1601.5
N$67: SV1603.3 X1601.6
N$69: SV1603.5 X1601.7
N$71: SV1603.7 X1601.8
N$72: SV1603.2 X1601.13
N$73: SV1603.4 X1601.14
N$75: SV1603.6 X1601.15
N$76: SV1603.8 X1601.16
Unconnected: SV1602.13 SV1602.14 SV1602.15 SV1602.16 SV1604.13 SV1604.14 SV1604.15 SV1604.16

### Notes on the sheet
- Connector to BMS-Interface 0 (Primary) | Connector to BMS-Interface 1 (Secondary)
- Board-to-board connector
  BMS-Master Basic to BMS-Interface
- Board-to-board connector
  BMS-Master Basic to BMS-Interface
- Connector to first BMS-Slave
- BMS-Interface Interface

## Sheet 17 of 22: Analog Inputs
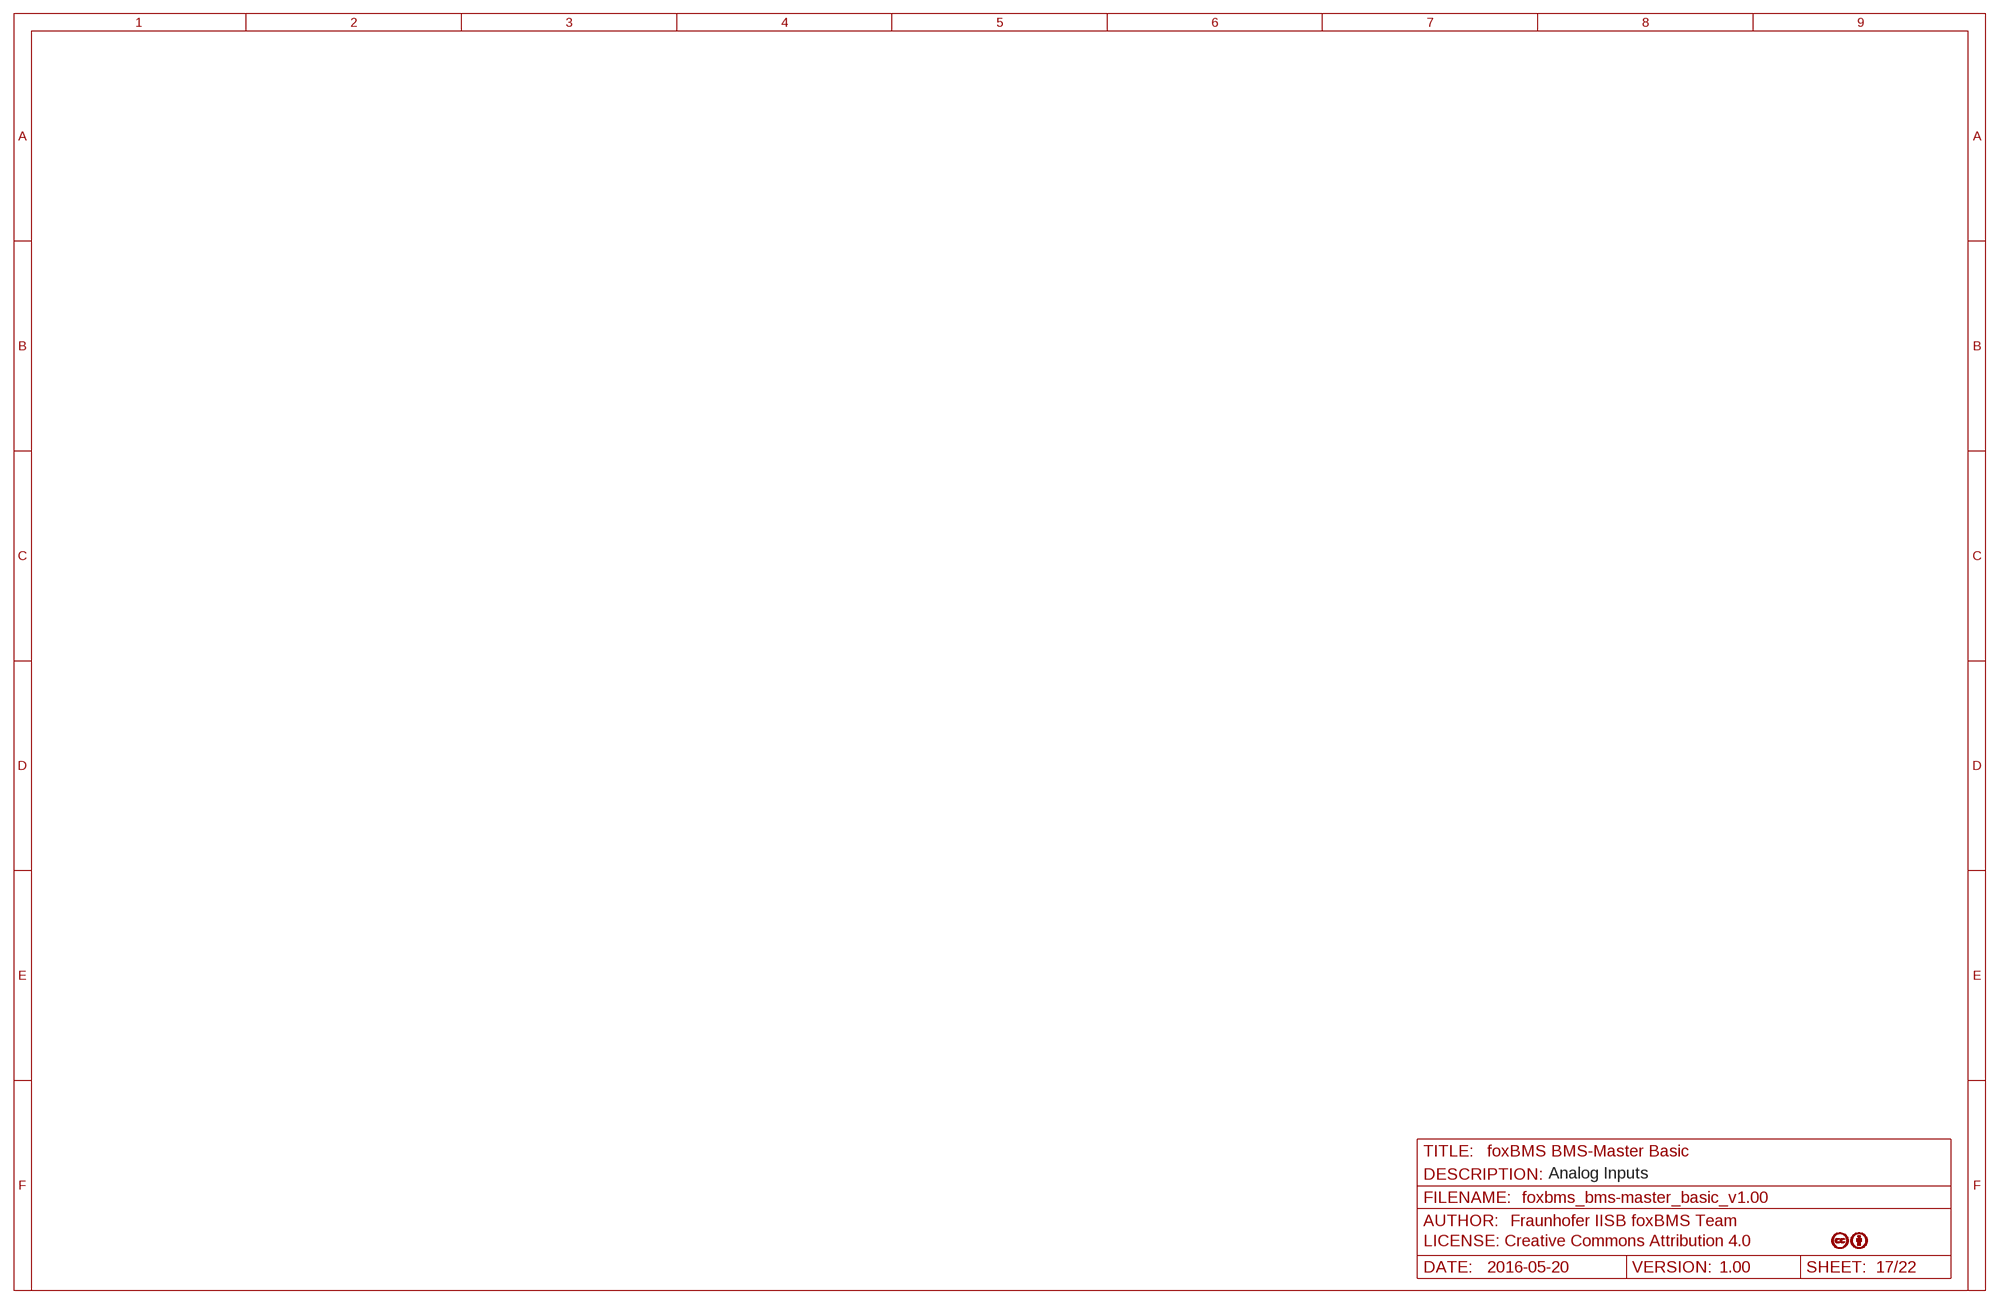
[diagram p16: schematic, sheet 17]

### Notes on the sheet
- Analog Inputs

## Sheet 18 of 22: SDRAM
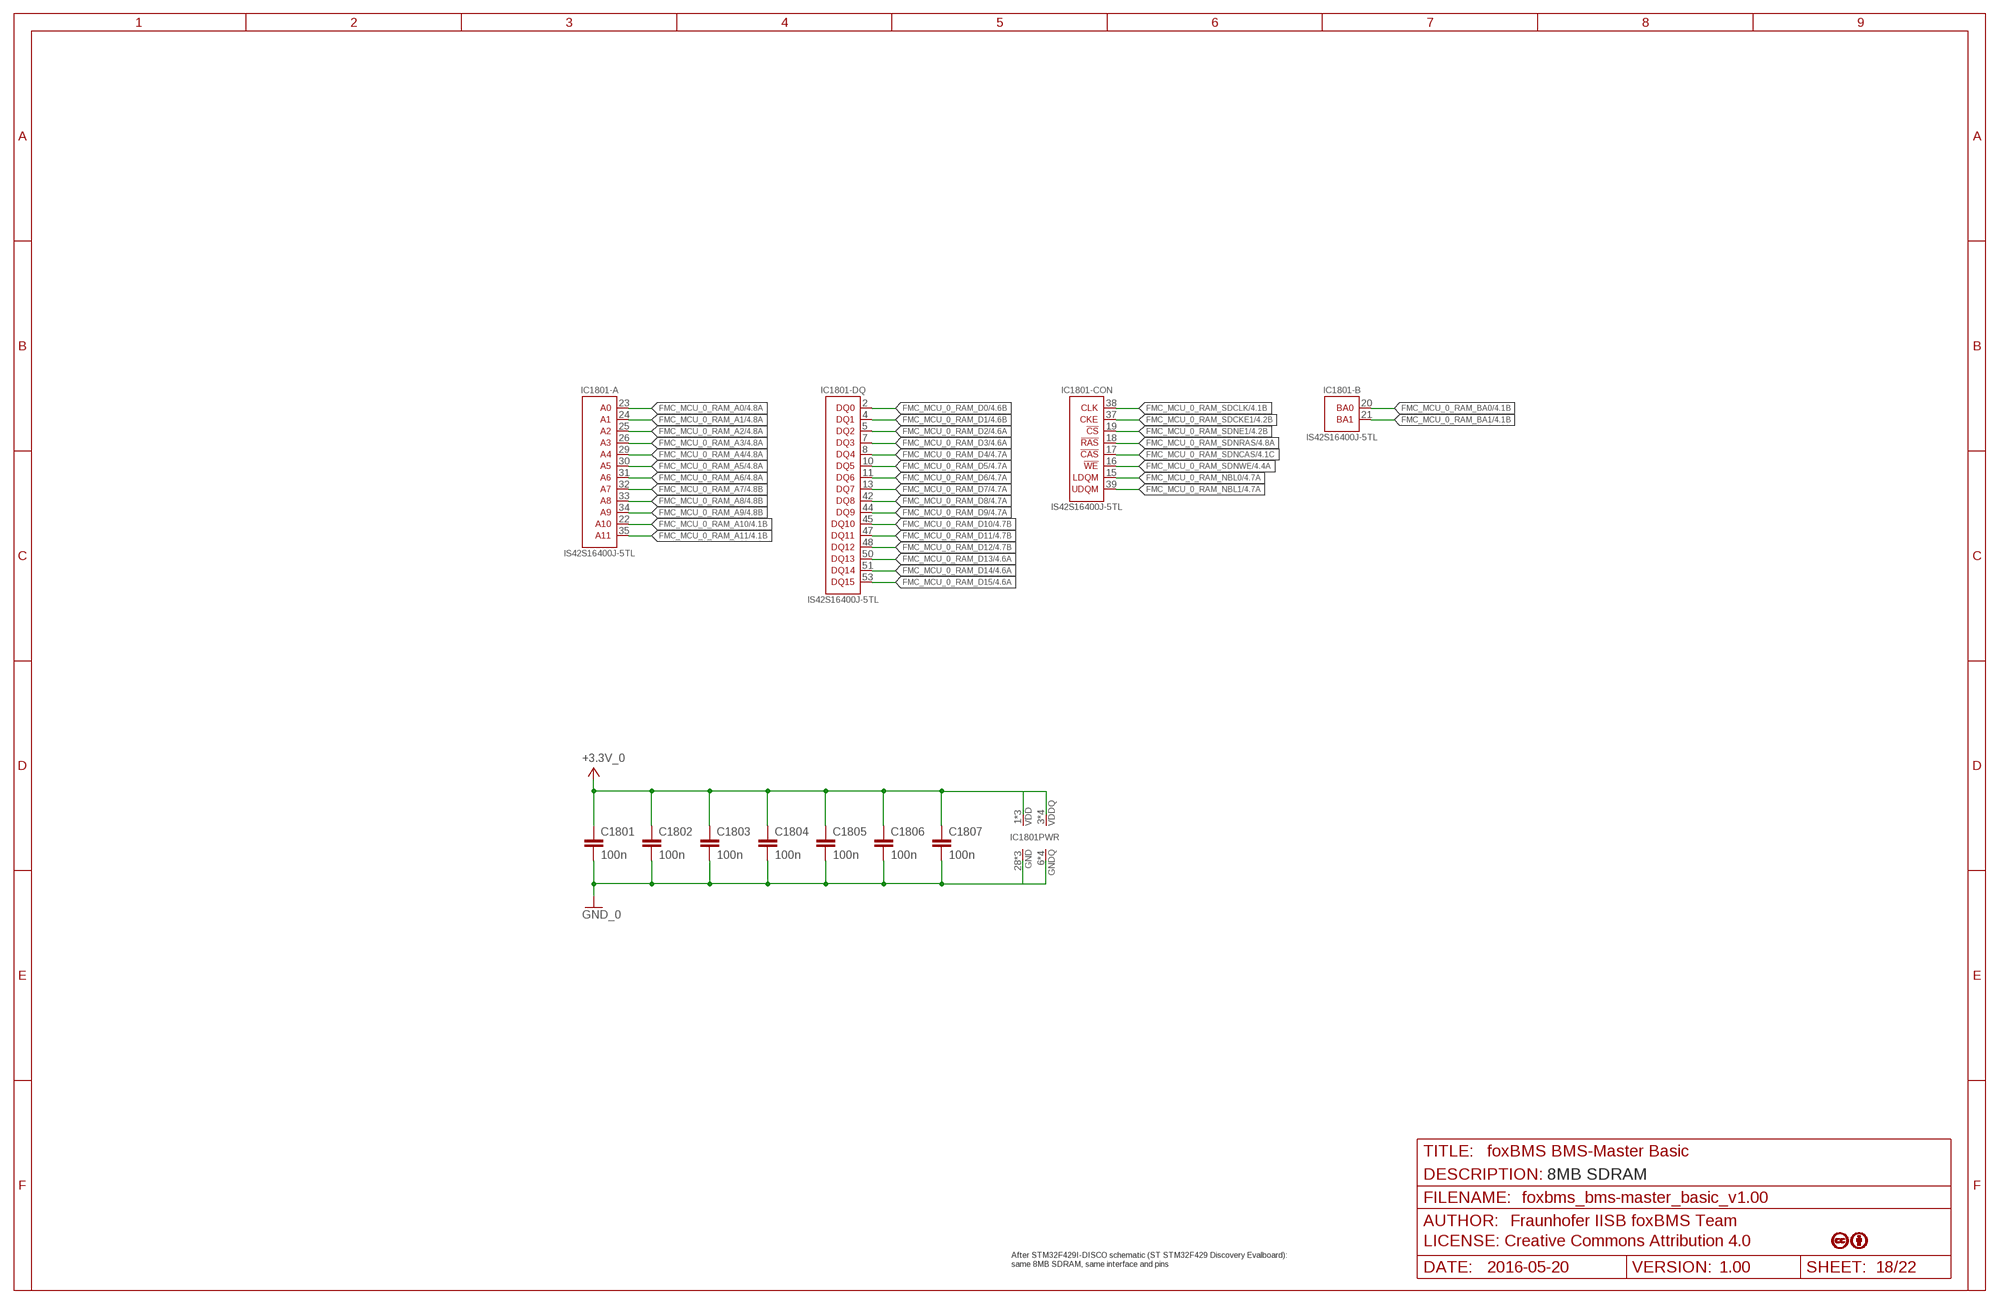
[diagram p17: schematic, sheet 18]

### Parts
C1801  100n  C-EUC0603  [C0603]
C1802  100n  C-EUC0603  [C0603]
C1803  100n  C-EUC0603  [C0603]
C1804  100n  C-EUC0603  [C0603]
C1805  100n  C-EUC0603  [C0603]
C1806  100n  C-EUC0603  [C0603]
C1807  100n  C-EUC0603  [C0603]
IC1801  IS42S16400J-5TL  [IC_SMD_TSOP-II_(54-PIN)_R_ISSI_REV01]

### Nets
+3.3V_0: C1801.1 C1802.1 C1803.1 C1804.1 C1805.1 C1806.1 C1807.1 IC1801.1(PWR:VDD) IC1801.3(PWR:VDDQ) IC1801.9(PWR:VDDQ) IC1801.14(PWR:VDD) IC1801.27(PWR:VDD) IC1801.43(PWR:VDDQ) IC1801.49(PWR:VDDQ) ; also sheet 2,4,6,7,8,9,10,11,14,15,16,21,22
FMC_MCU_0_RAM_A0: IC1801.23(-A:A0) ; also sheet 4
FMC_MCU_0_RAM_A1: IC1801.24(-A:A1) ; also sheet 4
FMC_MCU_0_RAM_A2: IC1801.25(-A:A2) ; also sheet 4
FMC_MCU_0_RAM_A3: IC1801.26(-A:A3) ; also sheet 4
FMC_MCU_0_RAM_A4: IC1801.29(-A:A4) ; also sheet 4
FMC_MCU_0_RAM_A5: IC1801.30(-A:A5) ; also sheet 4
FMC_MCU_0_RAM_A6: IC1801.31(-A:A6) ; also sheet 4
FMC_MCU_0_RAM_A7: IC1801.32(-A:A7) ; also sheet 4
FMC_MCU_0_RAM_A8: IC1801.33(-A:A8) ; also sheet 4
FMC_MCU_0_RAM_A9: IC1801.34(-A:A9) ; also sheet 4
FMC_MCU_0_RAM_A10: IC1801.22(-A:A10) ; also sheet 4
FMC_MCU_0_RAM_A11: IC1801.35(-A:A11) ; also sheet 4
FMC_MCU_0_RAM_BA0: IC1801.20(-B:BA0) ; also sheet 4
FMC_MCU_0_RAM_BA1: IC1801.21(-B:BA1) ; also sheet 4
FMC_MCU_0_RAM_D0: IC1801.2(-DQ:DQ0) ; also sheet 4
FMC_MCU_0_RAM_D1: IC1801.4(-DQ:DQ1) ; also sheet 4
FMC_MCU_0_RAM_D2: IC1801.5(-DQ:DQ2) ; also sheet 4
FMC_MCU_0_RAM_D3: IC1801.7(-DQ:DQ3) ; also sheet 4
FMC_MCU_0_RAM_D4: IC1801.8(-DQ:DQ4) ; also sheet 4
FMC_MCU_0_RAM_D5: IC1801.10(-DQ:DQ5) ; also sheet 4
FMC_MCU_0_RAM_D6: IC1801.11(-DQ:DQ6) ; also sheet 4
FMC_MCU_0_RAM_D7: IC1801.13(-DQ:DQ7) ; also sheet 4
FMC_MCU_0_RAM_D8: IC1801.42(-DQ:DQ8) ; also sheet 4
FMC_MCU_0_RAM_D9: IC1801.44(-DQ:DQ9) ; also sheet 4
FMC_MCU_0_RAM_D10: IC1801.45(-DQ:DQ10) ; also sheet 4
FMC_MCU_0_RAM_D11: IC1801.47(-DQ:DQ11) ; also sheet 4
FMC_MCU_0_RAM_D12: IC1801.48(-DQ:DQ12) ; also sheet 4
FMC_MCU_0_RAM_D13: IC1801.50(-DQ:DQ13) ; also sheet 4
FMC_MCU_0_RAM_D14: IC1801.51(-DQ:DQ14) ; also sheet 4
FMC_MCU_0_RAM_D15: IC1801.53(-DQ:DQ15) ; also sheet 4
FMC_MCU_0_RAM_NBL0: IC1801.15(-CON:LDQM) ; also sheet 4
FMC_MCU_0_RAM_NBL1: IC1801.39(-CON:UDQM) ; also sheet 4
FMC_MCU_0_RAM_SDCKE1: IC1801.37(-CON:CKE) ; also sheet 4
FMC_MCU_0_RAM_SDCLK: IC1801.38(-CON:CLK) ; also sheet 4
FMC_MCU_0_RAM_SDNCAS: IC1801.17(-CON:!CAS) ; also sheet 4
FMC_MCU_0_RAM_SDNE1: IC1801.19(-CON:!CS) ; also sheet 4
FMC_MCU_0_RAM_SDNRAS: IC1801.18(-CON:!RAS) ; also sheet 4
FMC_MCU_0_RAM_SDNWE: IC1801.16(-CON:!WE) ; also sheet 4
GND_0: C1801.2 C1802.2 C1803.2 C1804.2 C1805.2 C1806.2 C1807.2 IC1801.6(PWR:GNDQ) IC1801.12(PWR:GNDQ) IC1801.28(PWR:GND) IC1801.41(PWR:GND) IC1801.46(PWR:GNDQ) IC1801.52(PWR:GNDQ) IC1801.54(PWR:GND) ; also sheet 2,4,6,7,8,9,10,11,14,15,16,21,22
Unconnected: IC1801.36(NC:NC) IC1801.40(NC:NC)

### Notes on the sheet
- 8MB SDRAM
- After STM32F429I-DISCO schematic (ST STM32F429 Discovery Evalboard): 
  same 8MB SDRAM, same interface and pins

## Sheet 19 of 22: Isolated GPIO MCU_0 Primary
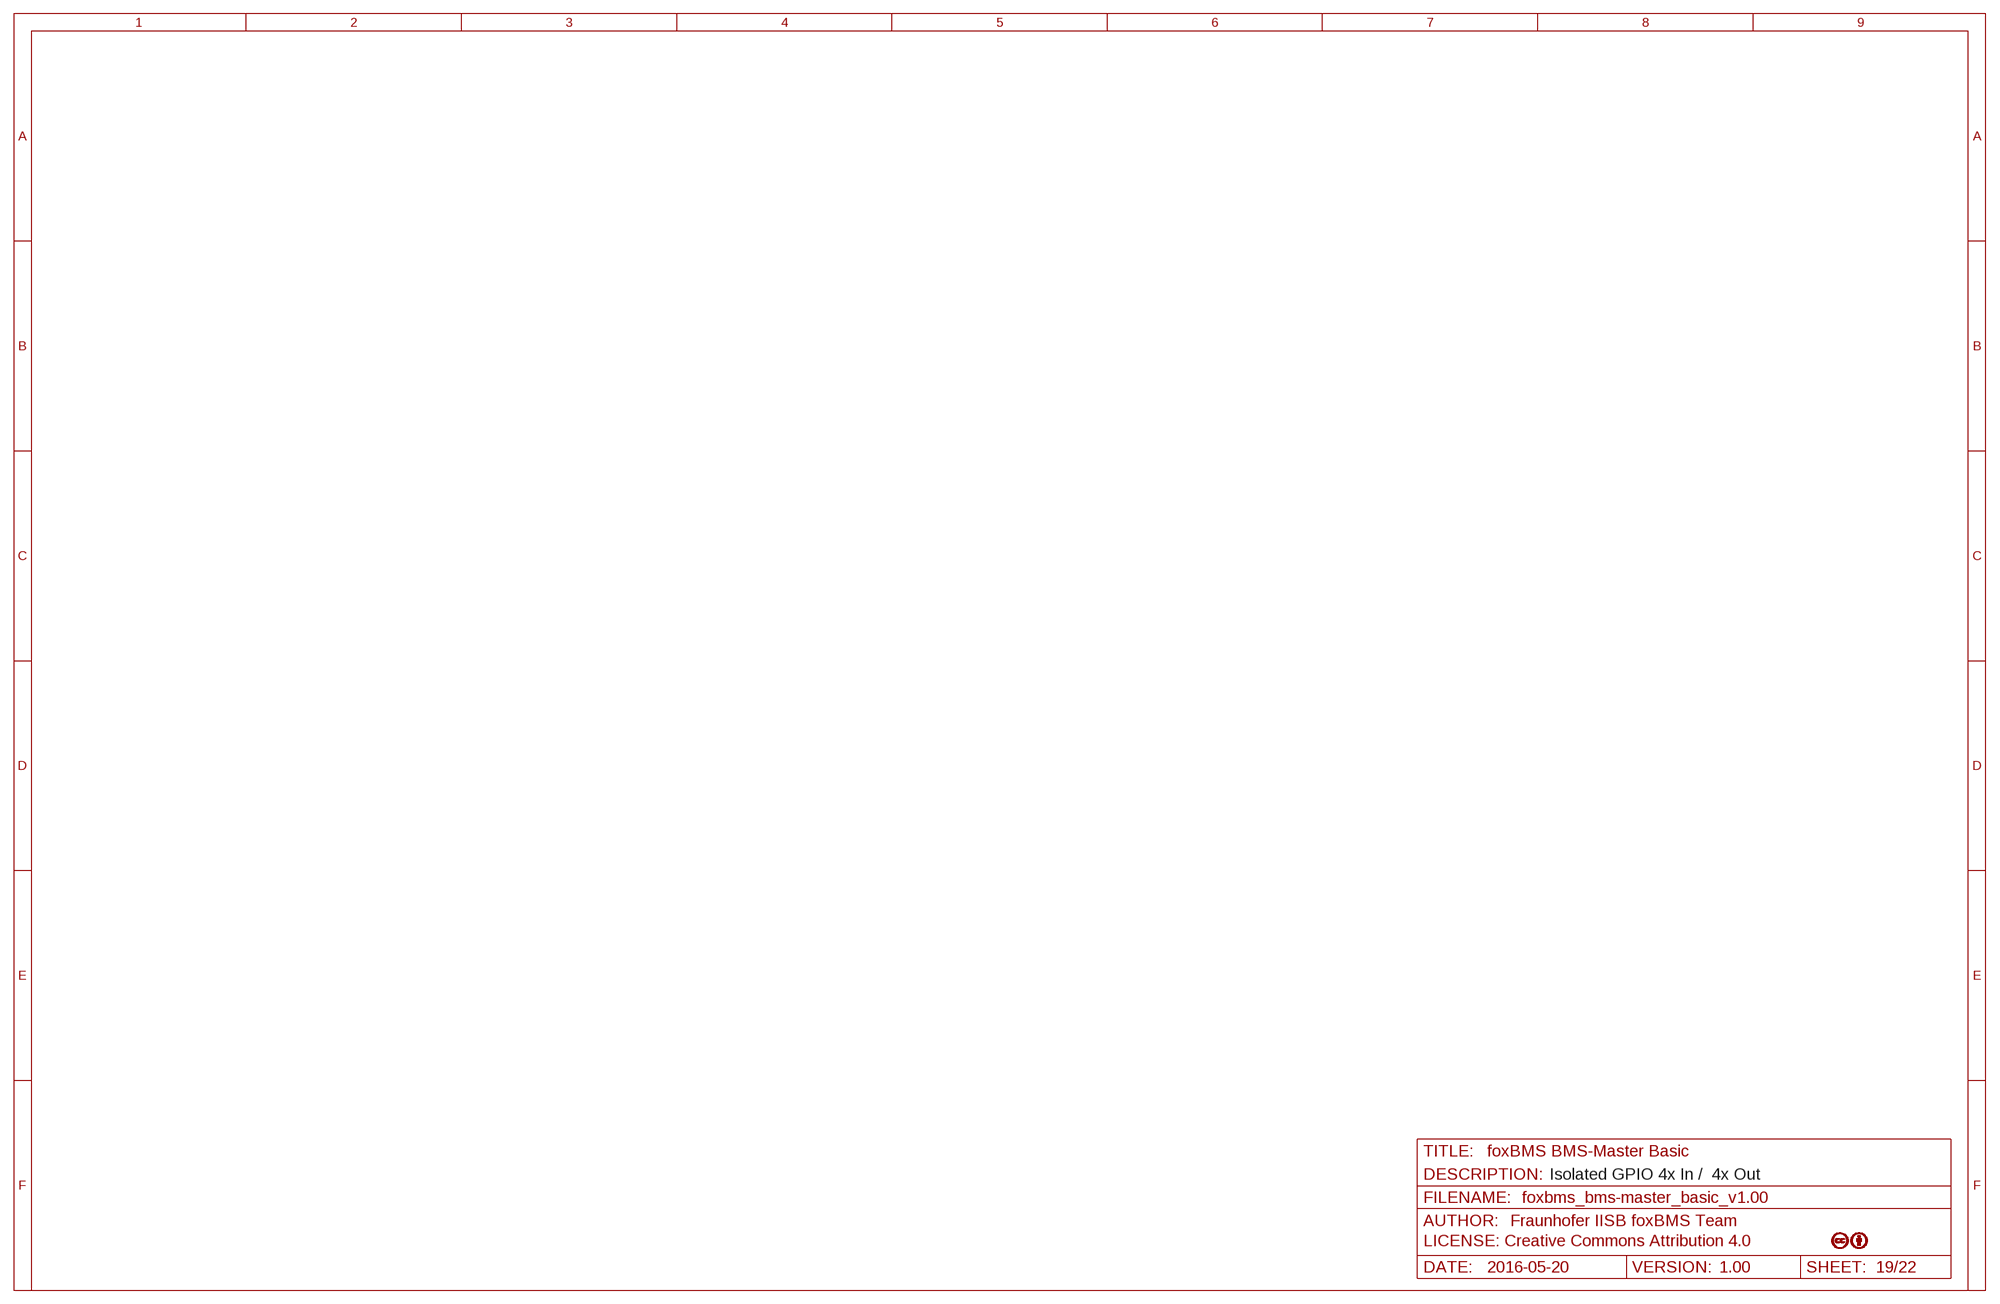
[diagram p18: schematic, sheet 19]

### Notes on the sheet
- Isolated GPIO 4x In /  4x Out

## Sheet 20 of 22: Isolated Normally Open Contacts
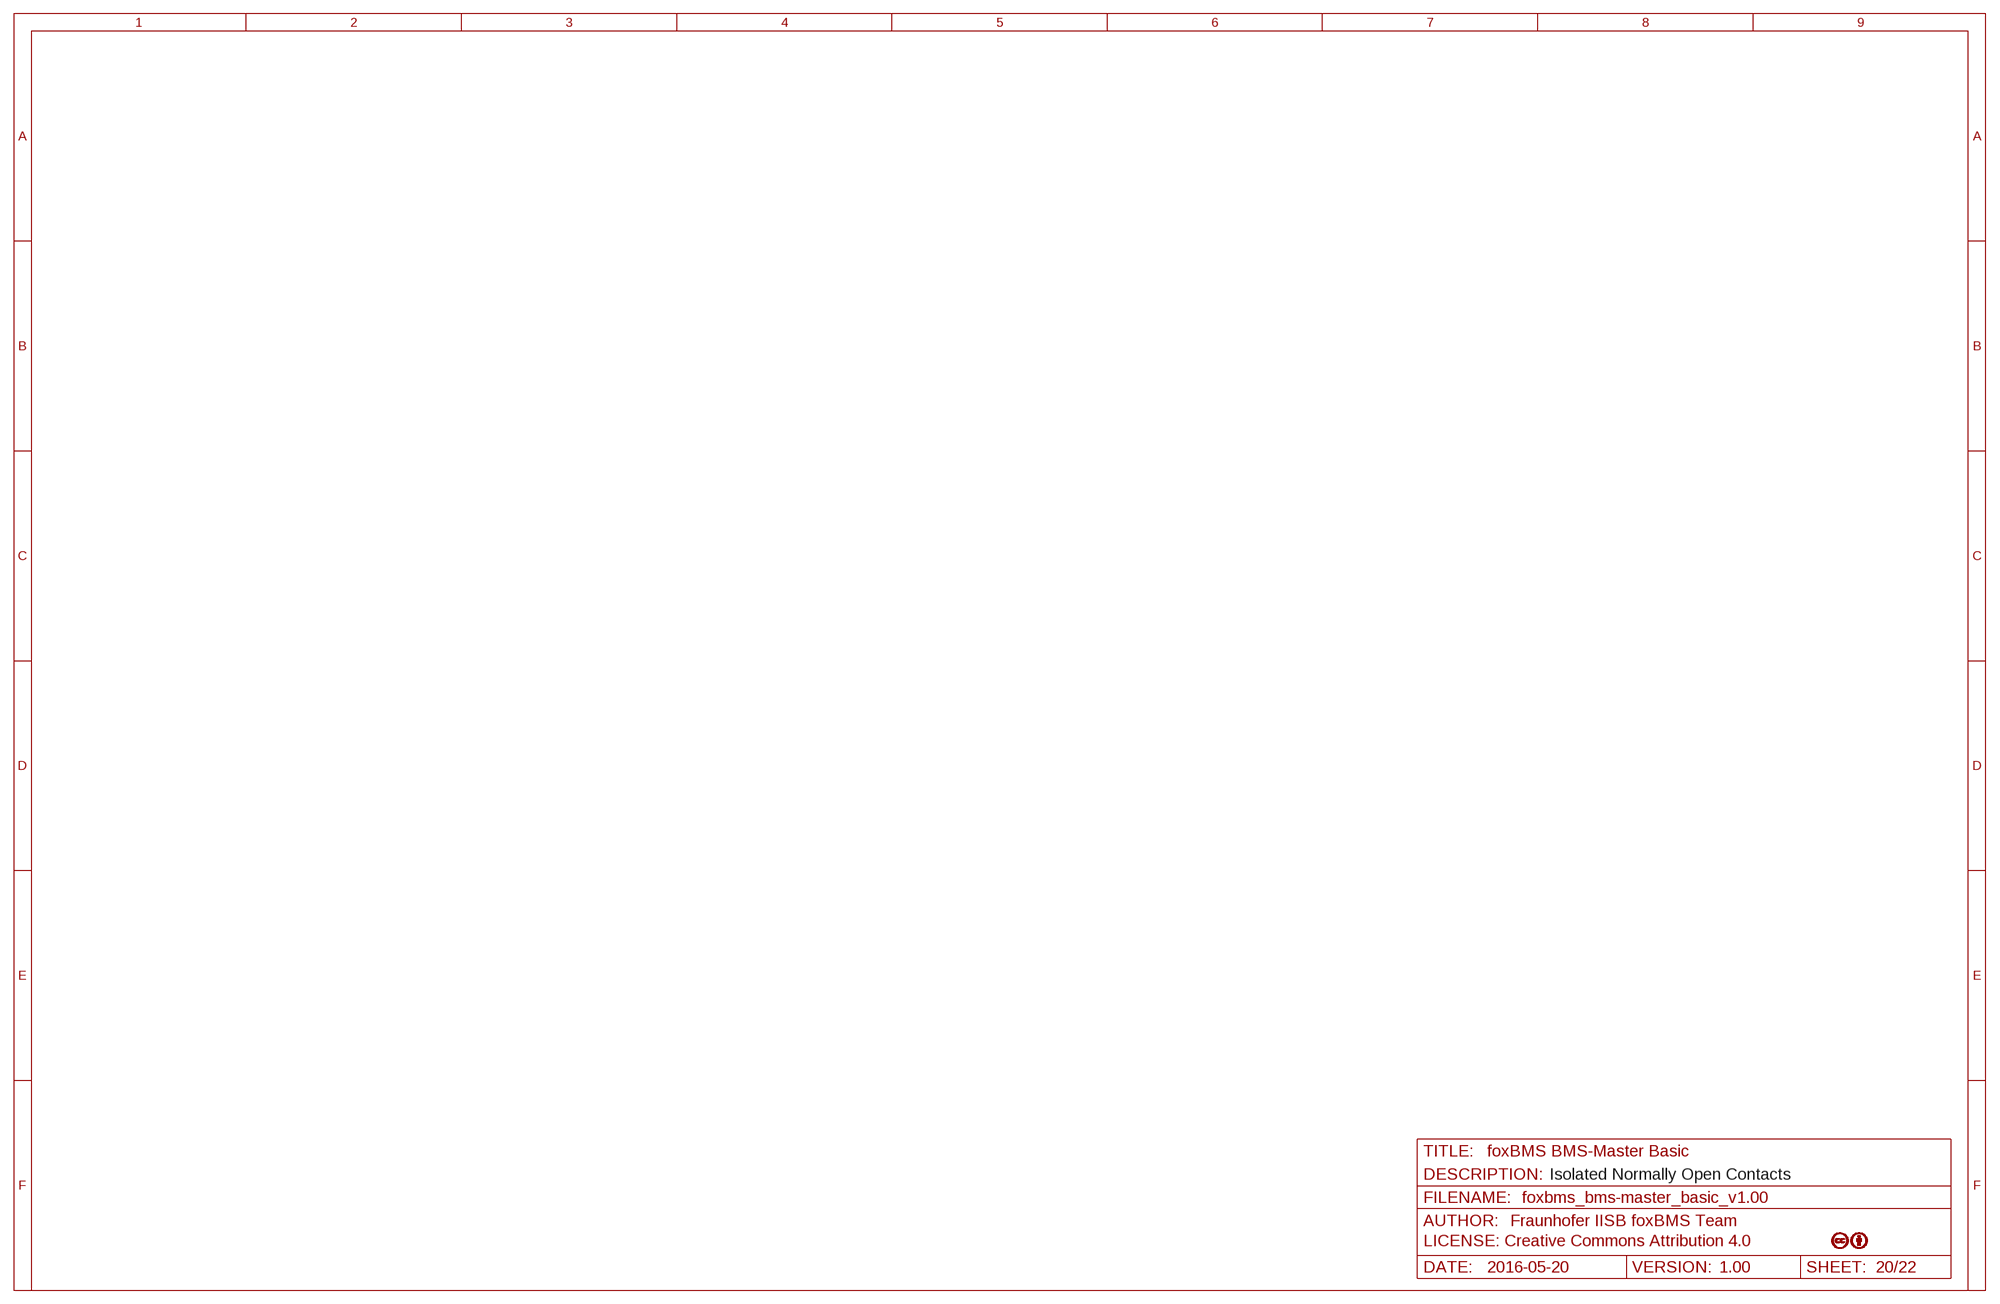
[diagram p19: schematic, sheet 20]

### Notes on the sheet
- Isolated Normally Open Contacts

## Sheet 21 of 22: FPGA Board Connector
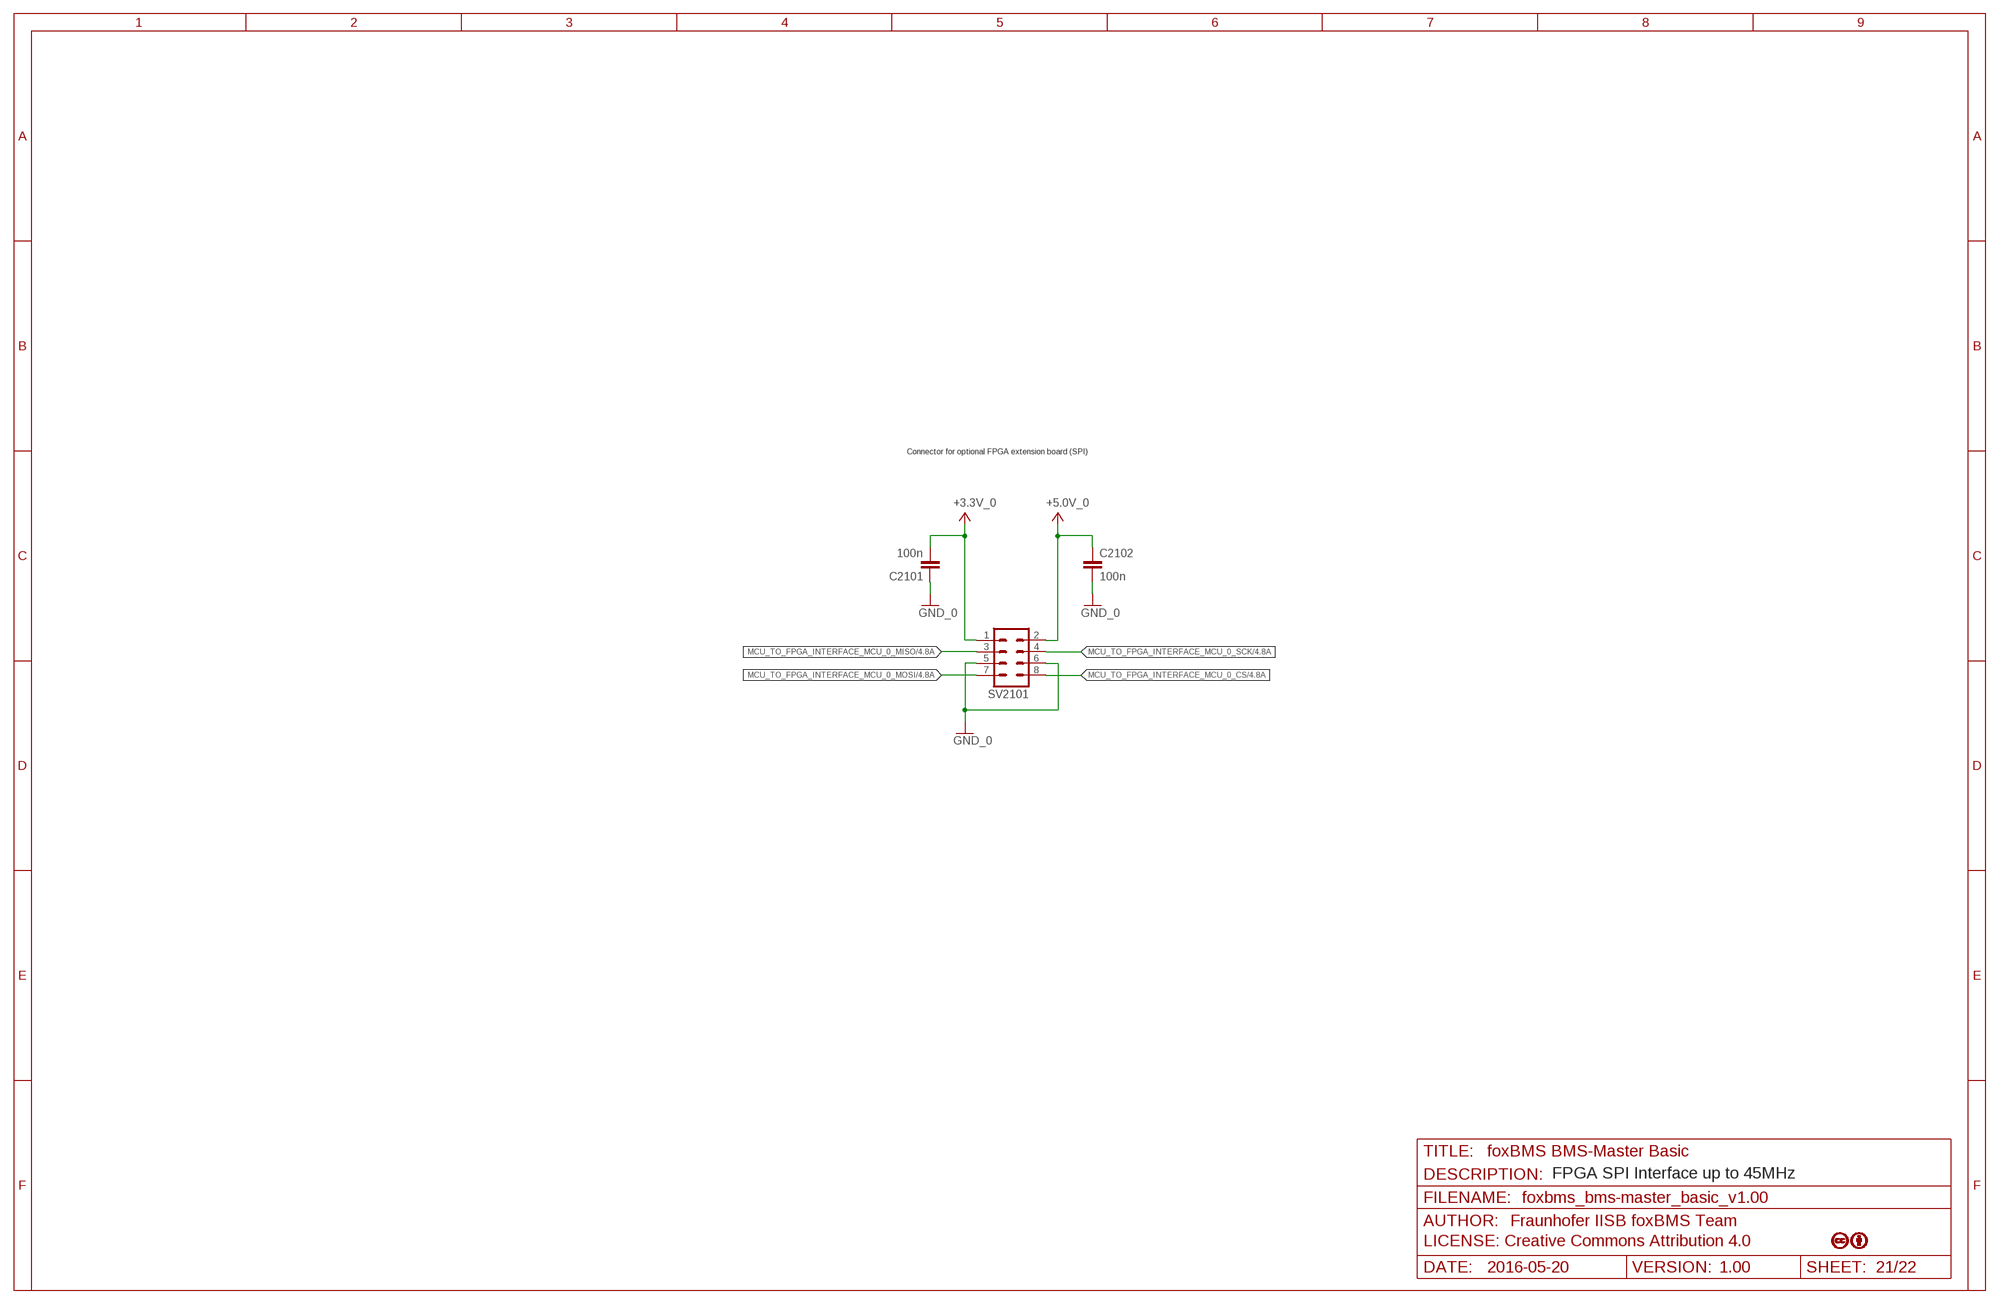
[diagram p20: schematic, sheet 21]

### Parts
C2101  100n  C-EUC0603  [C0603]
C2102  100n  C-EUC0603  [C0603]
SV2101  MA04-2  [MA04-2]

### Nets
+3.3V_0: C2101.2 SV2101.1 ; also sheet 2,4,6,7,8,9,10,11,14,15,16,18,22
+5.0V_0: C2102.1 SV2101.2 ; also sheet 2,16
GND_0: C2101.1 C2102.2 SV2101.5 SV2101.6 ; also sheet 2,4,6,7,8,9,10,11,14,15,16,18,22
MCU_TO_FPGA_INTERFACE_MCU_0_CS: SV2101.8 ; also sheet 4
MCU_TO_FPGA_INTERFACE_MCU_0_MISO: SV2101.3 ; also sheet 4
MCU_TO_FPGA_INTERFACE_MCU_0_MOSI: SV2101.7 ; also sheet 4
MCU_TO_FPGA_INTERFACE_MCU_0_SCK: SV2101.4 ; also sheet 4

### Notes on the sheet
- Connector for optional FPGA extension board (SPI)
- FPGA SPI Interface up to 45MHz